# EAGLE schematic Interface v1_6 (EAGLE 7.7.0), part 1 of 2

## Sheet 1 of 14: Connectors
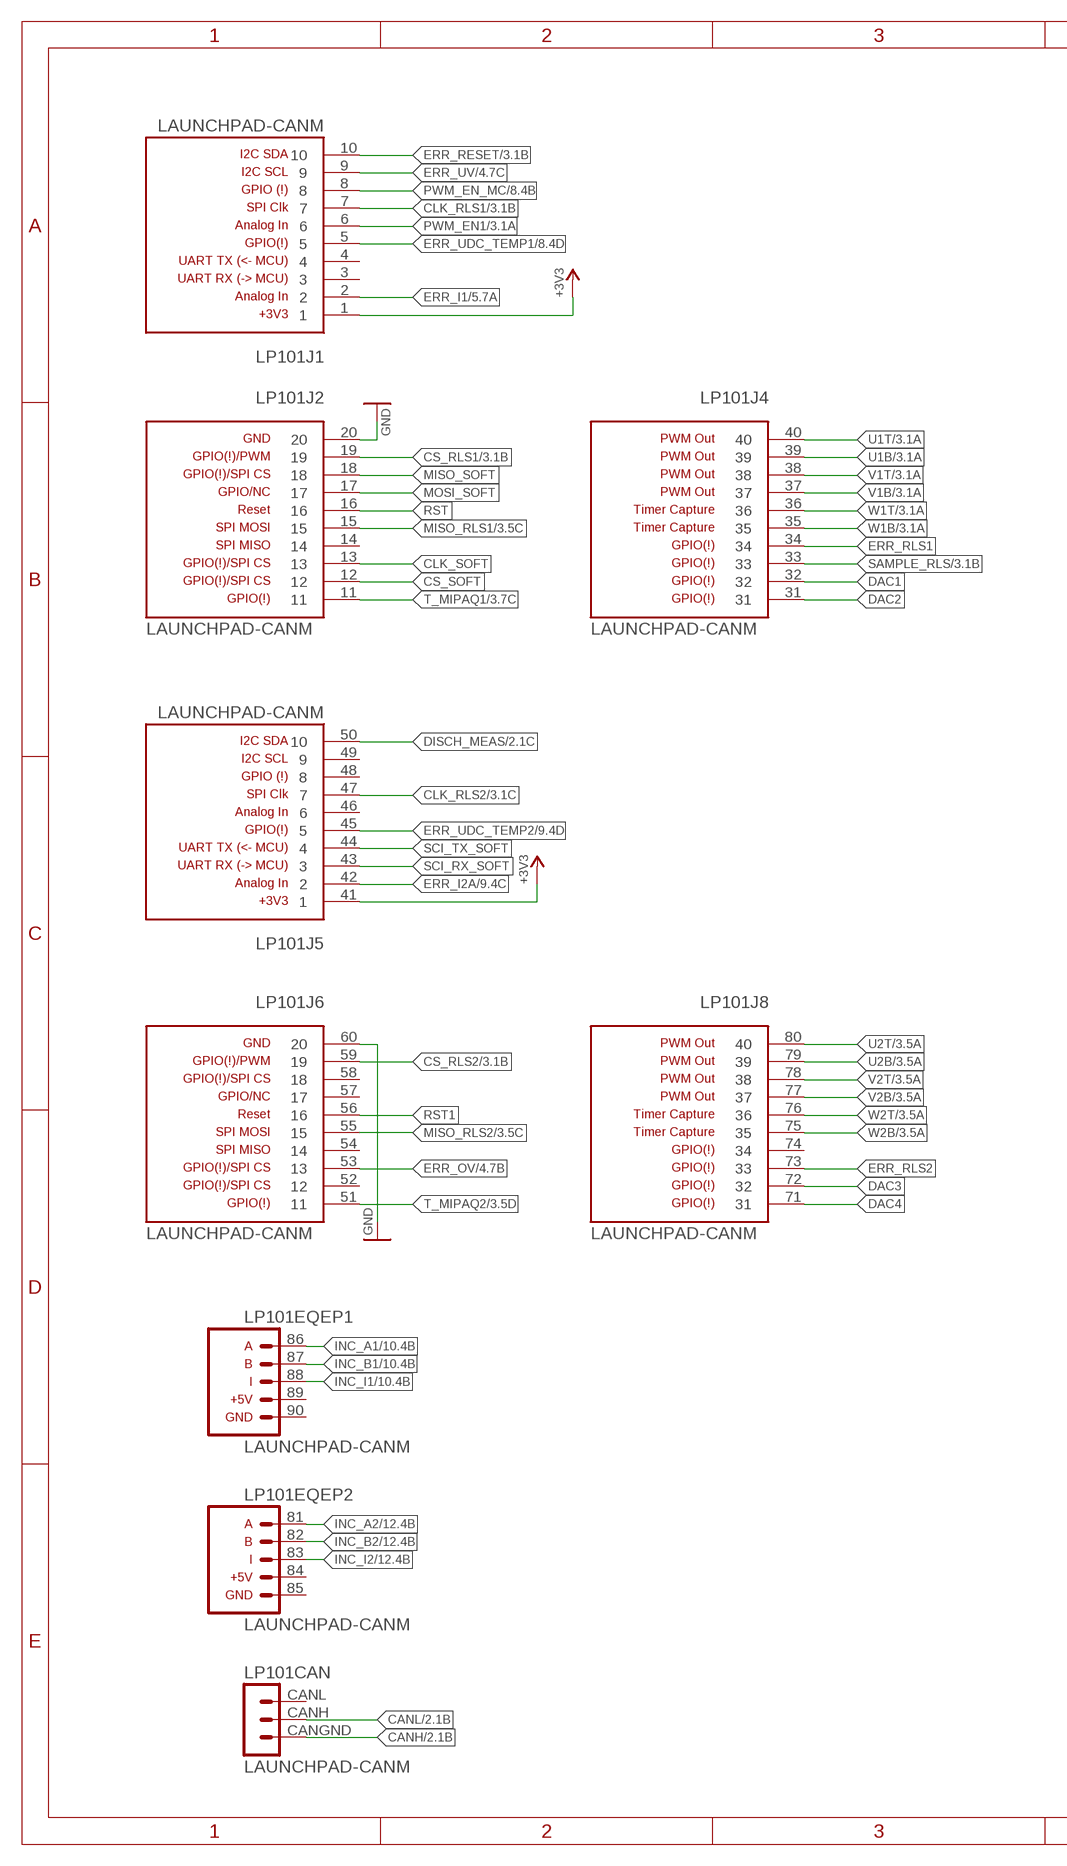
[diagram p0: schematic, sheet 1, part 1 of 2]
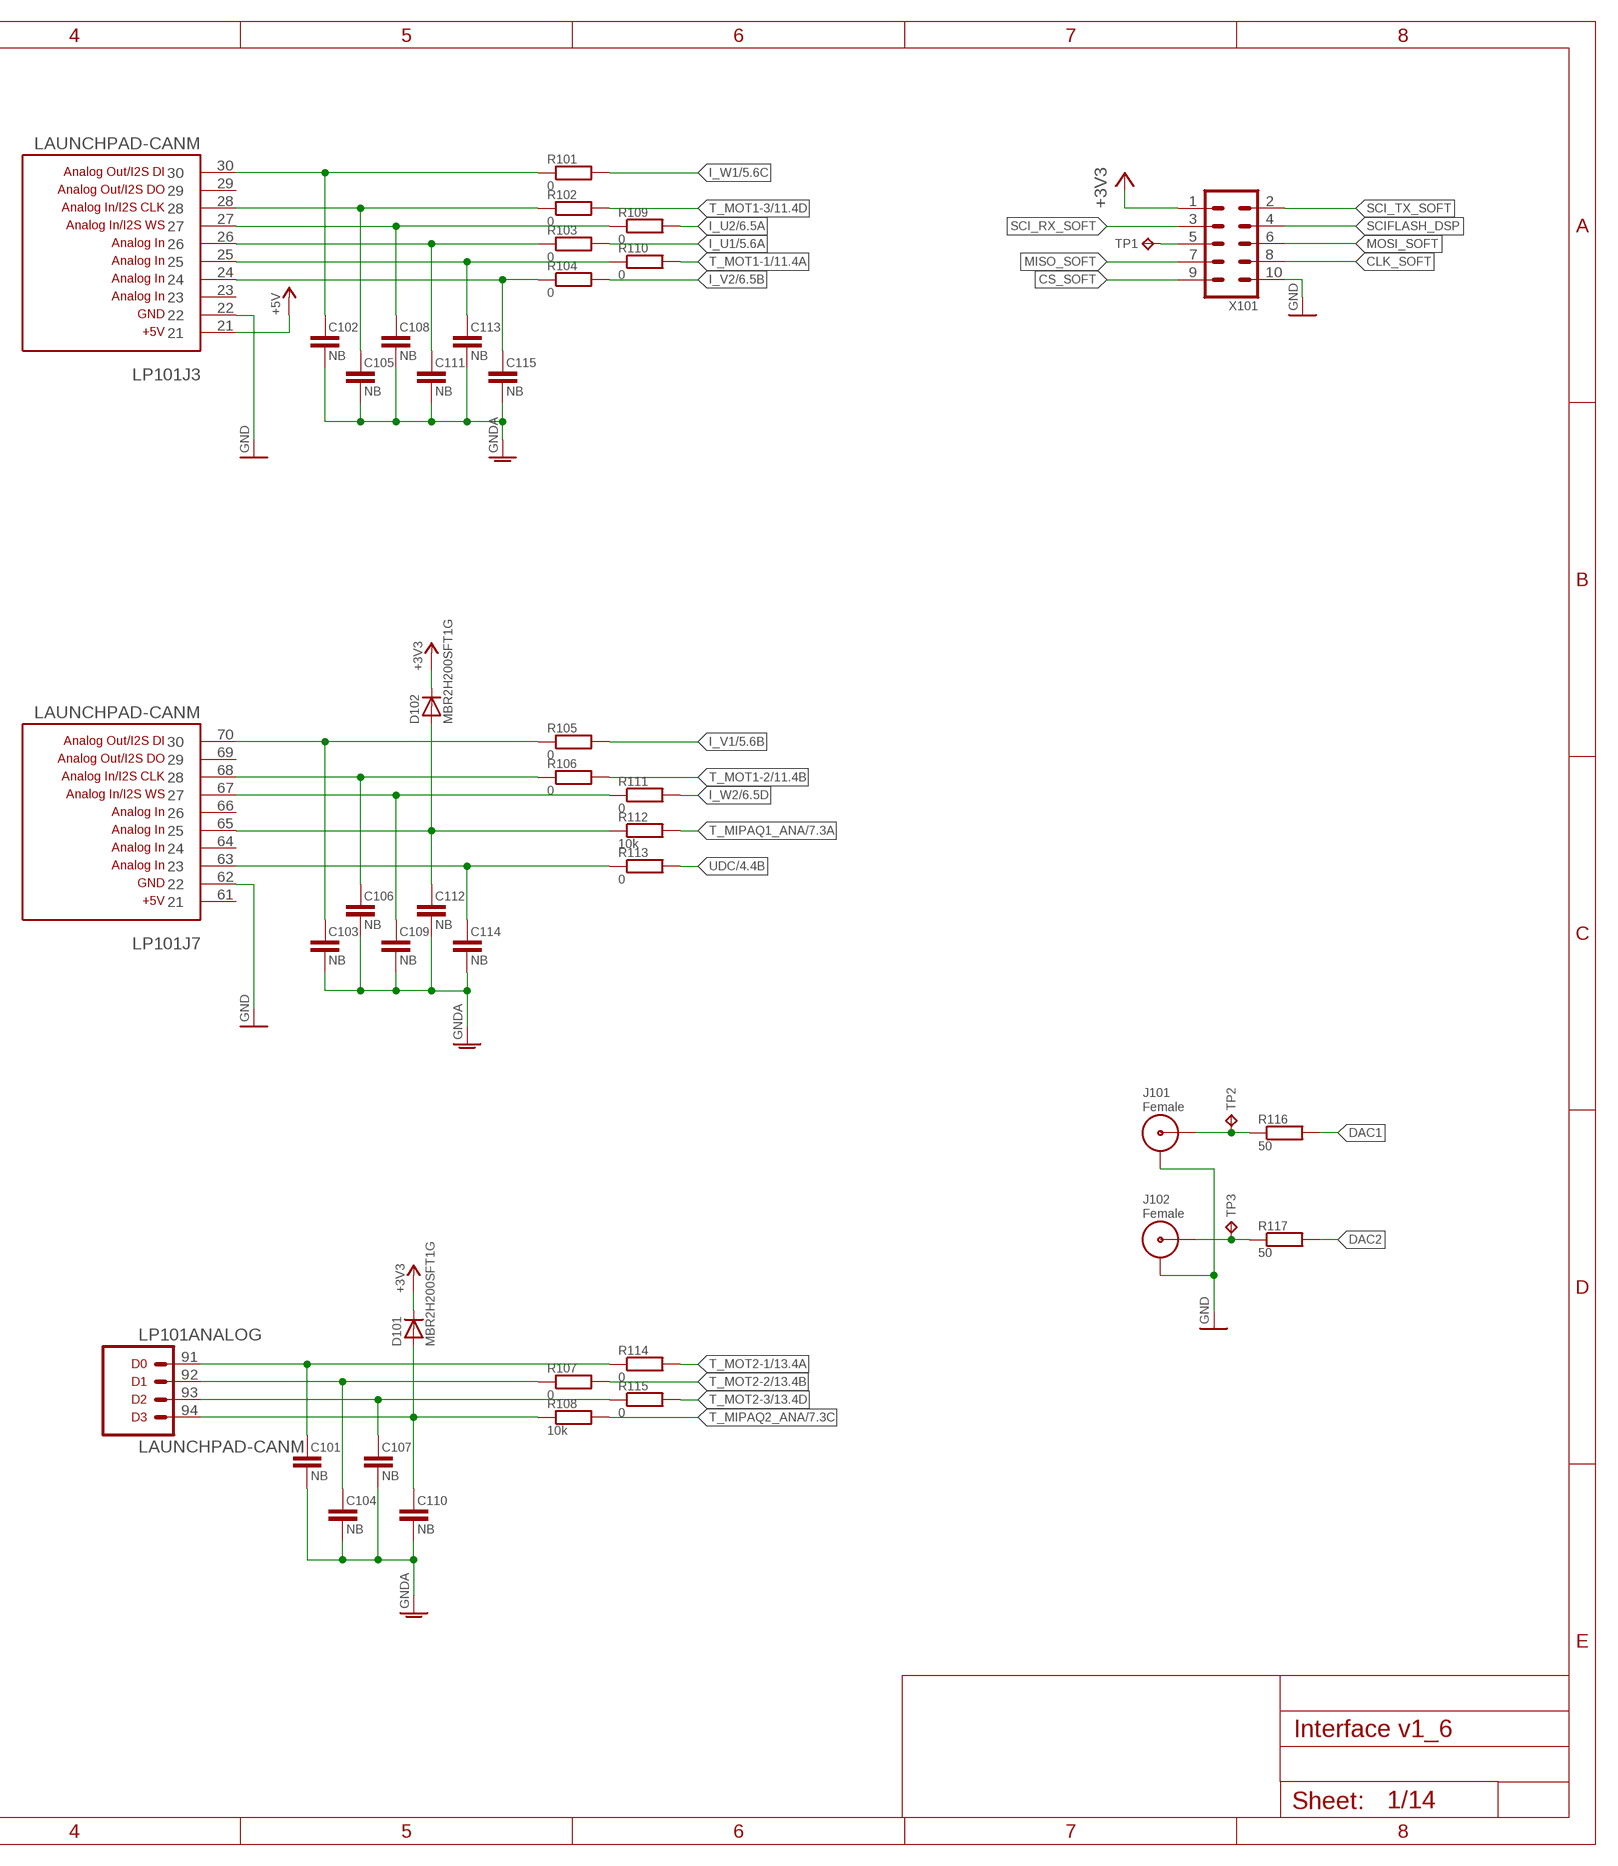
[diagram p1: schematic, sheet 1, part 2 of 2]

### Parts
C101  NB  C-0805"  [C-0805"]
C102  NB  C-0805"  [C-0805"]
C103  NB  C-0805"  [C-0805"]
C104  NB  C-0805"  [C-0805"]
C105  NB  C-0805"  [C-0805"]
C106  NB  C-0805"  [C-0805"]
C107  NB  C-0805"  [C-0805"]
C108  NB  C-0805"  [C-0805"]
C109  NB  C-0805"  [C-0805"]
C110  NB  C-0805"  [C-0805"]
C111  NB  C-0805"  [C-0805"]
C112  NB  C-0805"  [C-0805"]
C113  NB  C-0805"  [C-0805"]
C114  NB  C-0805"  [C-0805"]
C115  NB  C-0805"  [C-0805"]
D101  MBR2H200SFT1G  DIODE-0805"  [D-0805"]
D102  MBR2H200SFT1G  DIODE-0805"  [D-0805"]
J101  Female  SMAKL  [SMA_KLEIN]
J102  Female  SMAKL  [SMA_KLEIN]
LP101  LAUNCHPAD-CANM  [LAUNCHPAD_M]
R101  0  R-0805"  [R-0805"]
R102  0  R-0805"  [R-0805"]
R103  0  R-0805"  [R-0805"]
R104  0  R-0805"  [R-0805"]
R105  0  R-0805"  [R-0805"]
R106  0  R-0805"  [R-0805"]
R107  0  R-0805"  [R-0805"]
R108  10k  R-0805"  [R-0805"]
R109  0  R-0805"  [R-0805"]
R110  0  R-0805"  [R-0805"]
R111  0  R-0805"  [R-0805"]
R112  10k  R-0805"  [R-0805"]
R113  0  R-0805"  [R-0805"]
R114  0  R-0805"  [R-0805"]
R115  0  R-0805"  [R-0805"]
R116  50  R-0805"  [R-0805"]
R117  50  R-0805"  [R-0805"]
TP1  TP-TH-08  [TP-08]
TP2  TP-TH-12  [TP-12]
TP3  TP-TH-12  [TP-12]
X101  Softauge  C10-2-ML-2  [ML-2~10]

### Nets
+3V3 [VDD]: D101.C D102.C LP101.1 LP101.41 X101.1 ; also sheet 2,3,4,5,6,7,8,9,11,13
+5V [VDD]: LP101.21 ; also sheet 2,3,4,5,6,7,10,12,13
ADCIN15: C114.1 LP101.63 R113.1
ADCINA0: C102.1 LP101.30 R101.1
ADCINA1: C103.1 LP101.70 R105.1
ADCINA3: C111.1 LP101.26 R103.1
ADCINB2: C105.1 LP101.28 R102.1
ADCINB3: C113.1 LP101.25 R110.1
ADCINB4: C106.1 LP101.68 R106.1
ADCINB5: C112.1 D102.A LP101.65 R112.1
ADCINC2: C108.1 LP101.27 R109.1
ADCINC3: C115.1 LP101.24 R104.1
ADCIND0: C101.1 LP101.91(ANALOG:D0) R114.1
ADCIND1: C104.1 LP101.92(ANALOG:D1) R107.1
ADCIND2: C107.1 LP101.93(ANALOG:D2) R115.1
ADCIND3: C110.1 D101.A LP101.94(ANALOG:D3) R108.1
CANH: LP101.CANGND ; also sheet 2
CANL: LP101.CANH ; also sheet 2
CLK_RLS1: LP101.7 ; also sheet 3
CLK_RLS2: LP101.47 ; also sheet 3
CLK_SOFT: LP101.13 X101.8
CS_RLS1: LP101.19 ; also sheet 3
CS_RLS2: LP101.59 ; also sheet 3
CS_SOFT: LP101.12 X101.9
DAC1: LP101.32 R116.2
DAC2: LP101.31 R117.2
DAC3: LP101.72
DAC4: LP101.71
DISCH_MEAS: LP101.50 ; also sheet 2
ERR_I1: LP101.2 ; also sheet 5,8
ERR_I2A: LP101.42 ; also sheet 9
ERR_OV: LP101.53 ; also sheet 4,8,9
ERR_RESET: LP101.10 ; also sheet 3,4,5,6,7,11,13
ERR_RLS1: LP101.34
ERR_RLS2: LP101.73
ERR_UDC_TEMP1: LP101.5 ; also sheet 8
ERR_UDC_TEMP2: LP101.45 ; also sheet 9
ERR_UV: LP101.9 ; also sheet 4,8,9
GND: J101.1(GND) J101.3(GND) J101.4(GND) J101.5(GND) J102.1(GND) J102.3(GND) J102.4(GND) J102.5(GND) LP101.20 LP101.22 LP101.60 LP101.62 X101.10 ; also sheet 2,3,4,5,6,7,8,9,10,11,12,13,14
GNDA: C101.2 C102.2 C103.2 C104.2 C105.2 C106.2 C107.2 C108.2 C109.2 C110.2 C111.2 C112.2 C113.2 C114.2 C115.2 ; also sheet 2,4,5,6
I_U1: R103.2 ; also sheet 5
I_U2: R109.2 ; also sheet 6
I_V1: R105.2 ; also sheet 5
I_V2: R104.2 ; also sheet 6
I_W1: R101.2 ; also sheet 5
I_W2: R111.2 ; also sheet 6
INC_A1: LP101.86 ; also sheet 10
INC_A2: LP101.81 ; also sheet 12
INC_B1: LP101.87 ; also sheet 10
INC_B2: LP101.82 ; also sheet 12
INC_I1: LP101.88 ; also sheet 10
INC_I2: LP101.83 ; also sheet 12
MISO_RLS1: LP101.15 ; also sheet 3
MISO_RLS2: LP101.55 ; also sheet 3
MISO_SOFT: LP101.18 X101.7
MOSI_SOFT: LP101.17 X101.6
N$5: C109.1 LP101.67 R111.1
N$19: TP1.TP X101.5
N$64: J102.SIG R117.1 TP3.TP
N$86: J101.SIG R116.1 TP2.TP
PWM_EN1: LP101.6 ; also sheet 3,8
PWM_EN_MC: LP101.8 ; also sheet 8,9
RST: LP101.16
RST1: LP101.56
SAMPLE_RLS: LP101.33 ; also sheet 3
SCI_RX_SOFT: LP101.43 X101.3
SCI_TX_SOFT: LP101.44 X101.2
SCIFLASH_DSP: X101.4
T_MIPAQ1: LP101.11 ; also sheet 3
T_MIPAQ1_ANA: R112.2 ; also sheet 7
T_MIPAQ2: LP101.51 ; also sheet 3
T_MIPAQ2_ANA: R108.2 ; also sheet 7
T_MOT1-1: R110.2 ; also sheet 11
T_MOT1-2: R106.2 ; also sheet 11
T_MOT1-3: R102.2 ; also sheet 11
T_MOT2-1: R114.2 ; also sheet 13
T_MOT2-2: R107.2 ; also sheet 13
T_MOT2-3: R115.2 ; also sheet 13
U1B: LP101.39 ; also sheet 3
U1T: LP101.40 ; also sheet 3
U2B: LP101.79 ; also sheet 3
U2T: LP101.80 ; also sheet 3
UDC: R113.2 ; also sheet 4
V1B: LP101.37 ; also sheet 3
V1T: LP101.38 ; also sheet 3
V2B: LP101.77 ; also sheet 3
V2T: LP101.78 ; also sheet 3
W1B: LP101.35 ; also sheet 3
W1T: LP101.36 ; also sheet 3
W2B: LP101.75 ; also sheet 3
W2T: LP101.76 ; also sheet 3
Unconnected: LP101.3 LP101.4 LP101.14 LP101.23 LP101.29 LP101.46 LP101.48 LP101.49 LP101.52 LP101.54 LP101.57 LP101.58 LP101.61 LP101.64 LP101.66 LP101.69 LP101.74 LP101.84 LP101.85 LP101.89 LP101.90 LP101.CANL

## Sheet 2 of 14: PS
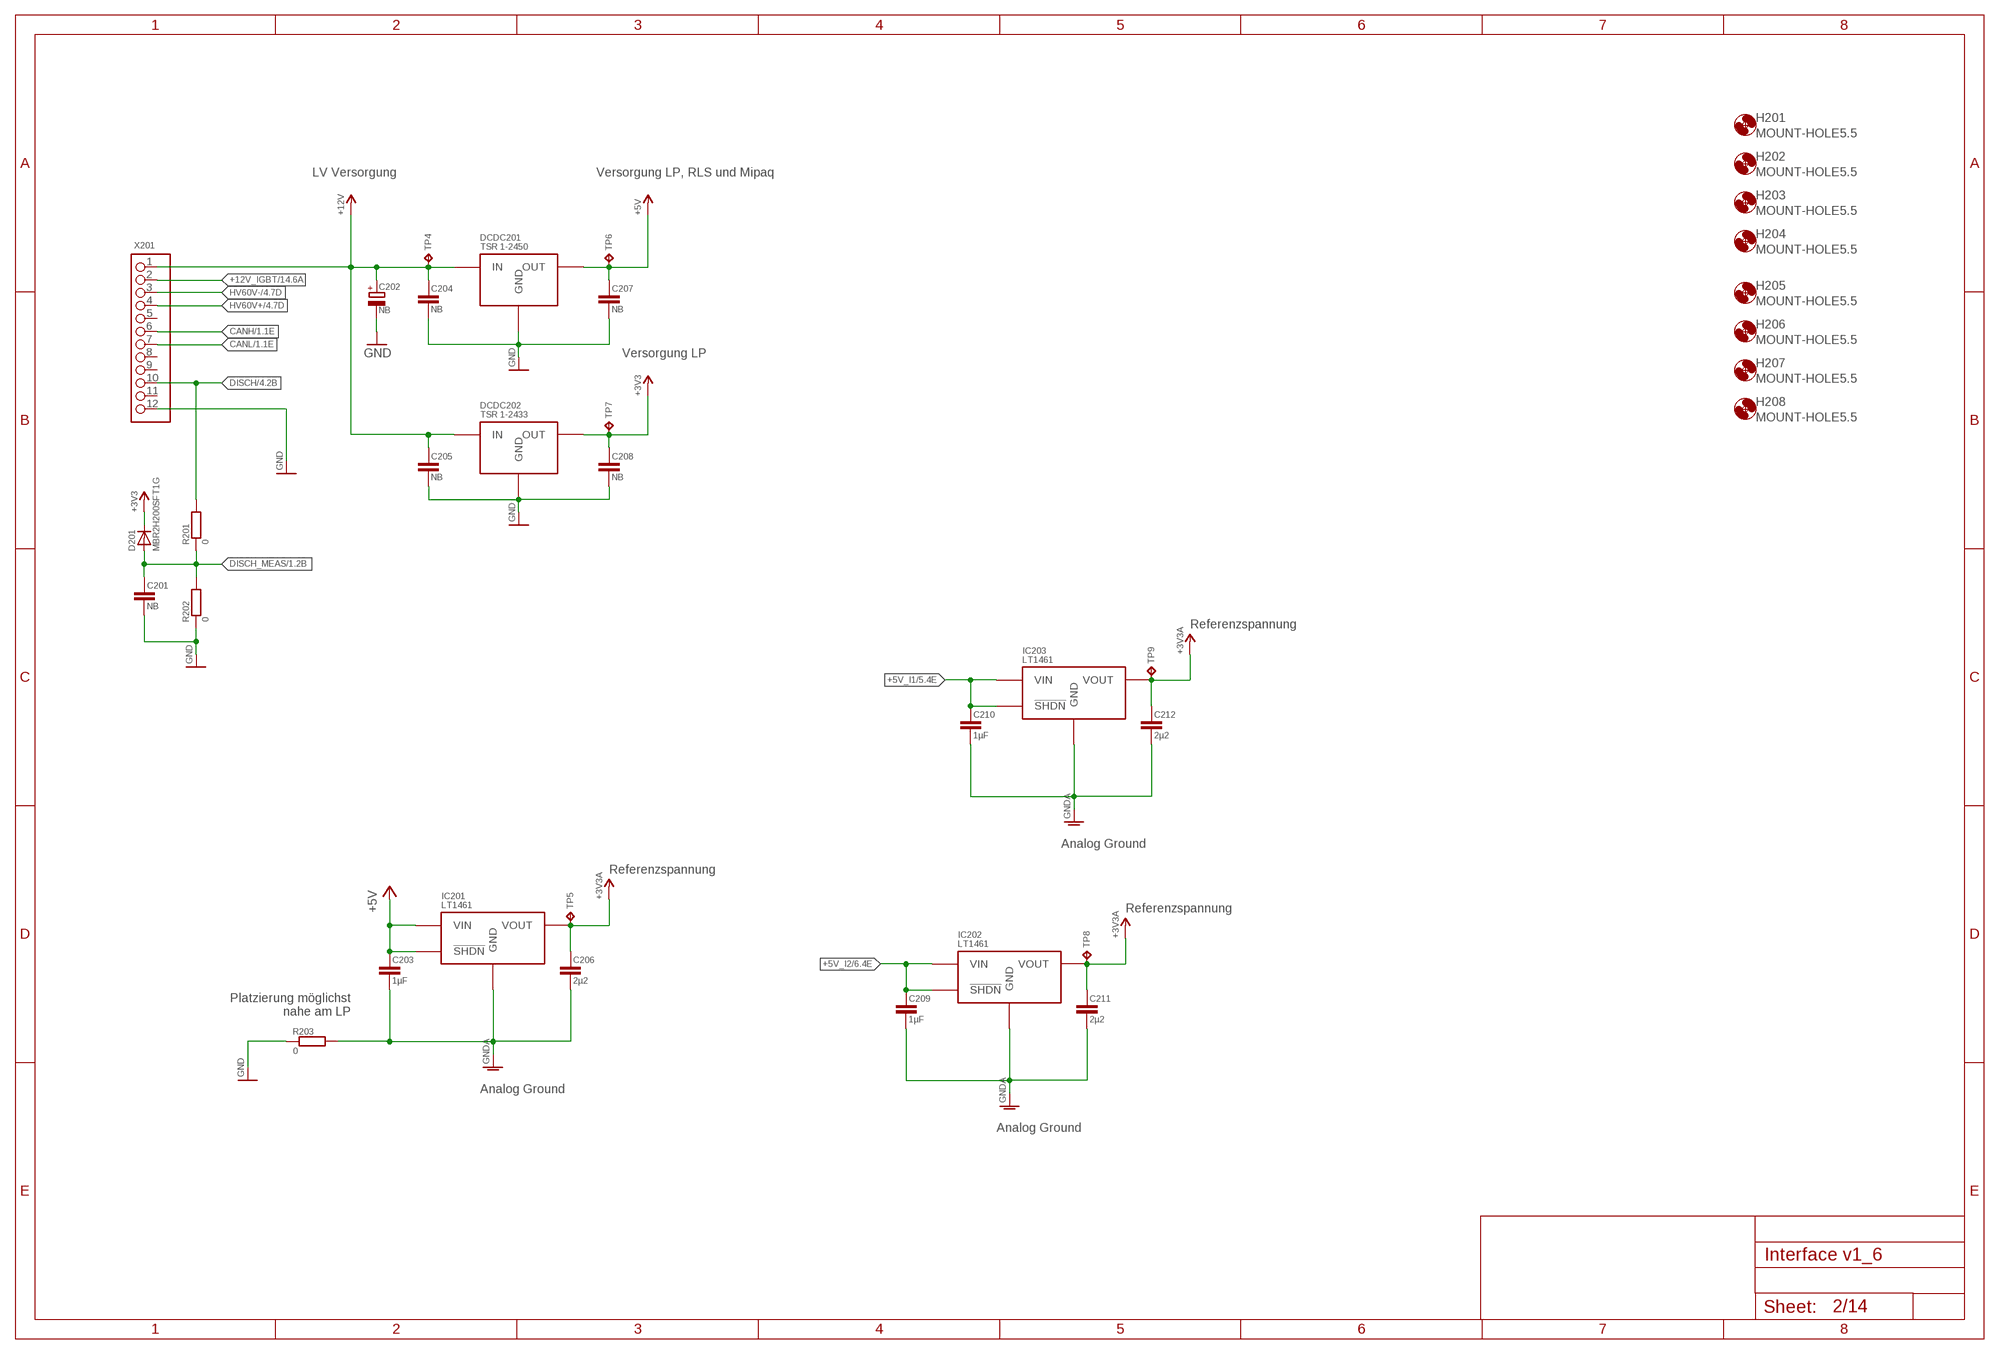
[diagram p2: schematic, sheet 2]

### Parts
C201  NB  C-0805"  [C-0805"]
C202  NB  C-POL-1210"  [CP-1210"]
C203  1µF  C-0805"  [C-0805"]
C204  NB  C-0805"  [C-0805"]
C205  NB  C-0805"  [C-0805"]
C206  2µ2  C-0805"  [C-0805"]
C207  NB  C-0805"  [C-0805"]
C208  NB  C-0805"  [C-0805"]
C209  1µF  C-0805"  [C-0805"]
C210  1µF  C-0805"  [C-0805"]
C211  2µ2  C-0805"  [C-0805"]
C212  2µ2  C-0805"  [C-0805"]
D201  MBR2H200SFT1G  DIODE-0805"  [D-0805"]
DCDC201  TSR 1-2450  TRS1  [TSR-1]
DCDC202  TSR 1-2433  TRS1  [TSR-1]
H201  MOUNT-HOLE5.5  [5,5]
H202  MOUNT-HOLE5.5  [5,5]
H203  MOUNT-HOLE5.5  [5,5]
H204  MOUNT-HOLE5.5  [5,5]
H205  MOUNT-HOLE5.5  [5,5]
H206  MOUNT-HOLE5.5  [5,5]
H207  MOUNT-HOLE5.5  [5,5]
H208  MOUNT-HOLE5.5  [5,5]
IC201  LT1461  [SO8]
IC202  LT1461  [SO8]
IC203  LT1461  [SO8]
R201  0  R-0805"  [R-0805"]
R202  0  R-0805"  [R-0805"]
R203  0  R-0805"  [R-0805"]
TP4  TP-TH-12  [TP-12]
TP5  TP-TH-12  [TP-12]
TP6  TP-TH-12  [TP-12]
TP7  TP-TH-12  [TP-12]
TP8  TP-TH-12  [TP-12]
TP9  TP-TH-12  [TP-12]
X201  MINIBRIDGE12-GERADE  [MINIBRIDGE12-GERADE]

### Nets
+3V3 [VDD]: C208.1 D201.C DCDC202.3(OUT) TP7.TP ; also sheet 1,3,4,5,6,7,8,9,11,13
+3V3A [VDD]: C206.1 IC201.6(VOUT) TP5.TP ; also sheet 4
+3V3A_I1 [VDD]: C212.1 IC203.6(VOUT) TP9.TP ; supply symbol labelled +3V3A ; also sheet 5
+3V3A_I2 [VDD]: C211.1 IC202.6(VOUT) TP8.TP ; supply symbol labelled +3V3A ; also sheet 6
+5V [VDD]: C203.1 C207.1 DCDC201.3(OUT) IC201.2(VIN) IC201.3(!SHDN) TP6.TP ; also sheet 1,3,4,5,6,7,10,12,13
+5V_I1 [VDD]: C210.1 IC203.2(VIN) IC203.3(!SHDN) ; also sheet 5
+5V_I2 [VDD]: C209.1 IC202.2(VIN) IC202.3(!SHDN) ; also sheet 6
+12V [VDD]: C202.+ C204.1 C205.1 DCDC201.1(IN) DCDC202.1(IN) TP4.TP X201.1 ; also sheet 4,10,12
+12V_IGBT [VDD]: X201.2 ; also sheet 14
CANH: X201.6 ; also sheet 1
CANL: X201.7 ; also sheet 1
DISCH: R201.2 X201.10 ; also sheet 4
DISCH_MEAS: C201.1 D201.A R201.1 R202.2 ; also sheet 1
GND: C201.2 C202.- C204.2 C205.2 C207.2 C208.2 DCDC201.2(GND) DCDC202.2(GND) R202.1 R203.1 X201.12 ; also sheet 1,3,4,5,6,7,8,9,10,11,12,13,14
GNDA: C203.2 C206.2 C209.2 C210.2 C211.2 C212.2 IC201.4(GND) IC202.4(GND) IC203.4(GND) R203.2 ; also sheet 1,4,5,6
HV60V+: X201.4 ; also sheet 4
HV60V-: X201.3 ; also sheet 4
Unconnected: X201.5 X201.8 X201.9 X201.11

### Notes on the sheet
- LV Versorgung | Versorgung LP, RLS und Mipaq
- Versorgung LP
- Referenzspannung
- Analog Ground
- Referenzspannung
- Referenzspannung
- Platzierung möglichst
  nahe am LP
- Analog Ground
- Analog Ground

## Sheet 3 of 14: Level Shift Motor
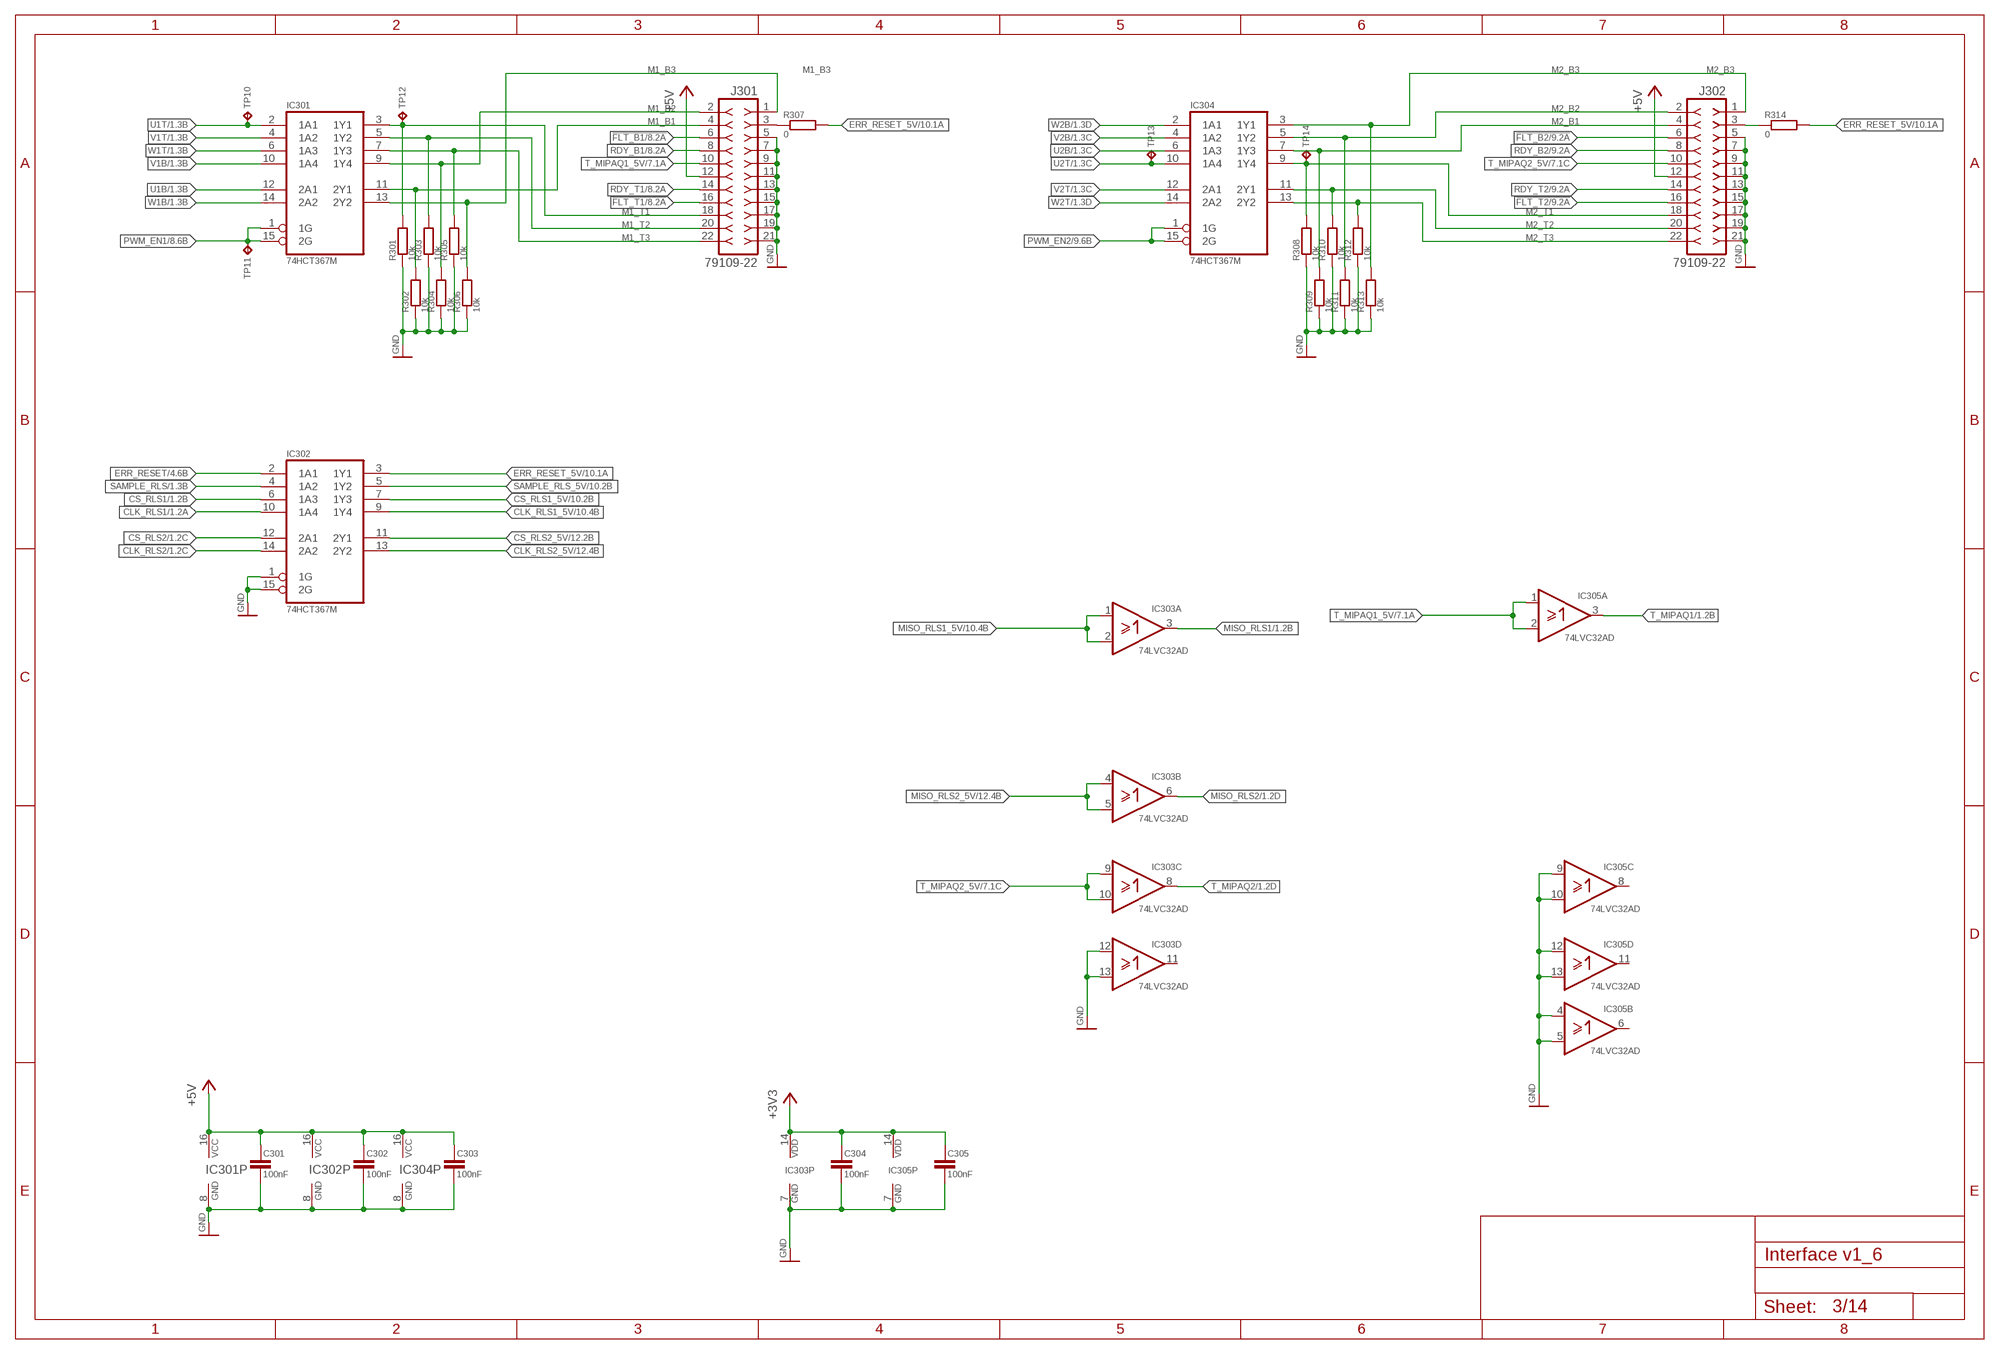
[diagram p3: schematic, sheet 3]

### Parts
C301  100nF  C-0805"  [C-0805"]
C302  100nF  C-0805"  [C-0805"]
C303  100nF  C-0805"  [C-0805"]
C304  100nF  C-0805"  [C-0805"]
C305  100nF  C-0805"  [C-0805"]
IC301  74HCT367M  74367D  [SOIC16]
IC302  74HCT367M  74367D  [SOIC16]
IC303  74LVC32AD  [SOIC14]
IC304  74HCT367M  74367D  [SOIC16]
IC305  74LVC32AD  [SOIC14]
J301  79109-22  [79109-22]
J302  79109-22  [79109-22]
R301  10k  R-0805"  [R-0805"]
R302  10k  R-0805"  [R-0805"]
R303  10k  R-0805"  [R-0805"]
R304  10k  R-0805"  [R-0805"]
R305  10k  R-0805"  [R-0805"]
R306  10k  R-0805"  [R-0805"]
R307  0  R-0805"  [R-0805"]
R308  10k  R-0805"  [R-0805"]
R309  10k  R-0805"  [R-0805"]
R310  10k  R-0805"  [R-0805"]
R311  10k  R-0805"  [R-0805"]
R312  10k  R-0805"  [R-0805"]
R313  10k  R-0805"  [R-0805"]
R314  0  R-0805"  [R-0805"]
TP10  TP-TH-08  [TP-08]
TP11  TP-TH-08  [TP-08]
TP12  TP-TH-08  [TP-08]
TP13  TP-TH-08  [TP-08]
TP14  TP-TH-08  [TP-08]

### Nets
!FLT_B1: J301.6 ; also sheet 8
!FLT_B2: J302.6 ; also sheet 9
!FLT_T1: J301.16 ; also sheet 8
!FLT_T2: J302.16 ; also sheet 9
+3V3 [VDD]: C304.1 C305.1 IC303.14(P:VDD) IC305.14(P:VDD) ; also sheet 1,2,4,5,6,7,8,9,11,13
+5V [VDD]: C301.1 C302.1 C303.1 IC301.16(VCC) IC302.16(VCC) IC304.16(VCC) J301.12 J302.12 ; also sheet 1,2,4,5,6,7,10,12,13
CLK_RLS1: IC302.10(1A4) ; also sheet 1
CLK_RLS1_5V: IC302.9(1Y4) ; also sheet 10
CLK_RLS2: IC302.14(2A2) ; also sheet 1
CLK_RLS2_5V: IC302.13(2Y2) ; also sheet 12
CS_RLS1: IC302.6(1A3) ; also sheet 1
CS_RLS1_5V: IC302.7(1Y3) ; also sheet 10
CS_RLS2: IC302.12(2A1) ; also sheet 1
CS_RLS2_5V: IC302.11(2Y1) ; also sheet 12
ERR_RESET: IC302.2(1A1) ; also sheet 1,4,5,6,7,11,13
ERR_RESET_5V: IC302.3(1Y1) R307.2 R314.2 ; also sheet 10,12
GND: C301.2 C302.2 C303.2 C304.2 C305.2 IC301.8(GND) IC302.1(1G) IC302.8(GND) IC302.15(2G) IC303.7(P:GND) IC303.12(D:A) IC303.13(D:B) IC304.8(GND) IC305.4(B:A) IC305.5(B:B) IC305.7(P:GND) IC305.9(C:A) IC305.10(C:B) IC305.12(D:A) IC305.13(D:B) J301.5 J301.7 J301.9 J301.11 J301.13 J301.15 J301.17 J301.19 J301.21 J302.5 J302.7 J302.9 J302.11 J302.13 J302.15 J302.17 J302.19 J302.21 R301.1 R302.1 R303.1 R304.1 R305.1 R306.1 R308.1 R309.1 R310.1 R311.1 R312.1 R313.1 ; also sheet 1,2,4,5,6,7,8,9,10,11,12,13,14
M1_B1: IC301.11(2Y1) J301.4 R302.2
M1_B2: IC301.9(1Y4) J301.2 R304.2
M1_B3: IC301.13(2Y2) J301.1 R306.2
M1_T1: IC301.3(1Y1) J301.18 R301.2 TP12.TP
M1_T2: IC301.5(1Y2) J301.20 R303.2
M1_T3: IC301.7(1Y3) J301.22 R305.2
M2_B1: IC304.7(1Y3) J302.4 R309.2
M2_B2: IC304.5(1Y2) J302.2 R311.2
M2_B3: IC304.3(1Y1) J302.1 R313.2
M2_T1: IC304.9(1Y4) J302.18 R308.2 TP14.TP
M2_T2: IC304.11(2Y1) J302.20 R310.2
M2_T3: IC304.13(2Y2) J302.22 R312.2
MISO_RLS1: IC303.3(A:Y) ; also sheet 1
MISO_RLS1_5V: IC303.1(A:A) IC303.2(A:B) ; also sheet 10
MISO_RLS2: IC303.6(B:Y) ; also sheet 1
MISO_RLS2_5V: IC303.4(B:A) IC303.5(B:B) ; also sheet 12
N$25: J301.3 R307.1
N$184: J302.3 R314.1
PWM_EN1: IC301.1(1G) IC301.15(2G) TP11.TP ; also sheet 1,8
PWM_EN2: IC304.1(1G) IC304.15(2G) ; also sheet 9
RDY_B1: J301.8 ; also sheet 8
RDY_B2: J302.8 ; also sheet 9
RDY_T1: J301.14 ; also sheet 8
RDY_T2: J302.14 ; also sheet 9
SAMPLE_RLS: IC302.4(1A2) ; also sheet 1
SAMPLE_RLS_5V: IC302.5(1Y2) ; also sheet 10,12
T_MIPAQ1: IC305.3(A:Y) ; also sheet 1
T_MIPAQ1_5V: IC305.1(A:A) IC305.2(A:B) J301.10 ; also sheet 7
T_MIPAQ2: IC303.8(C:Y) ; also sheet 1
T_MIPAQ2_5V: IC303.9(C:A) IC303.10(C:B) J302.10 ; also sheet 7
U1B: IC301.12(2A1) ; also sheet 1
U1T: IC301.2(1A1) TP10.TP ; also sheet 1
U2B: IC304.6(1A3) ; also sheet 1
U2T: IC304.10(1A4) TP13.TP ; also sheet 1
V1B: IC301.10(1A4) ; also sheet 1
V1T: IC301.4(1A2) ; also sheet 1
V2B: IC304.4(1A2) ; also sheet 1
V2T: IC304.12(2A1) ; also sheet 1
W1B: IC301.14(2A2) ; also sheet 1
W1T: IC301.6(1A3) ; also sheet 1
W2B: IC304.2(1A1) ; also sheet 1
W2T: IC304.14(2A2) ; also sheet 1
Unconnected: IC303.11(D:Y) IC305.6(B:Y) IC305.8(C:Y) IC305.11(D:Y)

## Sheet 4 of 14: UDC
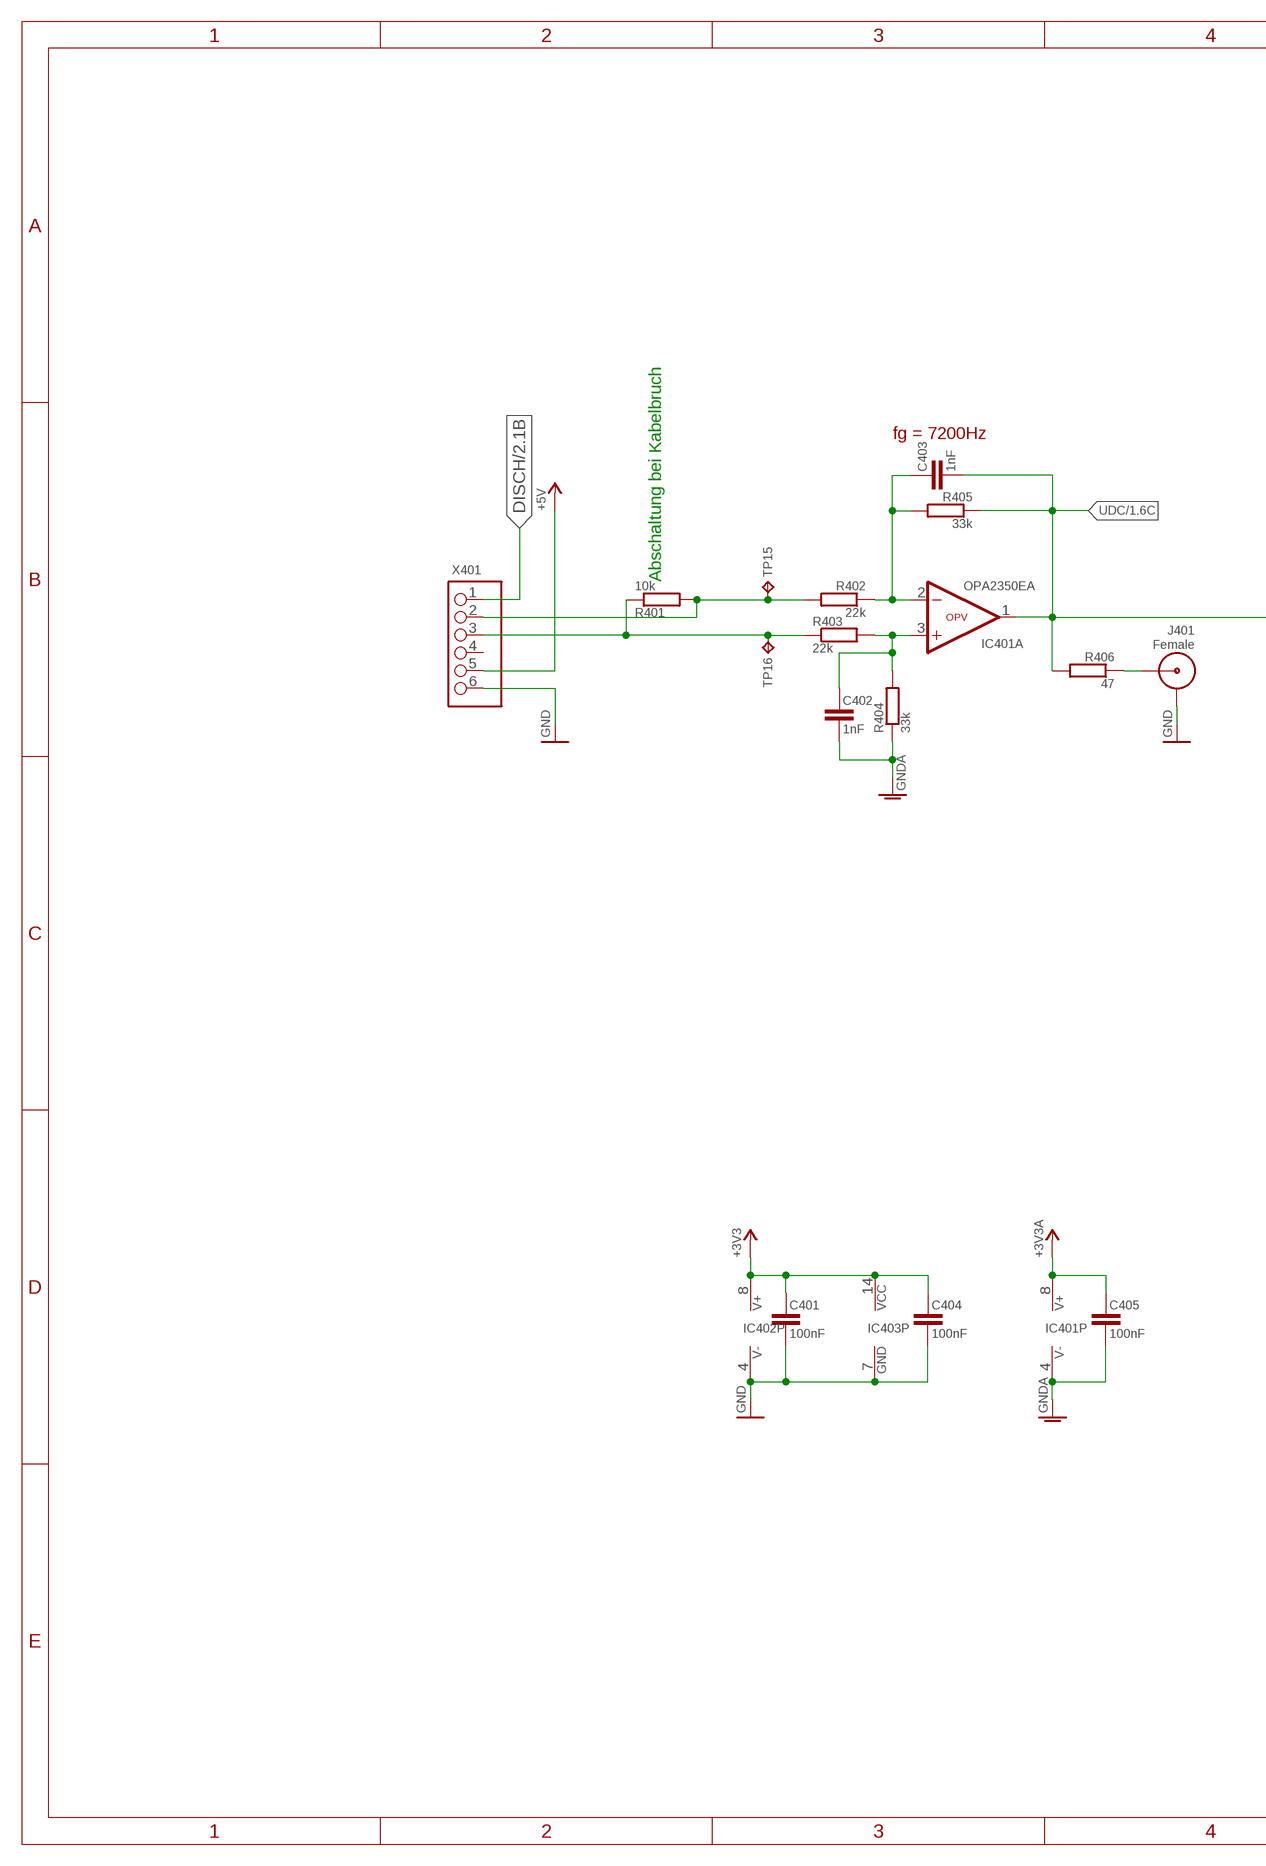
[diagram p4: schematic, sheet 4, part 1 of 2]
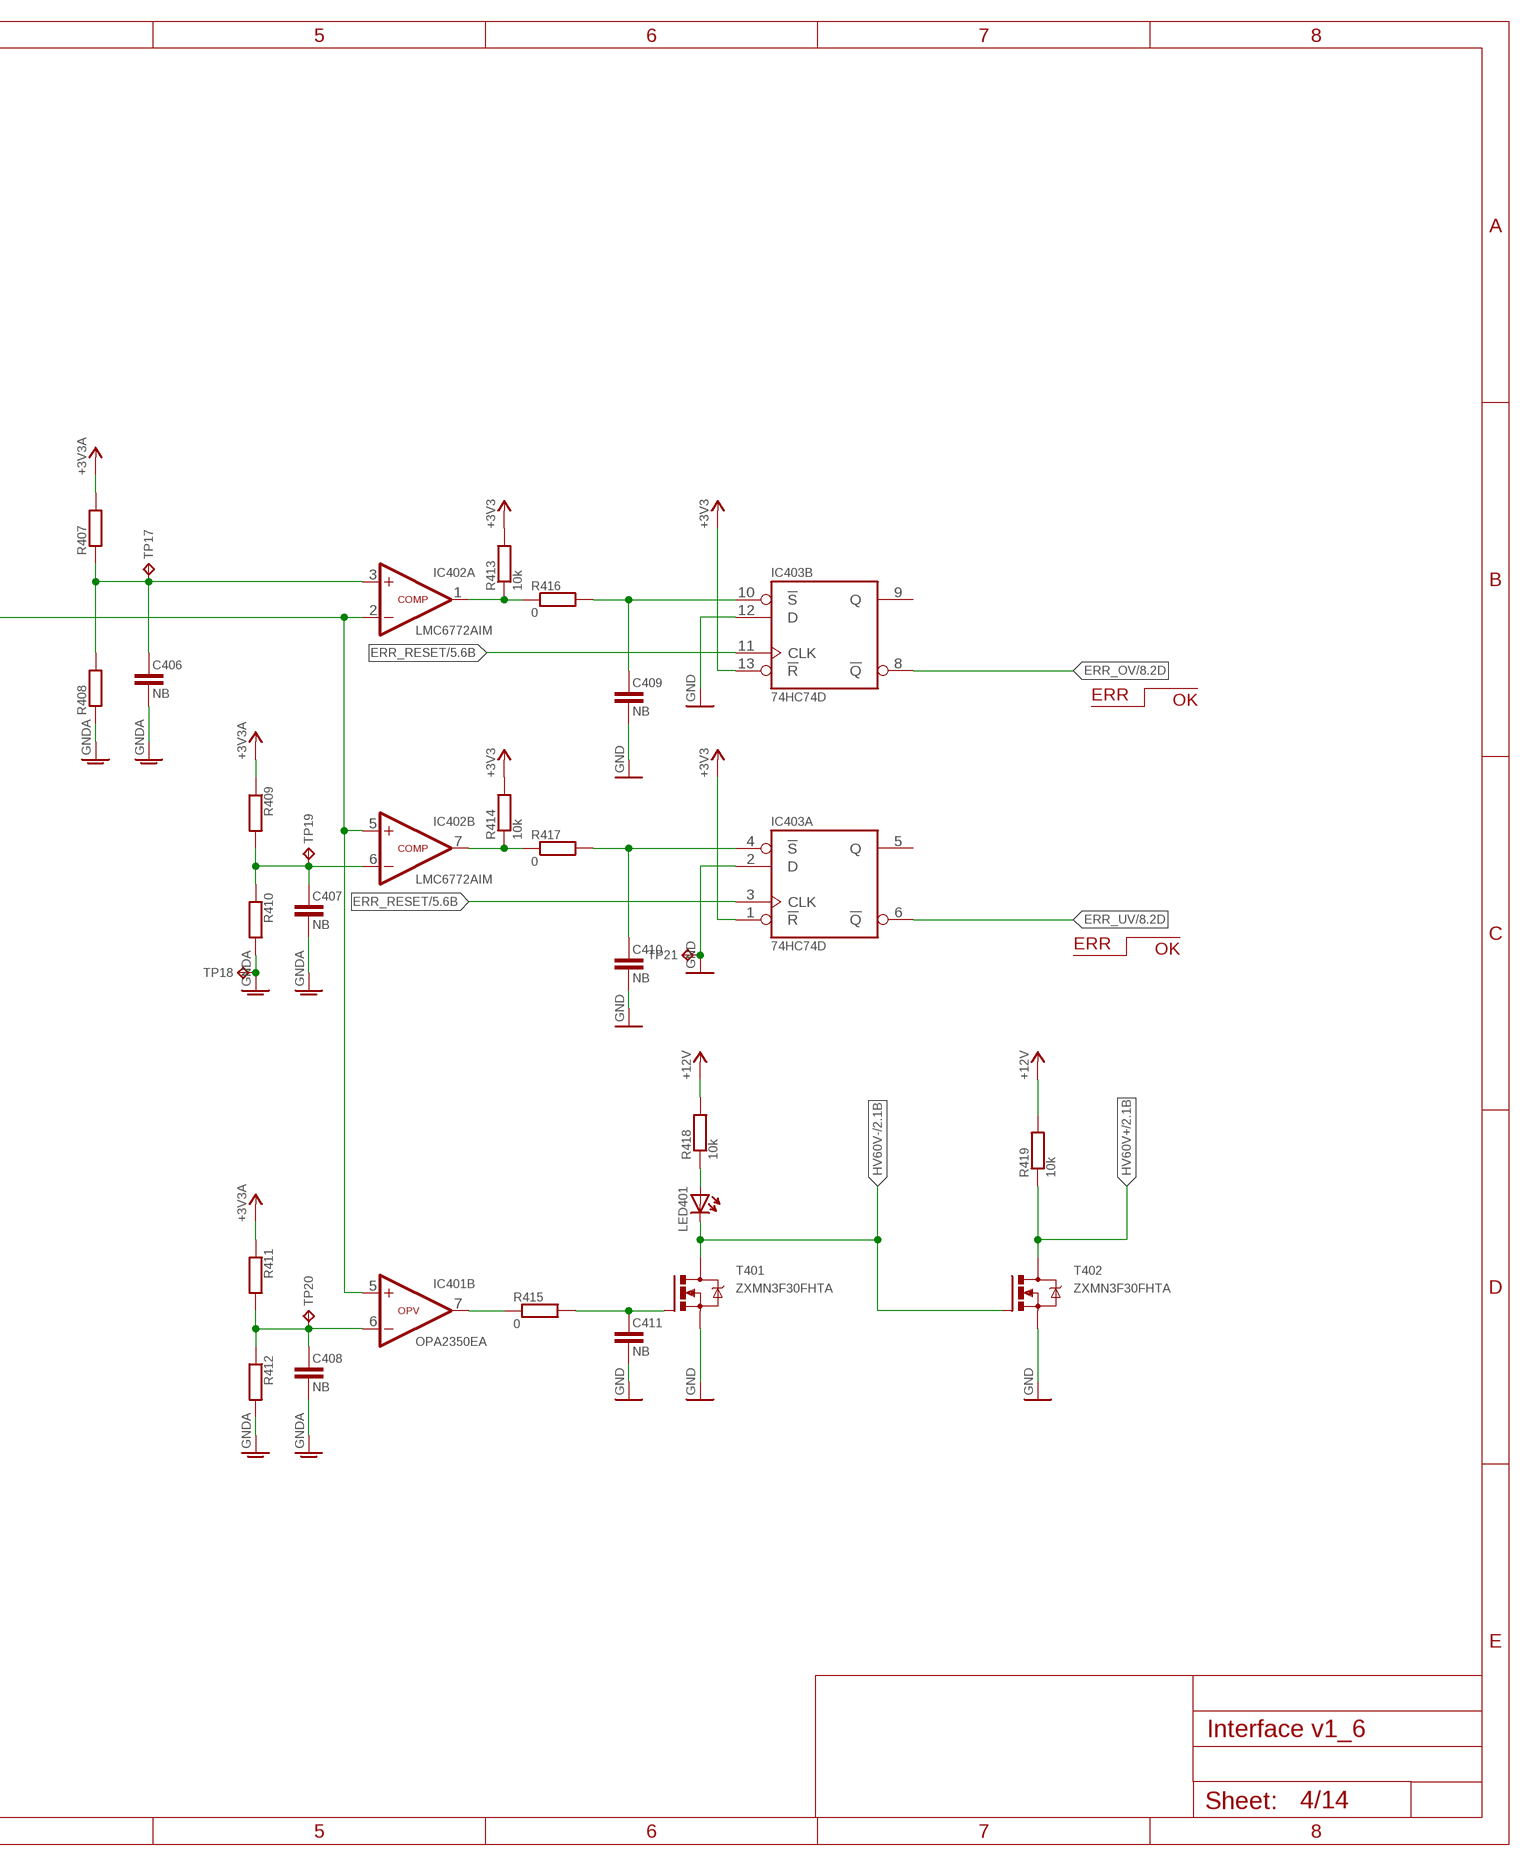
[diagram p5: schematic, sheet 4, part 2 of 2]

### Parts
C401  100nF  C-0805"  [C-0805"]
C402  1nF  C-0805"  [C-0805"]
C403  1nF  C-0805"  [C-0805"]
C404  100nF  C-0805"  [C-0805"]
C405  100nF  C-0805"  [C-0805"]
C406  NB  C-0805"  [C-0805"]
C407  NB  C-0805"  [C-0805"]
C408  NB  C-0805"  [C-0805"]
C409  NB  C-0805"  [C-0805"]
C410  NB  C-0805"  [C-0805"]
C411  NB  C-0805"  [C-0805"]
IC401  OPA2350EA  OPV-2-SOIC  [SOIC8]
IC402  LMC6772AIM  COMP-OC-2-SOIC  [SOIC8]
IC403  74HC74D  [SOIC14]
J401  Female  SMAKL  [SMA_KLEIN]
LED401  LED-0805"  [LED-0805"]
R401  10k  R-0805"  [R-0805"]
R402  22k  R-0805"  [R-0805"]
R403  22k  R-0805"  [R-0805"]
R404  33k  R-0805"  [R-0805"]
R405  33k  R-0805"  [R-0805"]
R406  47  R-0805"  [R-0805"]
R407  R-0805"  [R-0805"]
R408  R-0805"  [R-0805"]
R409  R-0805"  [R-0805"]
R410  R-0805"  [R-0805"]
R411  R-0805"  [R-0805"]
R412  R-0805"  [R-0805"]
R413  10k  R-0805"  [R-0805"]
R414  10k  R-0805"  [R-0805"]
R415  0  R-0805"  [R-0805"]
R416  0  R-0805"  [R-0805"]
R417  0  R-0805"  [R-0805"]
R418  10k  R-0805"  [R-0805"]
R419  10k  R-0805"  [R-0805"]
T401  ZXMN3F30FHTA  MMBF170LT1  [SOT23]
T402  ZXMN3F30FHTA  MMBF170LT1  [SOT23]
TP15  TP-TH-08  [TP-08]
TP16  TP-TH-08  [TP-08]
TP17  TP-TH-08  [TP-08]
TP18  TP-TH-12  [TP-12]
TP19  TP-TH-08  [TP-08]
TP20  TP-TH-08  [TP-08]
TP21  TP-TH-08  [TP-08]
X401  UDC_Messung  MINIBRIDGE6-ABGEWINKELT  [MINIBRIDGE6-ABGEWINKELT]

### Nets
+3V3 [VDD]: C401.1 C404.1 IC402.8(P:V+) IC403.1(A:!R) IC403.13(B:!R) IC403.14(P:VCC) R413.2 R414.2 ; also sheet 1,2,3,5,6,7,8,9,11,13
+3V3A [VDD]: C405.1 IC401.8(P:V+) R407.2 R409.1 R411.1 ; also sheet 2
+5V [VDD]: X401.5 ; also sheet 1,2,3,5,6,7,10,12,13
+12V [VDD]: R418.2 R419.2 ; also sheet 2,10,12
DISCH: X401.1 ; also sheet 2
ERR_OV: IC403.8(B:!Q) ; also sheet 1,8,9
ERR_RESET: IC403.3(A:CLK) IC403.11(B:CLK) ; also sheet 1,3,5,6,7,11,13
ERR_UV: IC403.6(A:!Q) ; also sheet 1,8,9
GND: C401.2 C404.2 C409.2 C410.2 C411.2 IC402.4(P:V-) IC403.2(A:D) IC403.7(P:GND) IC403.12(B:D) J401.1(GND) J401.3(GND) J401.4(GND) J401.5(GND) T401.2(S) T402.2(S) TP21.TP X401.6 ; also sheet 1,2,3,5,6,7,8,9,10,11,12,13,14
GNDA: C402.2 C405.2 C406.2 C407.2 C408.2 IC401.4(P:V-) R404.1 R408.1 R410.2 R412.2 TP18.TP ; also sheet 1,2,5,6
HV60V+: R419.1 T402.3(D) ; also sheet 2
HV60V-: LED401.C T401.3(D) T402.1(G) ; also sheet 2
N$2: LED401.A R418.1
N$15: J401.SIG R406.1
N$53: C403.1 IC401.2(A:-IN) R402.1 R405.2
N$54: C402.1 IC401.3(A:+IN) R403.2 R404.2
N$90: IC402.7(B:OUT) R414.1 R417.1
N$92: IC402.1(A:OUT) R413.1 R416.1
N$133: C410.1 IC403.4(A:!S) R417.2
N$134: C409.1 IC403.10(B:!S) R416.2
N$136: C406.1 IC402.3(A:+IN) R407.1 R408.2 TP17.TP
N$138: C407.1 IC402.6(B:-IN) R409.2 R410.1 TP19.TP
N$201: C408.1 IC401.6(B:-IN) R411.2 R412.1 TP20.TP
N$202: IC401.7(B:OUT) R415.1
N$203: C411.1 R415.2 T401.1(G)
UDC: C403.2 IC401.1(A:OUT) IC401.5(B:+IN) IC402.2(A:-IN) IC402.5(B:+IN) R405.1 R406.2 ; also sheet 1
VDC+: R401.1 R403.1 TP16.TP X401.3
VDC-: R401.2 R402.2 TP15.TP X401.2
Unconnected: IC403.5(A:Q) IC403.9(B:Q) X401.4

### Notes on the sheet
- fg = 7200Hz
- Abschaltung bei Kabelbruch
- ERR
- OK
- ERR
- OK

## Sheet 5 of 14: I M1
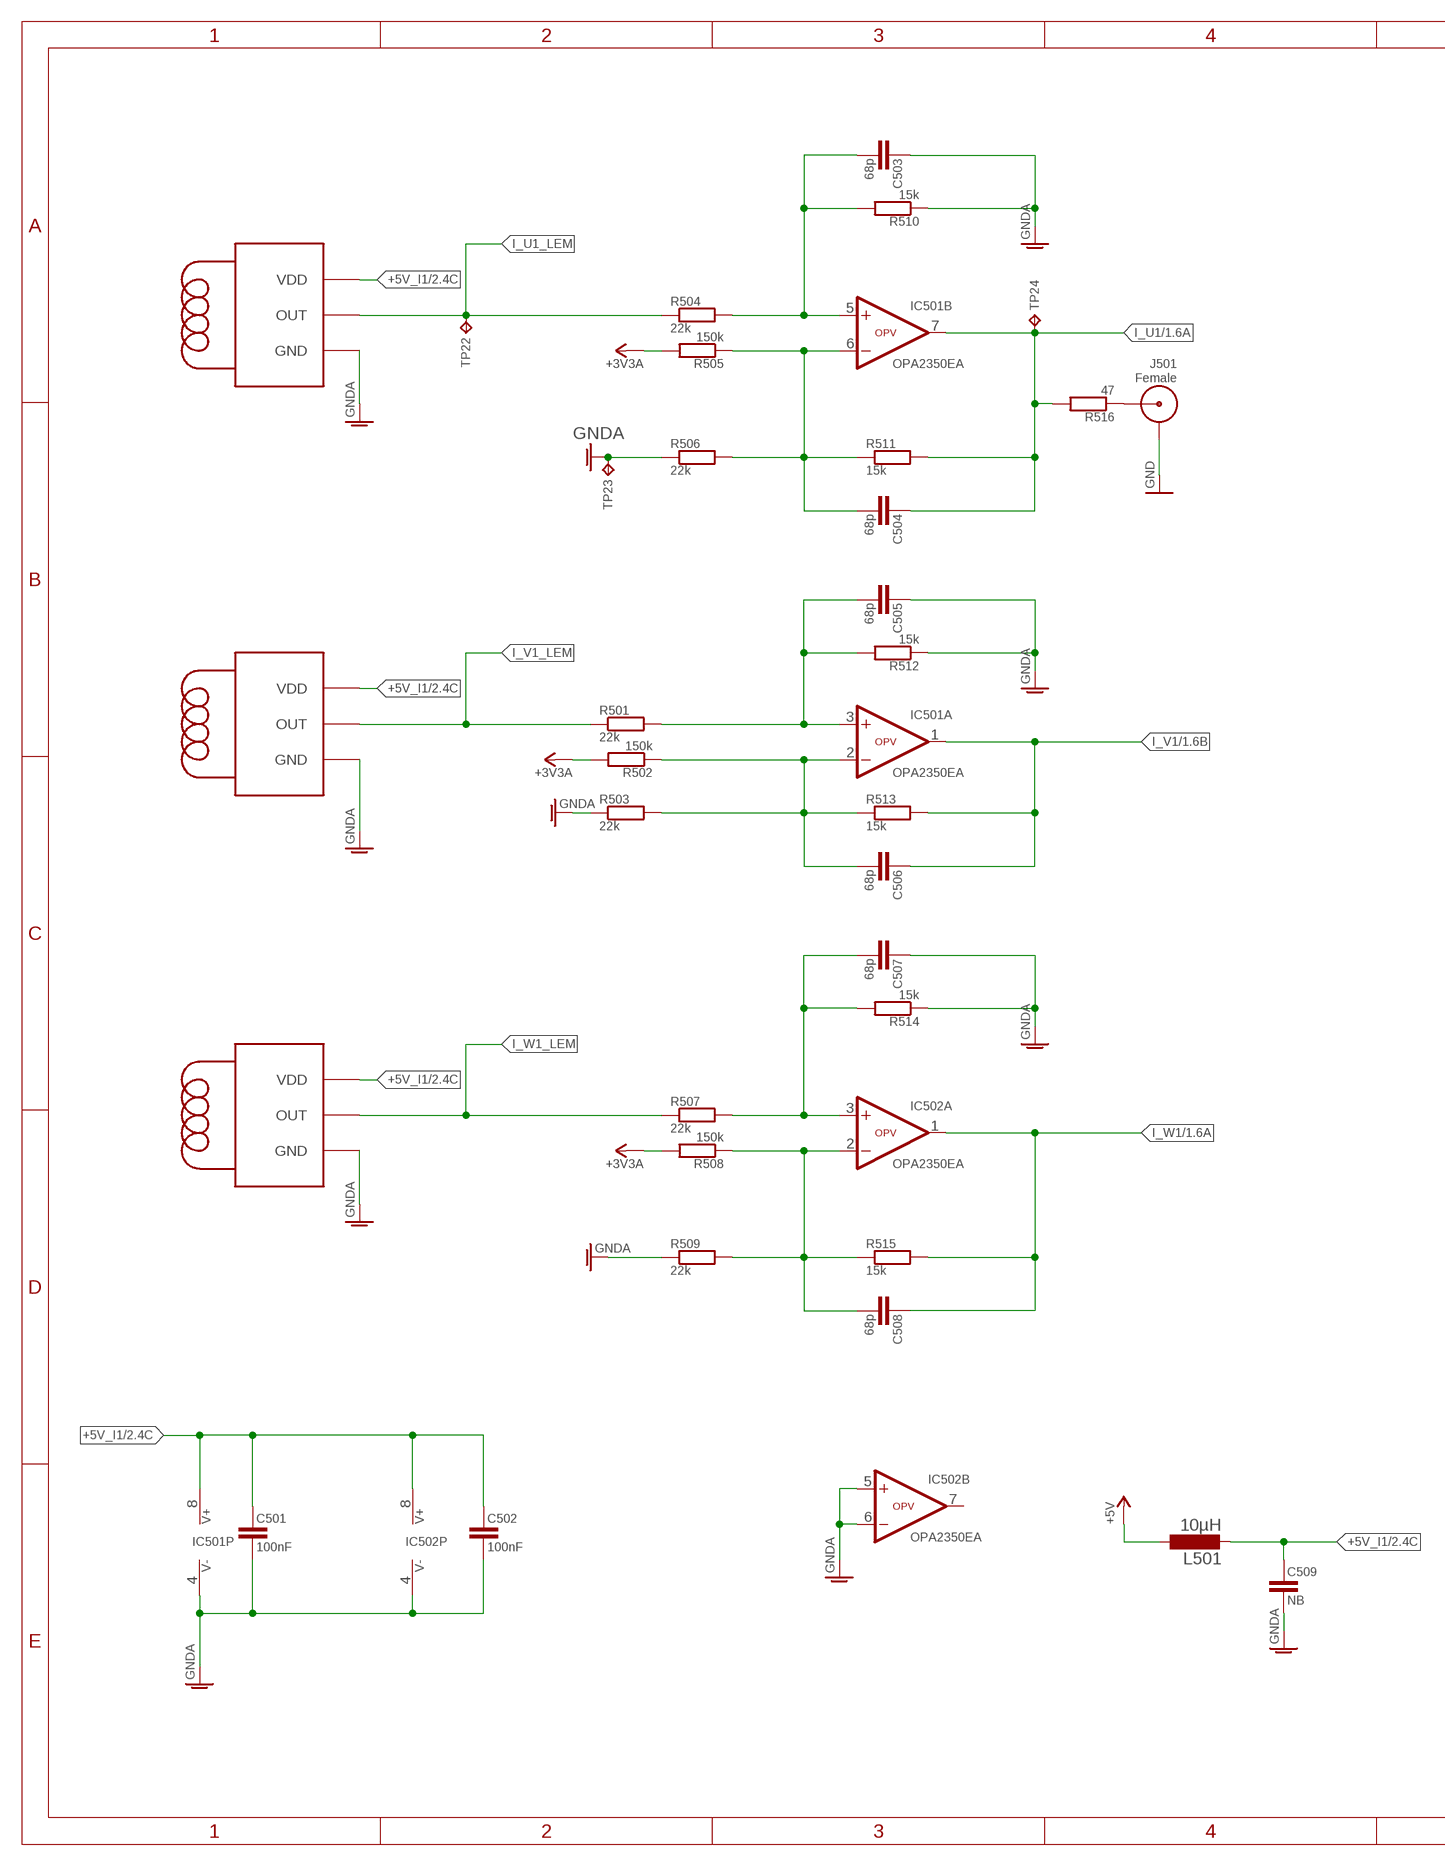
[diagram p6: schematic, sheet 5, part 1 of 2]
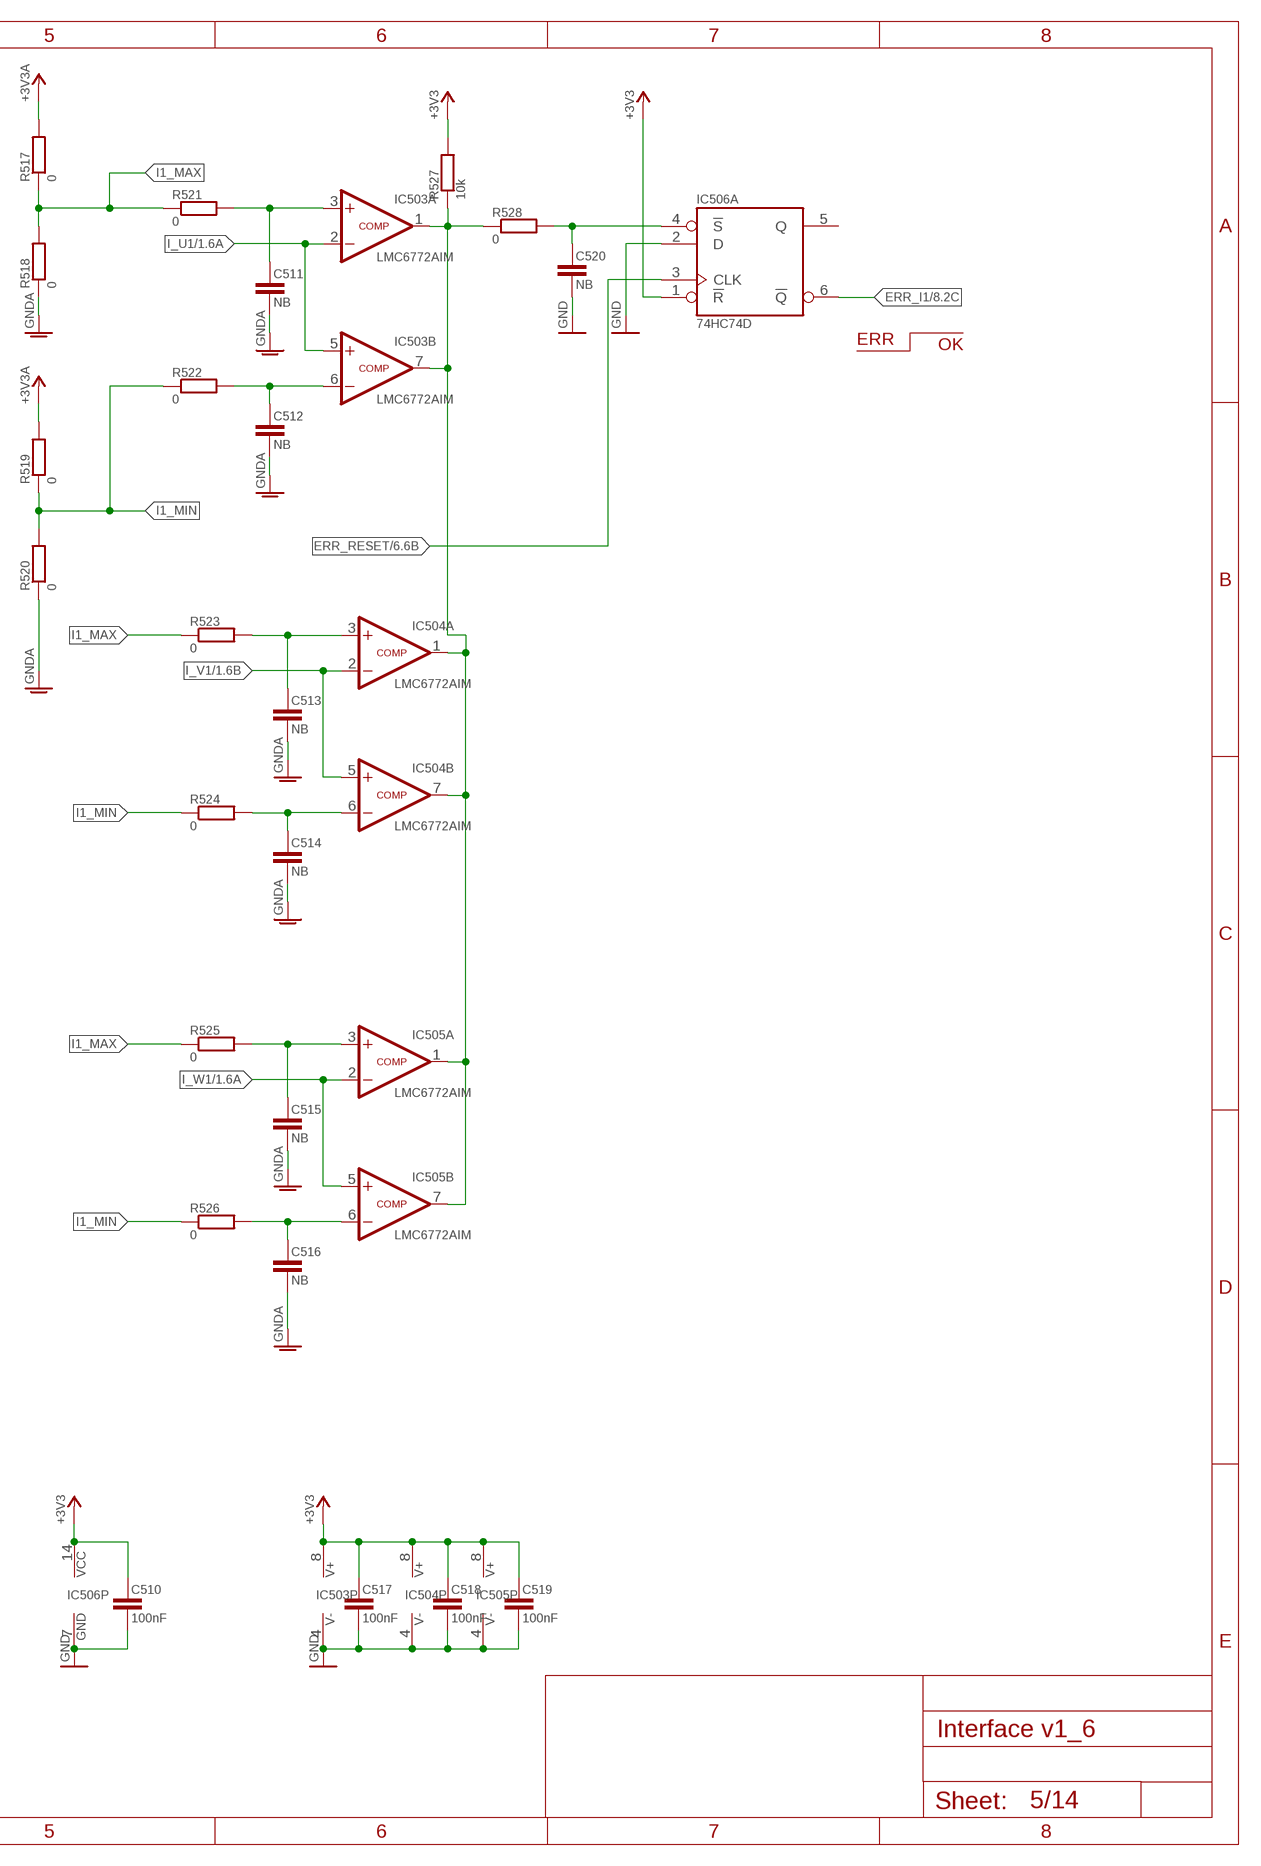
[diagram p7: schematic, sheet 5, part 2 of 2]

### Parts
C501  100nF  C-0805"  [C-0805"]
C502  100nF  C-0805"  [C-0805"]
C503  68p  C-0805"  [C-0805"]
C504  68p  C-0805"  [C-0805"]
C505  68p  C-0805"  [C-0805"]
C506  68p  C-0805"  [C-0805"]
C507  68p  C-0805"  [C-0805"]
C508  68p  C-0805"  [C-0805"]
C509  NB  C-0805"  [C-0805"]
C510  100nF  C-0805"  [C-0805"]
C511  NB  C-0805"  [C-0805"]
C512  NB  C-0805"  [C-0805"]
C513  NB  C-0805"  [C-0805"]
C514  NB  C-0805"  [C-0805"]
C515  NB  C-0805"  [C-0805"]
C516  NB  C-0805"  [C-0805"]
C517  100nF  C-0805"  [C-0805"]
C518  100nF  C-0805"  [C-0805"]
C519  100nF  C-0805"  [C-0805"]
C520  NB  C-0805"  [C-0805"]
I501  HC2F  [HC2F]
I502  HC2F  [HC2F]
I503  HC2F  [HC2F]
IC501  OPA2350EA  OPV-2-SOIC  [SOIC8]
IC502  OPA2350EA  OPV-2-SOIC  [SOIC8]
IC503  LMC6772AIM  COMP-OC-2-SOIC  [SOIC8]
IC504  LMC6772AIM  COMP-OC-2-SOIC  [SOIC8]
IC505  LMC6772AIM  COMP-OC-2-SOIC  [SOIC8]
IC506  74HC74D  [SOIC14]
J501  Female  SMAKL  [SMA_KLEIN]
L501  10µH  L-EUL3230M  [L3230M]
R501  22k  R-0805"  [R-0805"]
R502  150k  R-0805"  [R-0805"]
R503  22k  R-0805"  [R-0805"]
R504  22k  R-0805"  [R-0805"]
R505  150k  R-0805"  [R-0805"]
R506  22k  R-0805"  [R-0805"]
R507  22k  R-0805"  [R-0805"]
R508  150k  R-0805"  [R-0805"]
R509  22k  R-0805"  [R-0805"]
R510  15k  R-0805"  [R-0805"]
R511  15k  R-0805"  [R-0805"]
R512  15k  R-0805"  [R-0805"]
R513  15k  R-0805"  [R-0805"]
R514  15k  R-0805"  [R-0805"]
R515  15k  R-0805"  [R-0805"]
R516  47  R-0805"  [R-0805"]
R517  0  R-0805"  [R-0805"]
R518  0  R-0805"  [R-0805"]
R519  0  R-0805"  [R-0805"]
R520  0  R-0805"  [R-0805"]
R521  0  R-0805"  [R-0805"]
R522  0  R-0805"  [R-0805"]
R523  0  R-0805"  [R-0805"]
R524  0  R-0805"  [R-0805"]
R525  0  R-0805"  [R-0805"]
R526  0  R-0805"  [R-0805"]
R527  10k  R-0805"  [R-0805"]
R528  0  R-0805"  [R-0805"]
TP22  TP-TH-08  [TP-08]
TP23  TP-TH-12  [TP-12]
TP24  TP-TH-08  [TP-08]

### Nets
+3V3 [VDD]: C510.1 C517.1 C518.1 C519.1 IC503.8(P:V+) IC504.8(P:V+) IC505.8(P:V+) IC506.1(A:!R) IC506.14(P:VCC) R527.2 ; also sheet 1,2,3,4,6,7,8,9,11,13
+3V3A_I1 [VDD]: R502.2 R505.2 R508.2 R517.2 R519.2 ; supply symbol labelled +3V3A ; also sheet 2
+5V [VDD]: L501.1 ; also sheet 1,2,3,4,6,7,10,12,13
+5V_I1 [VDD]: C501.1 C502.1 C509.1 I501.3(VDD) I502.3(VDD) I503.3(VDD) IC501.8(P:V+) IC502.8(P:V+) L501.2 ; also sheet 2
ERR_I1: IC506.6(A:!Q) ; also sheet 1,8
ERR_RESET: IC506.3(A:CLK) ; also sheet 1,3,4,6,7,11,13
GND: C510.2 C517.2 C518.2 C519.2 C520.2 IC503.4(P:V-) IC504.4(P:V-) IC505.4(P:V-) IC506.2(A:D) IC506.7(P:GND) J501.1(GND) J501.3(GND) J501.4(GND) J501.5(GND) ; also sheet 1,2,3,4,6,7,8,9,10,11,12,13,14
GNDA: C501.2 C502.2 C503.1 C505.1 C507.1 C509.2 C511.2 C512.2 C513.2 C514.2 C515.2 C516.2 I501.2(GND) I501.E1(GND) I501.E2(GND) I501.E3(GND) I501.E4(GND) I502.2(GND) I502.E1(GND) I502.E2(GND) I502.E3(GND) I502.E4(GND) I503.2(GND) I503.E1(GND) I503.E2(GND) I503.E3(GND) I503.E4(GND) IC501.4(P:V-) IC502.4(P:V-) IC502.5(B:+IN) IC502.6(B:-IN) R503.1 R506.1 R509.1 R510.1 R512.1 R514.1 R518.1 R520.1 TP23.TP ; also sheet 1,2,4,6
I1_MAX: R517.1 R518.2 R521.1 R523.1 R525.1
I1_MIN: R519.1 R520.2 R522.1 R524.1 R526.1
I_U1: C504.1 IC501.7(B:OUT) IC503.2(A:-IN) IC503.5(B:+IN) R511.2 R516.2 TP24.TP ; also sheet 1
I_U1_LEM: I501.1(OUT) R504.1 TP22.TP
I_V1: C506.1 IC501.1(A:OUT) IC504.2(A:-IN) IC504.5(B:+IN) R513.2 ; also sheet 1
I_V1_LEM: I502.1(OUT) R501.1
I_W1: C508.1 IC502.1(A:OUT) IC505.2(A:-IN) IC505.5(B:+IN) R515.2 ; also sheet 1
I_W1_LEM: I503.1(OUT) R507.1
MINUS: C508.2 IC502.2(A:-IN) R508.1 R509.2 R515.1
N$4: C503.2 IC501.5(B:+IN) R504.2 R510.2
N$7: C504.2 IC501.6(B:-IN) R505.1 R506.2 R511.1
N$8: C506.2 IC501.2(A:-IN) R502.1 R503.2 R513.1
N$9: J501.SIG R516.1
N$10: C505.2 IC501.3(A:+IN) R501.2 R512.2
N$43: C512.1 IC503.6(B:-IN) R522.2
N$55: C511.1 IC503.3(A:+IN) R521.2
N$62: C520.1 IC506.4(A:!S) R528.2
N$63: C514.1 IC504.6(B:-IN) R524.2
N$87: C513.1 IC504.3(A:+IN) R523.2
N$242: C515.1 IC505.3(A:+IN) R525.2
N$243: C516.1 IC505.6(B:-IN) R526.2
OC_M1: IC503.1(A:OUT) IC503.7(B:OUT) IC504.1(A:OUT) IC504.7(B:OUT) IC505.1(A:OUT) IC505.7(B:OUT) R527.1 R528.1
PLUS: C507.2 IC502.3(A:+IN) R507.2 R514.2
Unconnected: IC502.7(B:OUT) IC506.5(A:Q)

### Notes on the sheet
- ERR
- OK

## Sheet 6 of 14: I M2
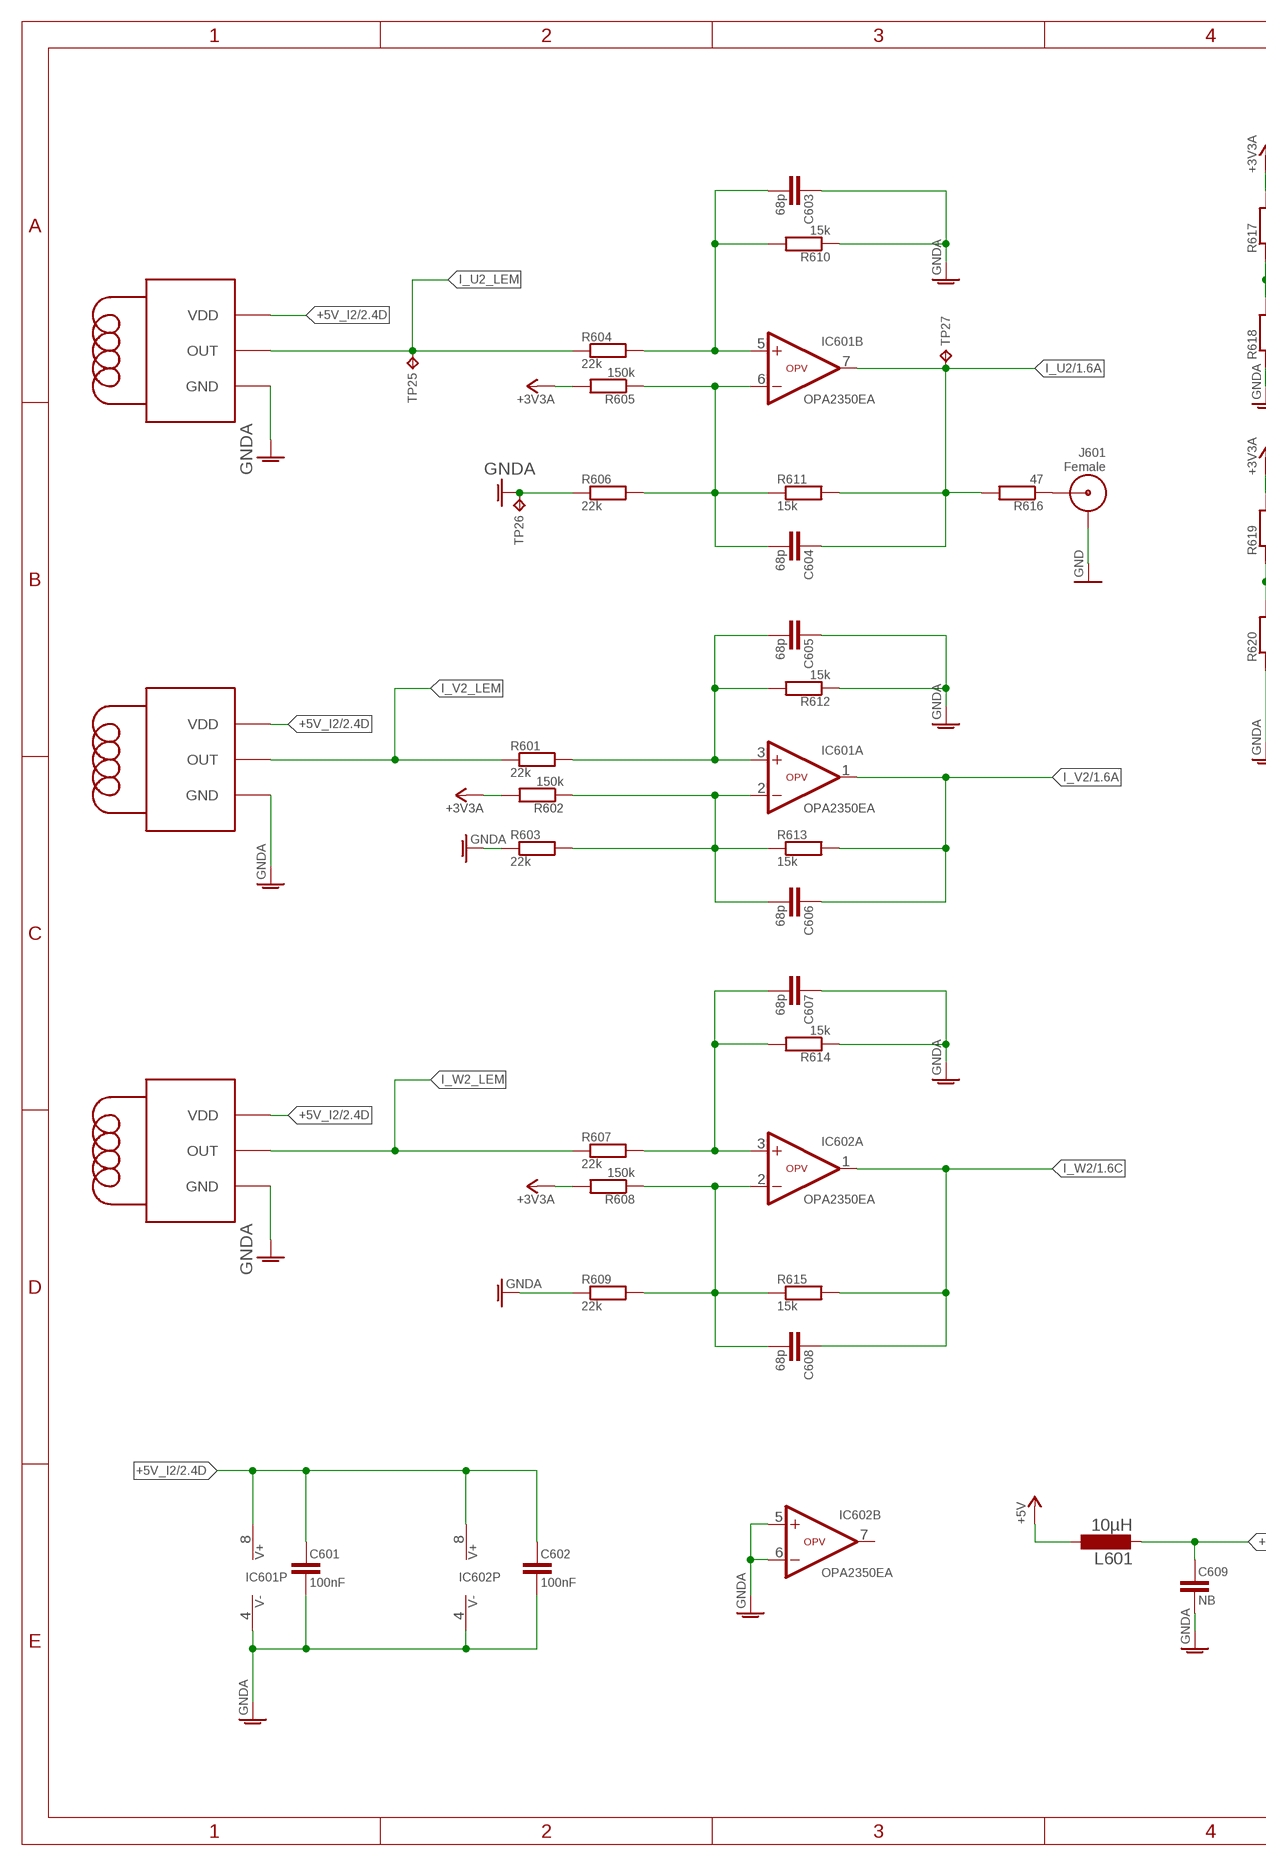
[diagram p8: schematic, sheet 6, part 1 of 2]
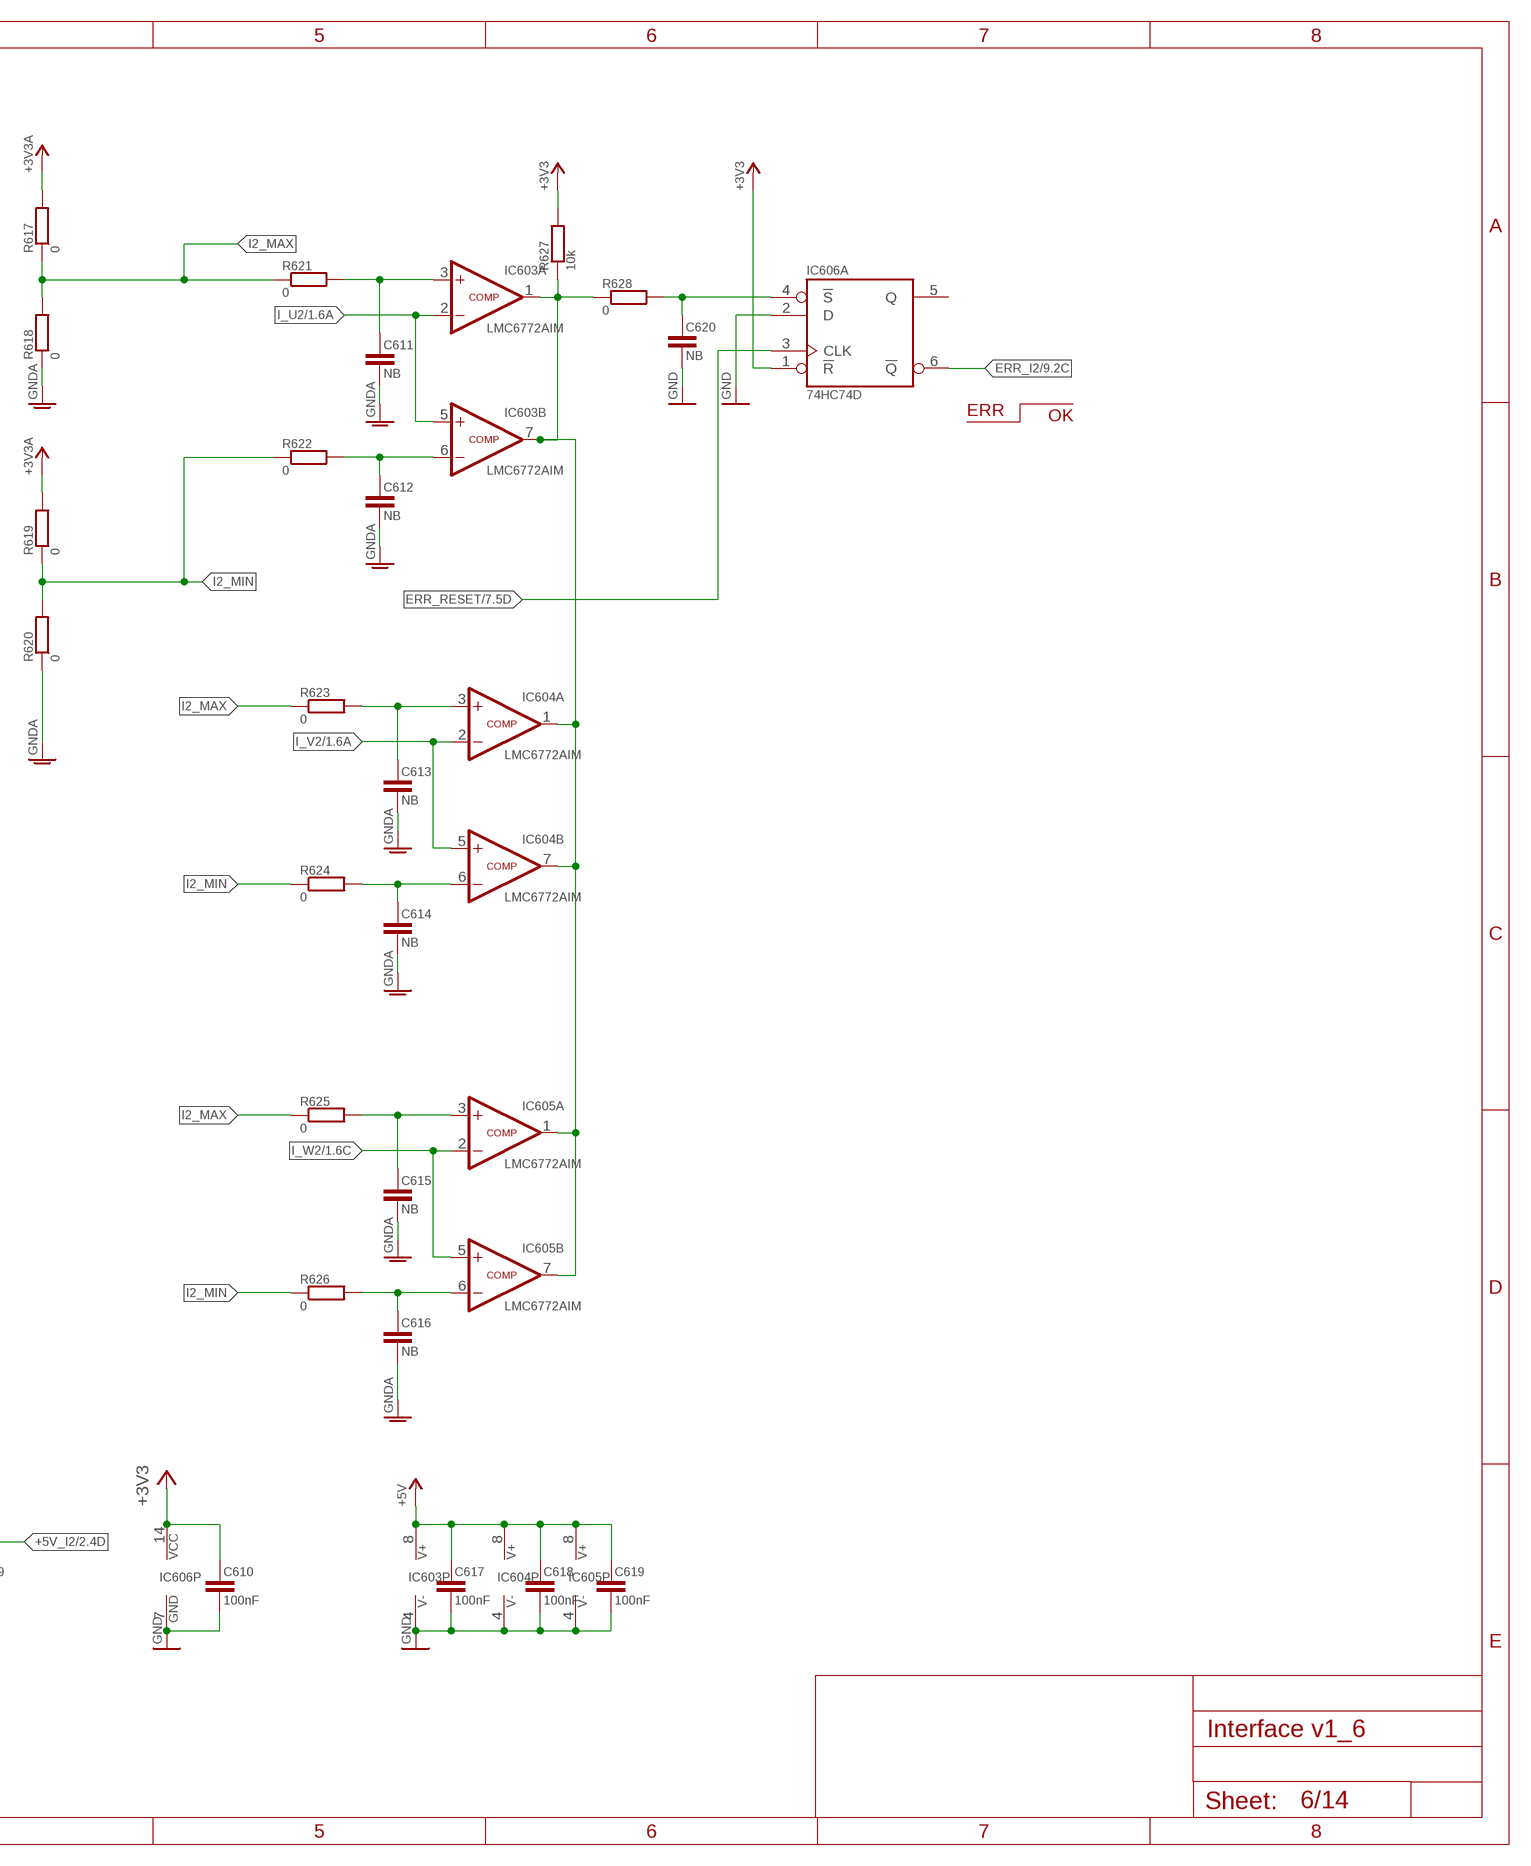
[diagram p9: schematic, sheet 6, part 2 of 2]

### Parts
C601  100nF  C-0805"  [C-0805"]
C602  100nF  C-0805"  [C-0805"]
C603  68p  C-0805"  [C-0805"]
C604  68p  C-0805"  [C-0805"]
C605  68p  C-0805"  [C-0805"]
C606  68p  C-0805"  [C-0805"]
C607  68p  C-0805"  [C-0805"]
C608  68p  C-0805"  [C-0805"]
C609  NB  C-0805"  [C-0805"]
C610  100nF  C-0805"  [C-0805"]
C611  NB  C-0805"  [C-0805"]
C612  NB  C-0805"  [C-0805"]
C613  NB  C-0805"  [C-0805"]
C614  NB  C-0805"  [C-0805"]
C615  NB  C-0805"  [C-0805"]
C616  NB  C-0805"  [C-0805"]
C617  100nF  C-0805"  [C-0805"]
C618  100nF  C-0805"  [C-0805"]
C619  100nF  C-0805"  [C-0805"]
C620  NB  C-0805"  [C-0805"]
I601  HC2F  [HC2F]
I602  HC2F  [HC2F]
I603  HC2F  [HC2F]
IC601  OPA2350EA  OPV-2-SOIC  [SOIC8]
IC602  OPA2350EA  OPV-2-SOIC  [SOIC8]
IC603  LMC6772AIM  COMP-OC-2-SOIC  [SOIC8]
IC604  LMC6772AIM  COMP-OC-2-SOIC  [SOIC8]
IC605  LMC6772AIM  COMP-OC-2-SOIC  [SOIC8]
IC606  74HC74D  [SOIC14]
J601  Female  SMAKL  [SMA_KLEIN]
L601  10µH  L-EUL3230M  [L3230M]
R601  22k  R-0805"  [R-0805"]
R602  150k  R-0805"  [R-0805"]
R603  22k  R-0805"  [R-0805"]
R604  22k  R-0805"  [R-0805"]
R605  150k  R-0805"  [R-0805"]
R606  22k  R-0805"  [R-0805"]
R607  22k  R-0805"  [R-0805"]
R608  150k  R-0805"  [R-0805"]
R609  22k  R-0805"  [R-0805"]
R610  15k  R-0805"  [R-0805"]
R611  15k  R-0805"  [R-0805"]
R612  15k  R-0805"  [R-0805"]
R613  15k  R-0805"  [R-0805"]
R614  15k  R-0805"  [R-0805"]
R615  15k  R-0805"  [R-0805"]
R616  47  R-0805"  [R-0805"]
R617  0  R-0805"  [R-0805"]
R618  0  R-0805"  [R-0805"]
R619  0  R-0805"  [R-0805"]
R620  0  R-0805"  [R-0805"]
R621  0  R-0805"  [R-0805"]
R622  0  R-0805"  [R-0805"]
R623  0  R-0805"  [R-0805"]
R624  0  R-0805"  [R-0805"]
R625  0  R-0805"  [R-0805"]
R626  0  R-0805"  [R-0805"]
R627  10k  R-0805"  [R-0805"]
R628  0  R-0805"  [R-0805"]
TP25  TP-TH-08  [TP-08]
TP26  TP-TH-12  [TP-12]
TP27  TP-TH-08  [TP-08]

### Nets
+3V3 [VDD]: C610.1 IC606.1(A:!R) IC606.14(P:VCC) R627.2 ; also sheet 1,2,3,4,5,7,8,9,11,13
+3V3A_I2 [VDD]: R602.2 R605.2 R608.2 R617.2 R619.2 ; supply symbol labelled +3V3A ; also sheet 2
+5V [VDD]: C617.1 C618.1 C619.1 IC603.8(P:V+) IC604.8(P:V+) IC605.8(P:V+) L601.1 ; also sheet 1,2,3,4,5,7,10,12,13
+5V_I2 [VDD]: C601.1 C602.1 C609.1 I601.3(VDD) I602.3(VDD) I603.3(VDD) IC601.8(P:V+) IC602.8(P:V+) L601.2 ; also sheet 2
ERR_I2: IC606.6(A:!Q) ; also sheet 9
ERR_RESET: IC606.3(A:CLK) ; also sheet 1,3,4,5,7,11,13
GND: C610.2 C617.2 C618.2 C619.2 C620.2 IC603.4(P:V-) IC604.4(P:V-) IC605.4(P:V-) IC606.2(A:D) IC606.7(P:GND) J601.1(GND) J601.3(GND) J601.4(GND) J601.5(GND) ; also sheet 1,2,3,4,5,7,8,9,10,11,12,13,14
GNDA: C601.2 C602.2 C603.1 C605.1 C607.1 C609.2 C611.2 C612.2 C613.2 C614.2 C615.2 C616.2 I601.2(GND) I601.E1(GND) I601.E2(GND) I601.E3(GND) I601.E4(GND) I602.2(GND) I602.E1(GND) I602.E2(GND) I602.E3(GND) I602.E4(GND) I603.2(GND) I603.E1(GND) I603.E2(GND) I603.E3(GND) I603.E4(GND) IC601.4(P:V-) IC602.4(P:V-) IC602.5(B:+IN) IC602.6(B:-IN) R603.1 R606.1 R609.1 R610.1 R612.1 R614.1 R618.1 R620.1 TP26.TP ; also sheet 1,2,4,5
I2_MAX: R617.1 R618.2 R621.1 R623.1 R625.1
I2_MIN: R619.1 R620.2 R622.1 R624.1 R626.1
I_U2: C604.1 IC601.7(B:OUT) IC603.2(A:-IN) IC603.5(B:+IN) R611.2 R616.2 TP27.TP ; also sheet 1
I_U2_LEM: I601.1(OUT) R604.1 TP25.TP
I_V2: C606.1 IC601.1(A:OUT) IC604.2(A:-IN) IC604.5(B:+IN) R613.2 ; also sheet 1
I_V2_LEM: I602.1(OUT) R601.1
I_W2: C608.1 IC602.1(A:OUT) IC605.2(A:-IN) IC605.5(B:+IN) R615.2 ; also sheet 1
I_W2_LEM: I603.1(OUT) R607.1
MINUS2: C608.2 IC602.2(A:-IN) R608.1 R609.2 R615.1
N$17: C612.1 IC603.6(B:-IN) R622.2
N$18: C611.1 IC603.3(A:+IN) R621.2
N$47: C620.1 IC606.4(A:!S) R628.2
N$65: C614.1 IC604.6(B:-IN) R624.2
N$71: C613.1 IC604.3(A:+IN) R623.2
N$230: C615.1 IC605.3(A:+IN) R625.2
N$233: C616.1 IC605.6(B:-IN) R626.2
N$236: C604.2 IC601.6(B:-IN) R605.1 R606.2 R611.1
N$237: C603.2 IC601.5(B:+IN) R604.2 R610.2
N$238: C606.2 IC601.2(A:-IN) R602.1 R603.2 R613.1
N$239: C605.2 IC601.3(A:+IN) R601.2 R612.2
N$240: J601.SIG R616.1
OC_M2: IC603.1(A:OUT) IC603.7(B:OUT) IC604.1(A:OUT) IC604.7(B:OUT) IC605.1(A:OUT) IC605.7(B:OUT) R627.1 R628.1
PLUS2: C607.2 IC602.3(A:+IN) R607.2 R614.2
Unconnected: IC602.7(B:OUT) IC606.5(A:Q)

### Notes on the sheet
- ERR
- OK

## Sheet 7 of 14: TempMIPAQ
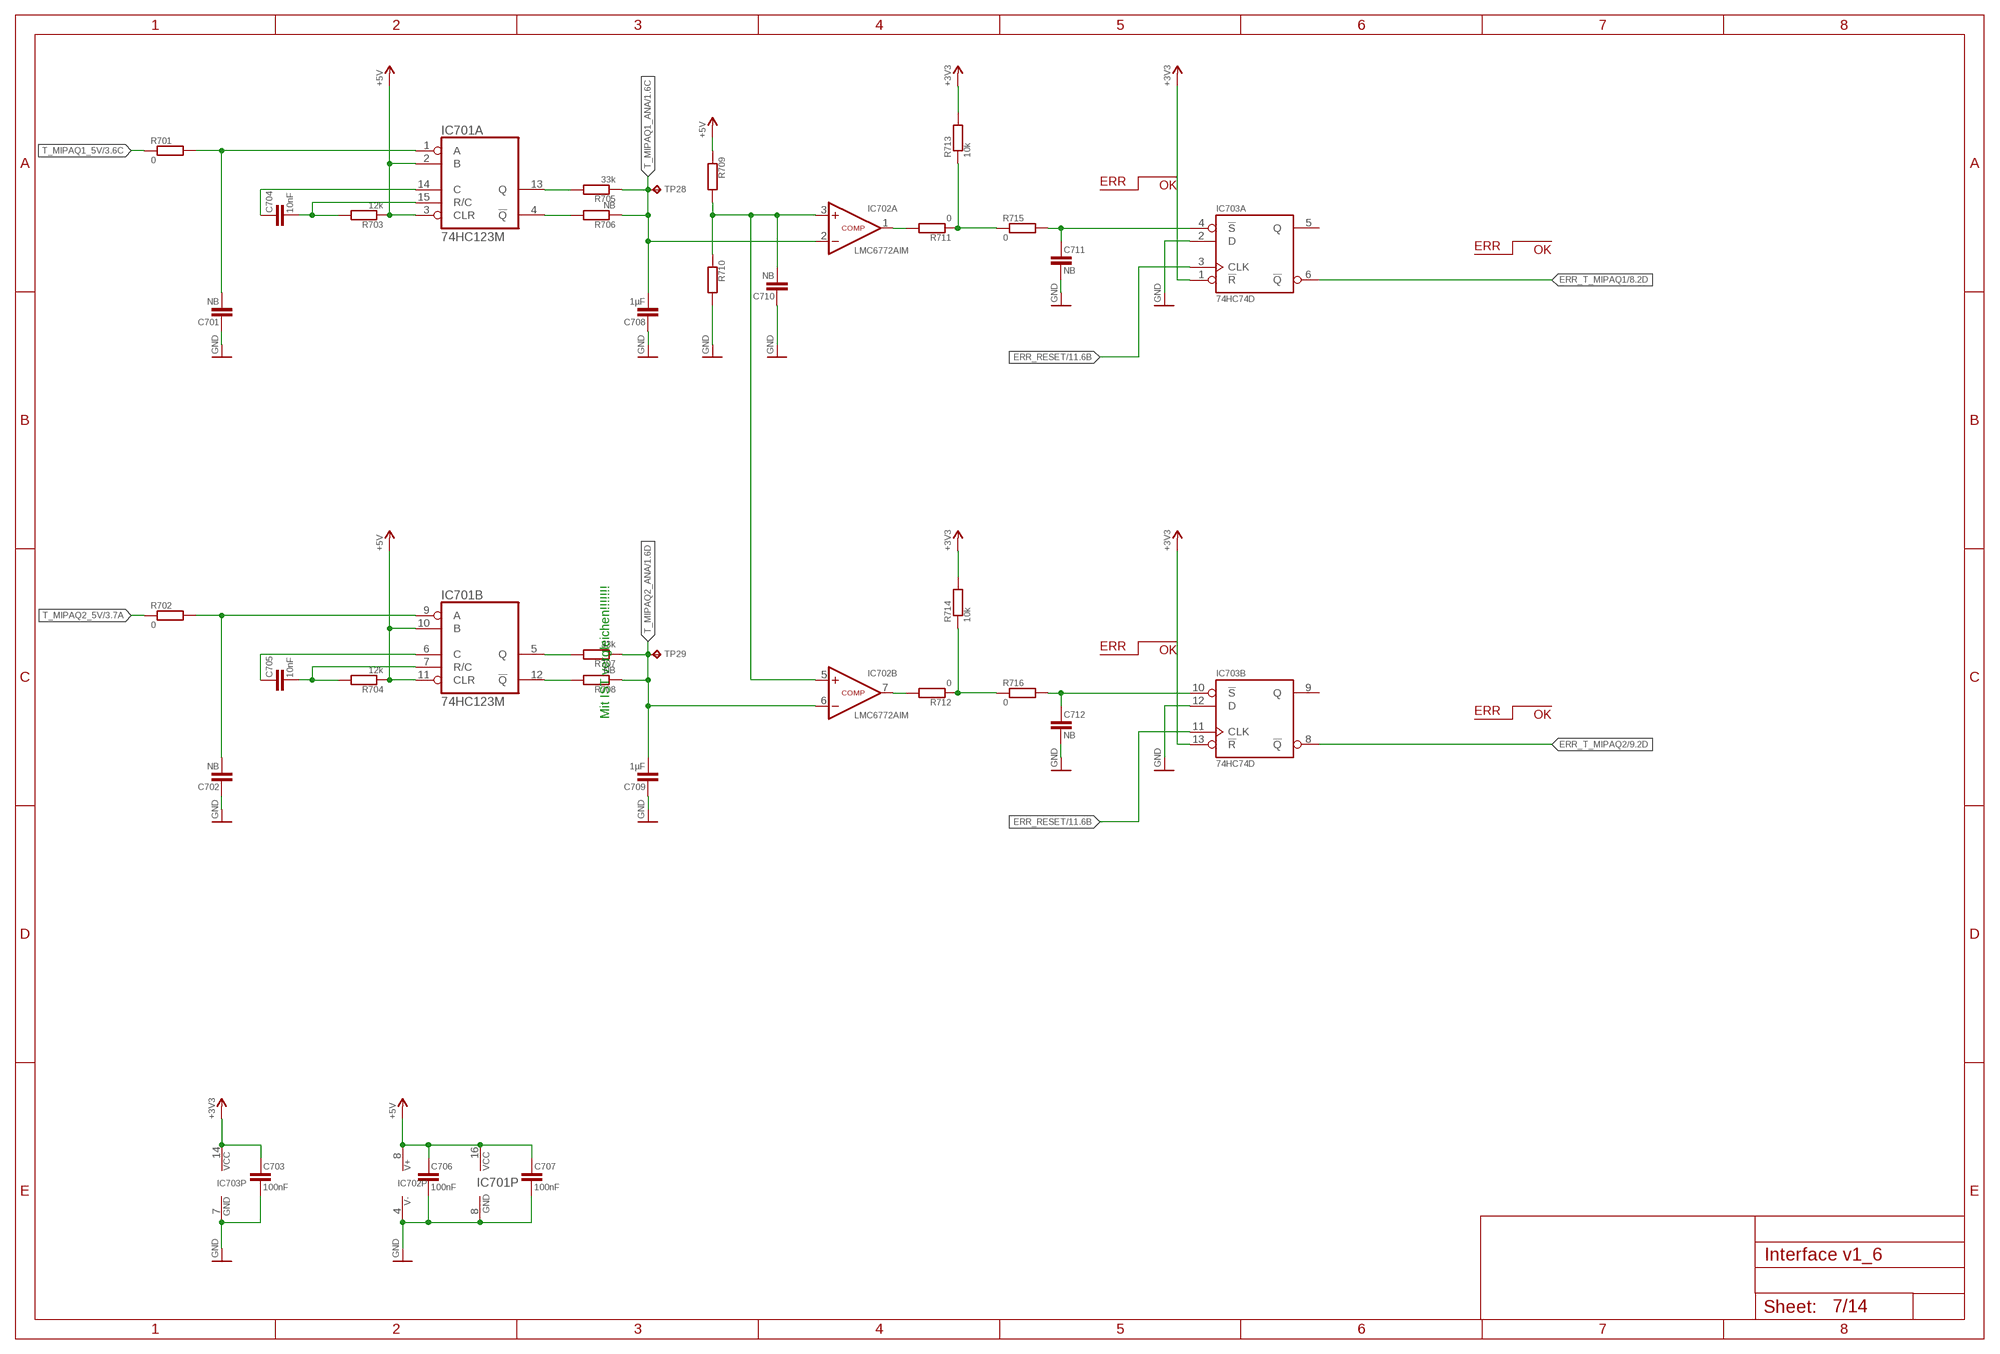
[diagram p10: schematic, sheet 7]

### Parts
C701  NB  C-0805"  [C-0805"]
C702  NB  C-0805"  [C-0805"]
C703  100nF  C-0805"  [C-0805"]
C704  10nF  C-0805"  [C-0805"]
C705  10nF  C-0805"  [C-0805"]
C706  100nF  C-0805"  [C-0805"]
C707  100nF  C-0805"  [C-0805"]
C708  1µF  C-0805"  [C-0805"]
C709  1µF  C-0805"  [C-0805"]
C710  NB  C-0805"  [C-0805"]
C711  NB  C-0805"  [C-0805"]
C712  NB  C-0805"  [C-0805"]
IC701  74HC123M  74LS123D  [SO16]
IC702  LMC6772AIM  COMP-OC-2-SOIC  [SOIC8]
IC703  74HC74D  [SOIC14]
R701  0  R-0805"  [R-0805"]
R702  0  R-0805"  [R-0805"]
R703  12k  R-0805"  [R-0805"]
R704  12k  R-0805"  [R-0805"]
R705  33k  R-0805"  [R-0805"]
R706  NB  R-0805"  [R-0805"]
R707  33k  R-0805"  [R-0805"]
R708  NB  R-0805"  [R-0805"]
R709  R-0805"  [R-0805"]
R710  R-0805"  [R-0805"]
R711  0  R-0805"  [R-0805"]
R712  0  R-0805"  [R-0805"]
R713  10k  R-0805"  [R-0805"]
R714  10k  R-0805"  [R-0805"]
R715  0  R-0805"  [R-0805"]
R716  0  R-0805"  [R-0805"]
TP28  TP-TH-08  [TP-08]
TP29  TP-TH-08  [TP-08]

### Nets
+3V3 [VDD]: C703.1 IC703.1(A:!R) IC703.13(B:!R) IC703.14(P:VCC) R713.2 R714.2 ; also sheet 1,2,3,4,5,6,8,9,11,13
+5V [VDD]: C706.1 C707.1 IC701.2(A:B) IC701.3(A:CLR) IC701.10(B:B) IC701.11(B:CLR) IC701.16(P:VCC) IC702.8(P:V+) R703.1 R704.1 R709.1 ; also sheet 1,2,3,4,5,6,10,12,13
ERR_RESET: IC703.3(A:CLK) IC703.11(B:CLK) ; also sheet 1,3,4,5,6,11,13
ERR_T_MIPAQ1: IC703.6(A:!Q) ; also sheet 8
ERR_T_MIPAQ2: IC703.8(B:!Q) ; also sheet 9
GND: C701.1 C702.1 C703.2 C706.2 C707.2 C708.1 C709.1 C710.1 C711.2 C712.2 IC701.8(P:GND) IC702.4(P:V-) IC703.2(A:D) IC703.7(P:GND) IC703.12(B:D) R710.2 ; also sheet 1,2,3,4,5,6,8,9,10,11,12,13,14
N$3: IC702.7(B:OUT) R712.2
N$6: IC702.1(A:OUT) R711.2
N$20: C702.2 IC701.9(B:A) R702.2
N$22: IC701.13(A:Q) R705.2
N$23: C701.2 IC701.1(A:A) R701.2
N$24: C704.2 IC701.15(A:R/C) R703.2
N$26: IC701.4(A:!Q) R706.2
N$28: C710.2 IC702.3(A:+IN) IC702.5(B:+IN) R709.2 R710.1
N$89: R711.1 R713.1 R715.1
N$101: C704.1 IC701.14(A:C)
N$104: C705.2 IC701.7(B:R/C) R704.2
N$105: IC701.5(B:Q) R707.2
N$106: IC701.12(B:!Q) R708.2
N$116: C712.1 IC703.10(B:!S) R716.2
N$117: C705.1 IC701.6(B:C)
N$118: R712.1 R714.1 R716.1
N$198: C711.1 IC703.4(A:!S) R715.2
T_MIPAQ1_5V: R701.1 ; also sheet 3
T_MIPAQ1_ANA: C708.2 IC702.2(A:-IN) R705.1 R706.1 TP28.TP ; also sheet 1
T_MIPAQ2_5V: R702.1 ; also sheet 3
T_MIPAQ2_ANA: C709.2 IC702.6(B:-IN) R707.1 R708.1 TP29.TP ; also sheet 1
Unconnected: IC703.5(A:Q) IC703.9(B:Q)

### Notes on the sheet
- ERR
- OK
- ERR
- OK
- ERR
- OK
- ERR
- Mit IST vergleichen!!!!!!! | OK

## Sheet 8 of 14: Notabschaltung Motor 1
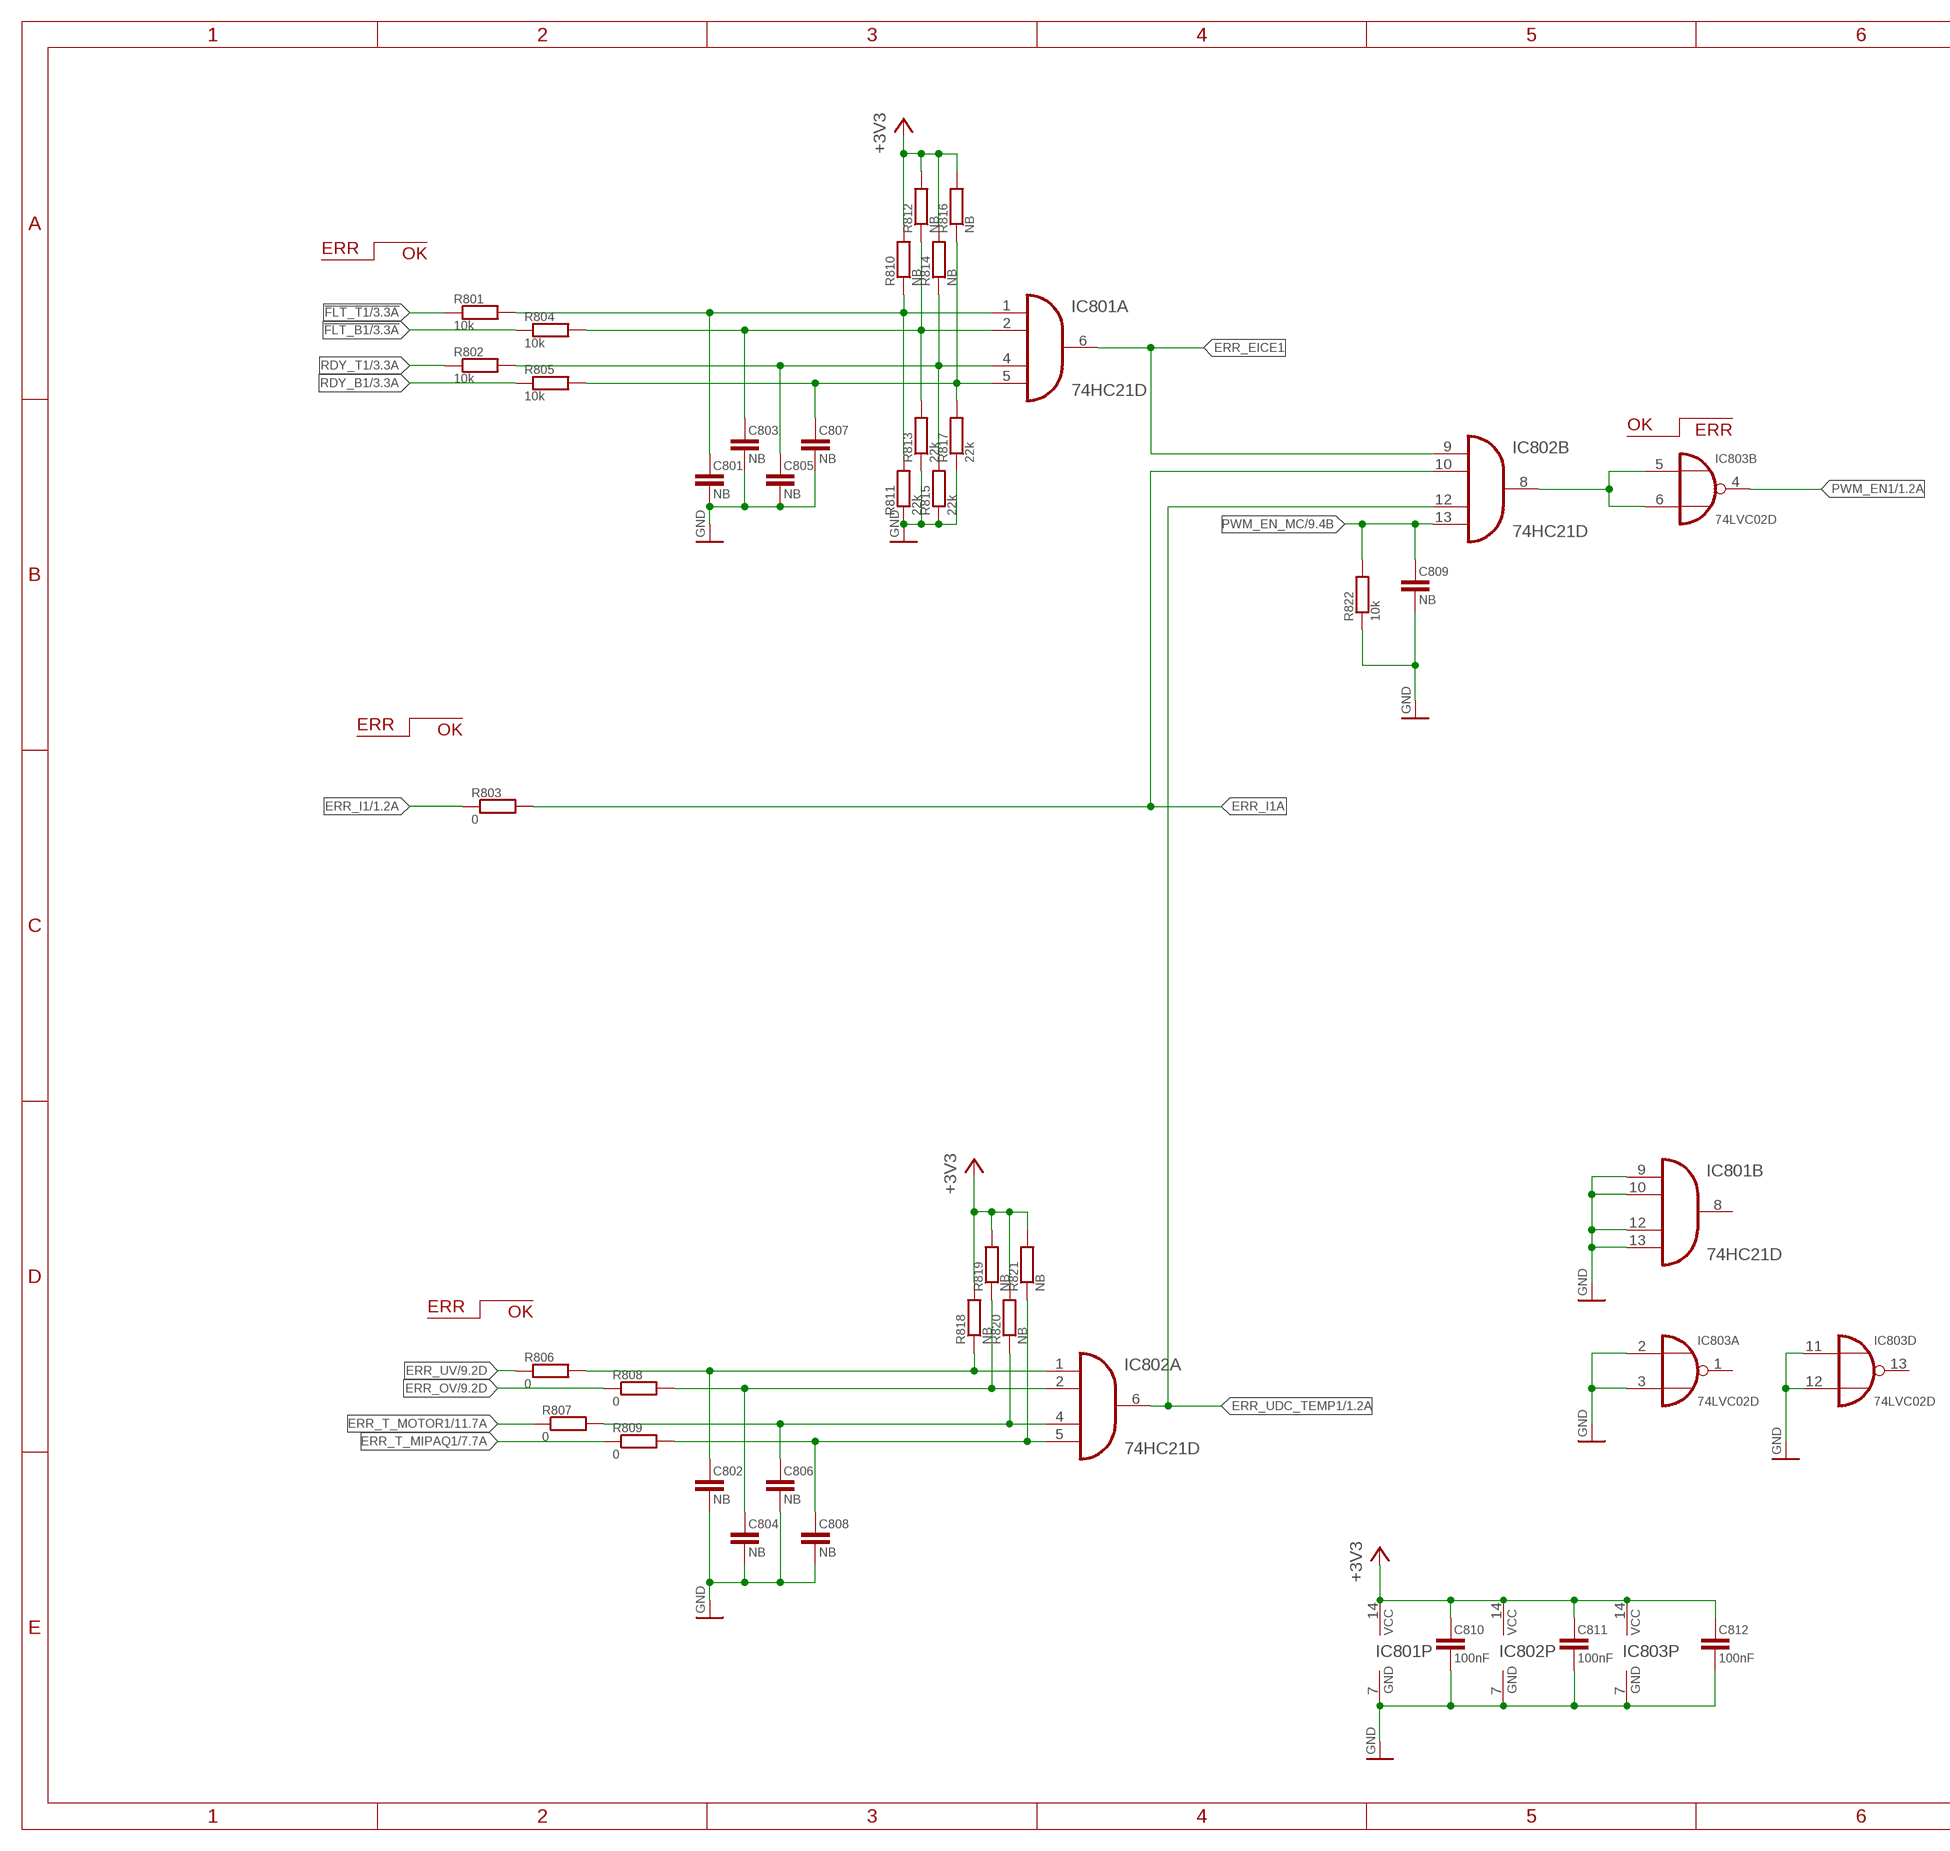
[diagram p11: schematic, sheet 8, part 1 of 2]
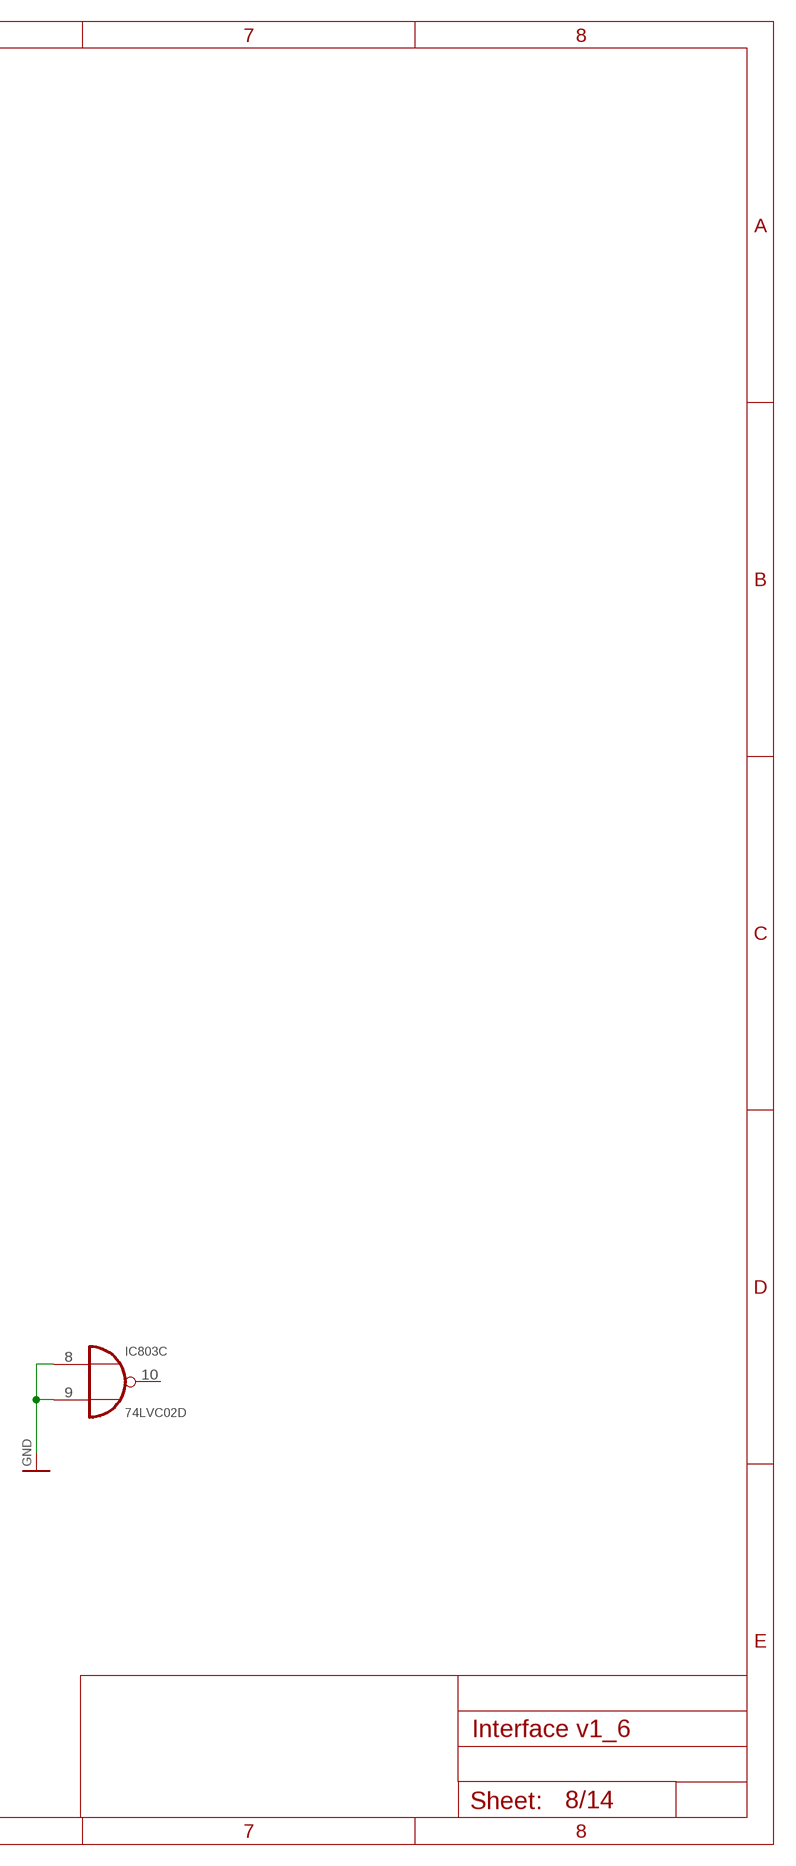
[diagram p12: schematic, sheet 8, part 2 of 2]

### Parts
C801  NB  C-0805"  [C-0805"]
C802  NB  C-0805"  [C-0805"]
C803  NB  C-0805"  [C-0805"]
C804  NB  C-0805"  [C-0805"]
C805  NB  C-0805"  [C-0805"]
C806  NB  C-0805"  [C-0805"]
C807  NB  C-0805"  [C-0805"]
C808  NB  C-0805"  [C-0805"]
C809  NB  C-0805"  [C-0805"]
C810  100nF  C-0805"  [C-0805"]
C811  100nF  C-0805"  [C-0805"]
C812  100nF  C-0805"  [C-0805"]
IC801  74HC21D  7421D  [SOIC14]
IC802  74HC21D  7421D  [SOIC14]
IC803  74LVC02D  7402D  [SOIC14]
R801  10k  R-0805"  [R-0805"]
R802  10k  R-0805"  [R-0805"]
R803  0  R-0805"  [R-0805"]
R804  10k  R-0805"  [R-0805"]
R805  10k  R-0805"  [R-0805"]
R806  0  R-0805"  [R-0805"]
R807  0  R-0805"  [R-0805"]
R808  0  R-0805"  [R-0805"]
R809  0  R-0805"  [R-0805"]
R810  NB  R-0805"  [R-0805"]
R811  22k  R-0805"  [R-0805"]
R812  NB  R-0805"  [R-0805"]
R813  22k  R-0805"  [R-0805"]
R814  NB  R-0805"  [R-0805"]
R815  22k  R-0805"  [R-0805"]
R816  NB  R-0805"  [R-0805"]
R817  22k  R-0805"  [R-0805"]
R818  NB  R-0805"  [R-0805"]
R819  NB  R-0805"  [R-0805"]
R820  NB  R-0805"  [R-0805"]
R821  NB  R-0805"  [R-0805"]
R822  10k  R-0805"  [R-0805"]

### Nets
!FLT_B1: R804.1 ; also sheet 3
!FLT_T1: R801.1 ; also sheet 3
+3V3 [VDD]: C810.1 C811.1 C812.1 IC801.14(P:VCC) IC802.14(P:VCC) IC803.14(P:VCC) R810.2 R812.2 R814.2 R816.2 R818.2 R819.2 R820.2 R821.2 ; also sheet 1,2,3,4,5,6,7,9,11,13
ERR_EICE1: IC801.6(A:O) IC802.9(B:I0)
ERR_I1: R803.1 ; also sheet 1,5
ERR_I1A: IC802.10(B:I1) R803.2
ERR_OV: R808.1 ; also sheet 1,4,9
ERR_T_MIPAQ1: R809.1 ; also sheet 7
ERR_T_MOTOR1: R807.1 ; also sheet 11
ERR_UDC_TEMP1: IC802.6(A:O) IC802.12(B:I2) ; also sheet 1
ERR_UV: R806.1 ; also sheet 1,4,9
GND: C801.2 C802.2 C803.2 C804.2 C805.2 C806.2 C807.2 C808.2 C809.2 C810.2 C811.2 C812.2 IC801.7(P:GND) IC801.9(B:I0) IC801.10(B:I1) IC801.12(B:I2) IC801.13(B:I3) IC802.7(P:GND) IC803.2(A:I0) IC803.3(A:I1) IC803.7(P:GND) IC803.8(C:I0) IC803.9(C:I1) IC803.11(D:I0) IC803.12(D:I1) R811.1 R813.1 R815.1 R817.1 R822.1 ; also sheet 1,2,3,4,5,6,7,9,10,11,12,13,14
N$34: C801.1 IC801.1(A:I0) R801.2 R810.1 R811.2
N$37: C805.1 IC801.4(A:I2) R802.2 R814.1 R815.2
N$38: C807.1 IC801.5(A:I3) R805.2 R816.1 R817.2
N$91: C802.1 IC802.1(A:I0) R806.2 R818.1
N$95: C804.1 IC802.2(A:I1) R808.2 R819.1
N$96: C806.1 IC802.4(A:I2) R807.2 R820.1
N$97: C808.1 IC802.5(A:I3) R809.2 R821.1
N$100: IC802.8(B:O) IC803.5(B:I0) IC803.6(B:I1)
N$130: C803.1 IC801.2(A:I1) R804.2 R812.1 R813.2
PWM_EN1: IC803.4(B:O) ; also sheet 1,3
PWM_EN_MC: C809.1 IC802.13(B:I3) R822.2 ; also sheet 1,9
RDY_B1: R805.1 ; also sheet 3
RDY_T1: R802.1 ; also sheet 3
Unconnected: IC801.8(B:O) IC803.1(A:O) IC803.10(C:O) IC803.13(D:O)

### Notes on the sheet
- ERR
- OK
- OK
- ERR
- ERR
- OK
- ERR
- OK

## Sheet 9 of 14: Notabschaltung Motor 1
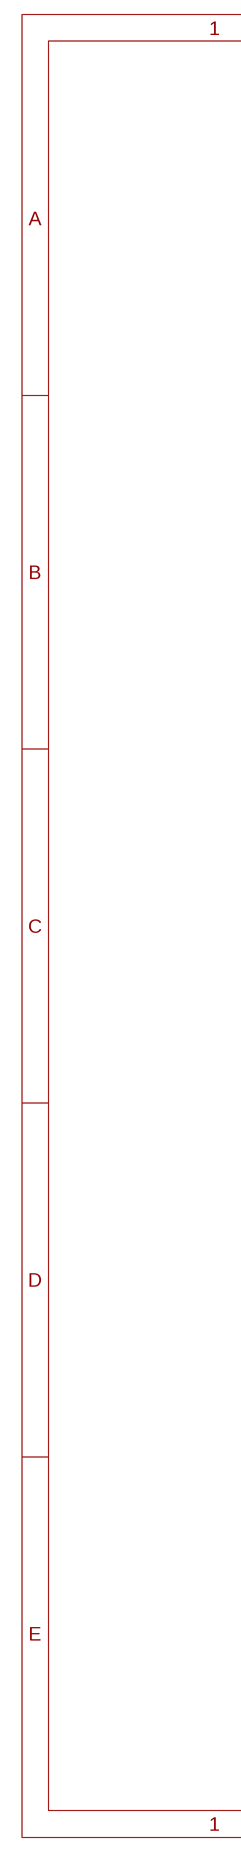
[diagram p13: schematic, sheet 9, part 1 of 2]
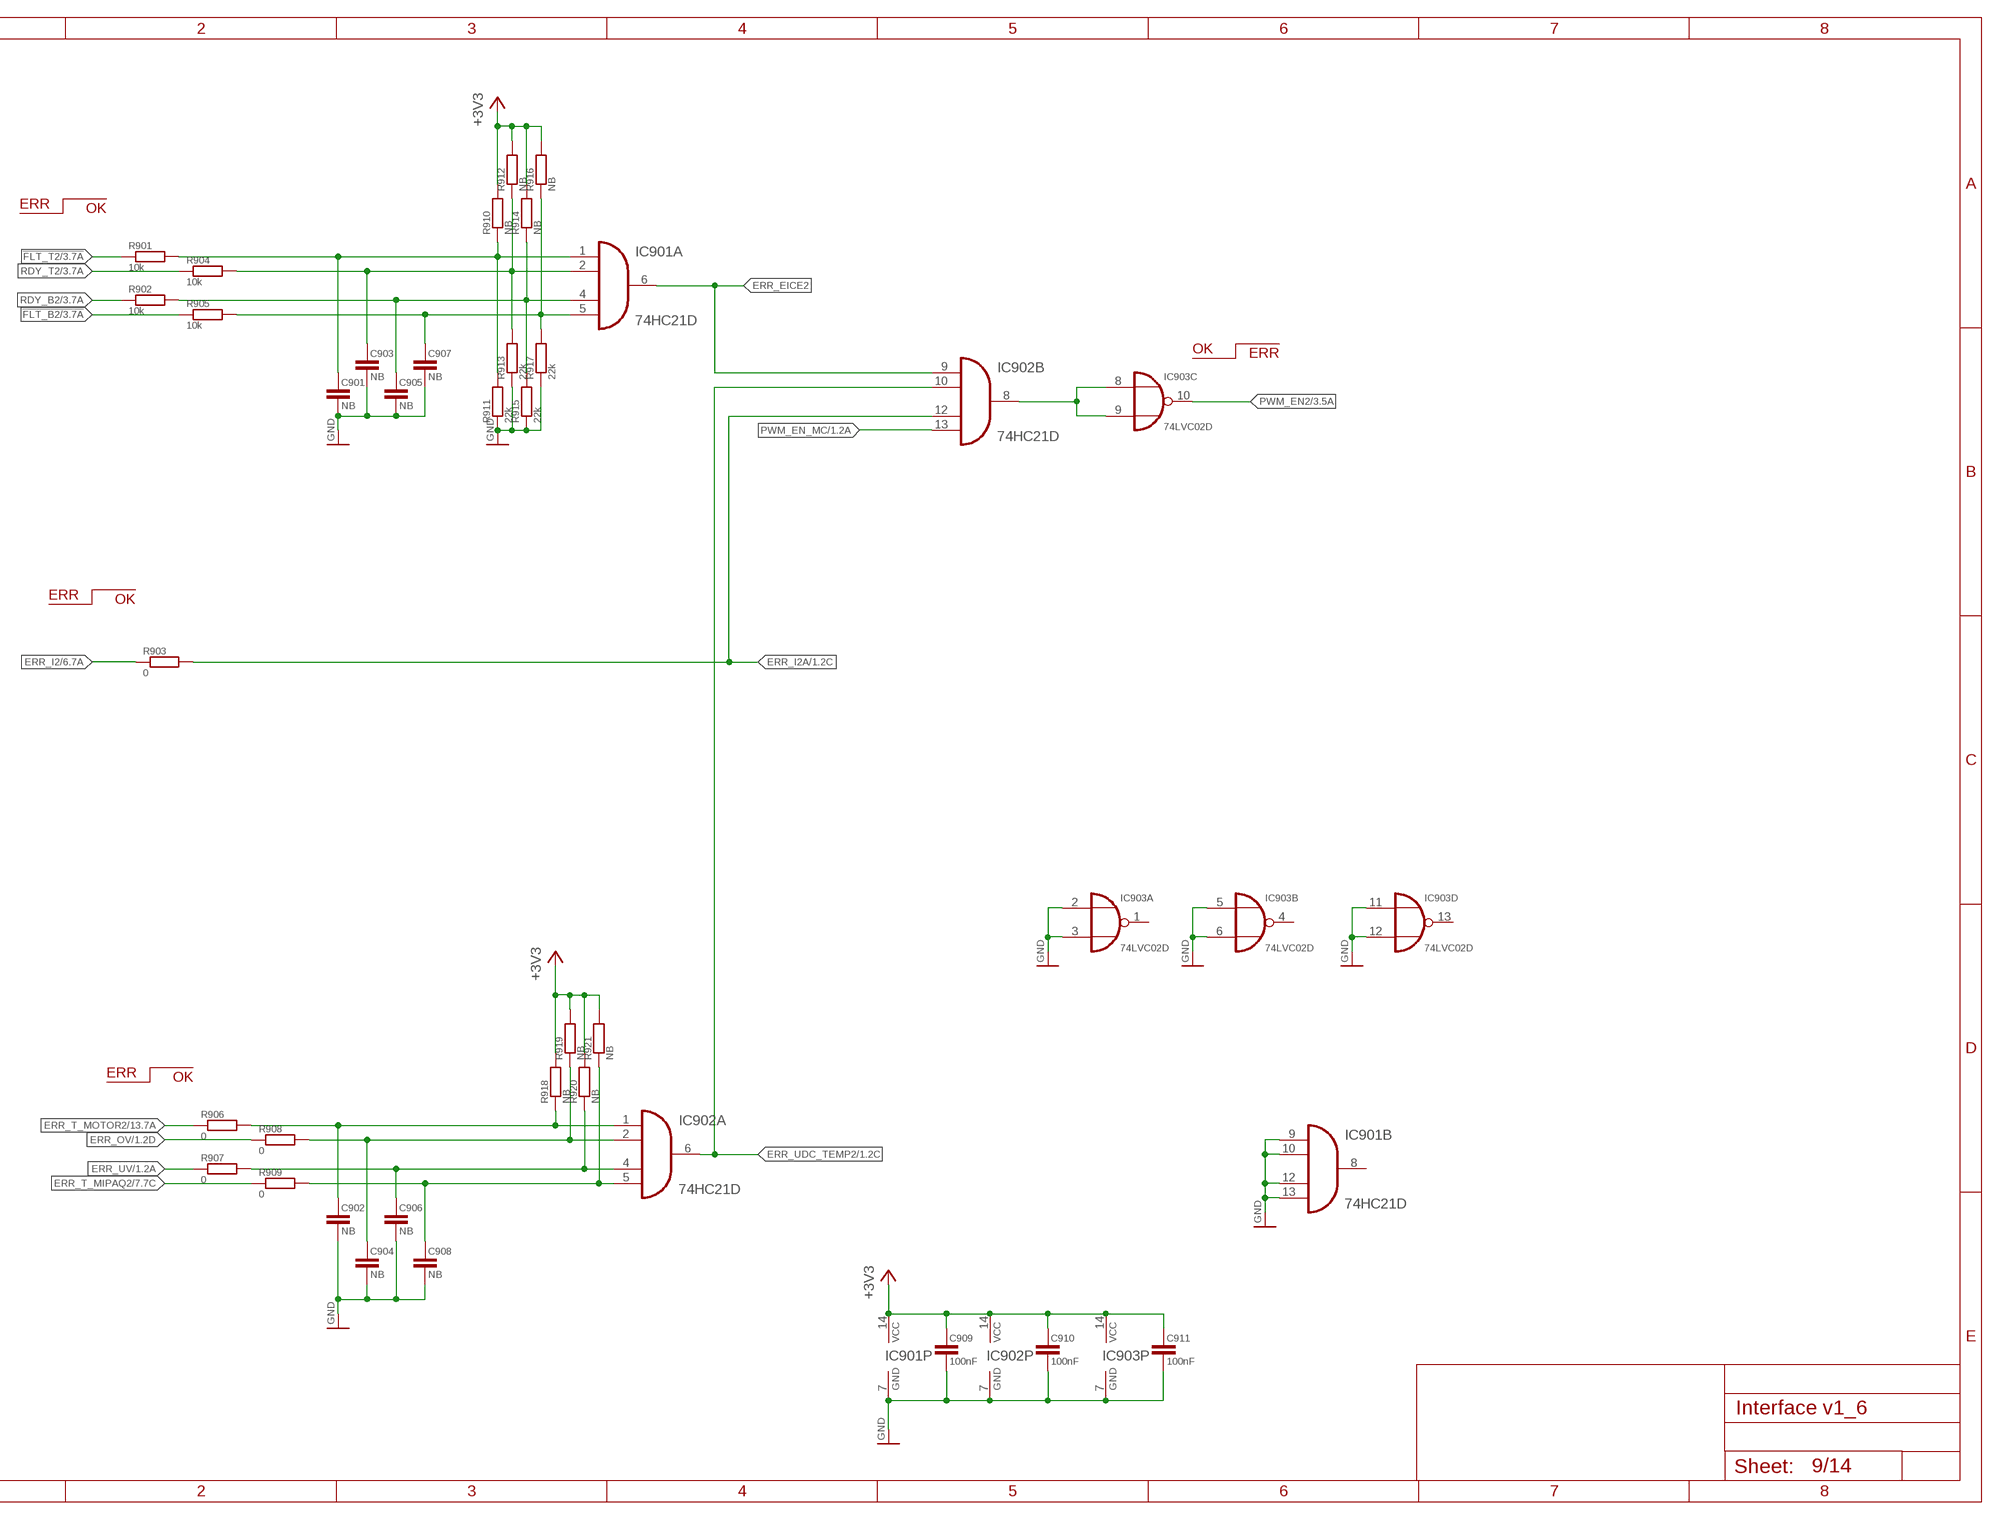
[diagram p14: schematic, sheet 9, part 2 of 2]

### Parts
C901  NB  C-0805"  [C-0805"]
C902  NB  C-0805"  [C-0805"]
C903  NB  C-0805"  [C-0805"]
C904  NB  C-0805"  [C-0805"]
C905  NB  C-0805"  [C-0805"]
C906  NB  C-0805"  [C-0805"]
C907  NB  C-0805"  [C-0805"]
C908  NB  C-0805"  [C-0805"]
C909  100nF  C-0805"  [C-0805"]
C910  100nF  C-0805"  [C-0805"]
C911  100nF  C-0805"  [C-0805"]
IC901  74HC21D  7421D  [SOIC14]
IC902  74HC21D  7421D  [SOIC14]
IC903  74LVC02D  7402D  [SOIC14]
R901  10k  R-0805"  [R-0805"]
R902  10k  R-0805"  [R-0805"]
R903  0  R-0805"  [R-0805"]
R904  10k  R-0805"  [R-0805"]
R905  10k  R-0805"  [R-0805"]
R906  0  R-0805"  [R-0805"]
R907  0  R-0805"  [R-0805"]
R908  0  R-0805"  [R-0805"]
R909  0  R-0805"  [R-0805"]
R910  NB  R-0805"  [R-0805"]
R911  22k  R-0805"  [R-0805"]
R912  NB  R-0805"  [R-0805"]
R913  22k  R-0805"  [R-0805"]
R914  NB  R-0805"  [R-0805"]
R915  22k  R-0805"  [R-0805"]
R916  NB  R-0805"  [R-0805"]
R917  22k  R-0805"  [R-0805"]
R918  NB  R-0805"  [R-0805"]
R919  NB  R-0805"  [R-0805"]
R920  NB  R-0805"  [R-0805"]
R921  NB  R-0805"  [R-0805"]

### Nets
!FLT_B2: R905.1 ; also sheet 3
!FLT_T2: R901.1 ; also sheet 3
+3V3 [VDD]: C909.1 C910.1 C911.1 IC901.14(P:VCC) IC902.14(P:VCC) IC903.14(P:VCC) R910.2 R912.2 R914.2 R916.2 R918.2 R919.2 R920.2 R921.2 ; also sheet 1,2,3,4,5,6,7,8,11,13
ERR_EICE2: IC901.6(A:O) IC902.9(B:I0)
ERR_I2: R903.1 ; also sheet 6
ERR_I2A: IC902.12(B:I2) R903.2 ; also sheet 1
ERR_OV: R908.1 ; also sheet 1,4,8
ERR_T_MIPAQ2: R909.1 ; also sheet 7
ERR_T_MOTOR2: R906.1 ; also sheet 13
ERR_UDC_TEMP2: IC902.6(A:O) IC902.10(B:I1) ; also sheet 1
ERR_UV: R907.1 ; also sheet 1,4,8
GND: C901.2 C902.2 C903.2 C904.2 C905.2 C906.2 C907.2 C908.2 C909.2 C910.2 C911.2 IC901.7(P:GND) IC901.9(B:I0) IC901.10(B:I1) IC901.12(B:I2) IC901.13(B:I3) IC902.7(P:GND) IC903.2(A:I0) IC903.3(A:I1) IC903.5(B:I0) IC903.6(B:I1) IC903.7(P:GND) IC903.11(D:I0) IC903.12(D:I1) R911.1 R913.1 R915.1 R917.1 ; also sheet 1,2,3,4,5,6,7,8,10,11,12,13,14
N$160: C901.1 IC901.1(A:I0) R901.2 R910.1 R911.2
N$161: C905.1 IC901.4(A:I2) R902.2 R914.1 R915.2
N$162: C907.1 IC901.5(A:I3) R905.2 R916.1 R917.2
N$167: C902.1 IC902.1(A:I0) R906.2 R918.1
N$168: C904.1 IC902.2(A:I1) R908.2 R919.1
N$169: C906.1 IC902.4(A:I2) R907.2 R920.1
N$170: C908.1 IC902.5(A:I3) R909.2 R921.1
N$174: C903.1 IC901.2(A:I1) R904.2 R912.1 R913.2
N$176: IC902.8(B:O) IC903.8(C:I0) IC903.9(C:I1)
PWM_EN2: IC903.10(C:O) ; also sheet 3
PWM_EN_MC: IC902.13(B:I3) ; also sheet 1,8
RDY_B2: R902.1 ; also sheet 3
RDY_T2: R904.1 ; also sheet 3
Unconnected: IC901.8(B:O) IC903.1(A:O) IC903.4(B:O) IC903.13(D:O)

### Notes on the sheet
- ERR
- OK
- OK
- ERR
- ERR
- OK
- ERR
- OK

## Sheet 10 of 14: Resolver M1
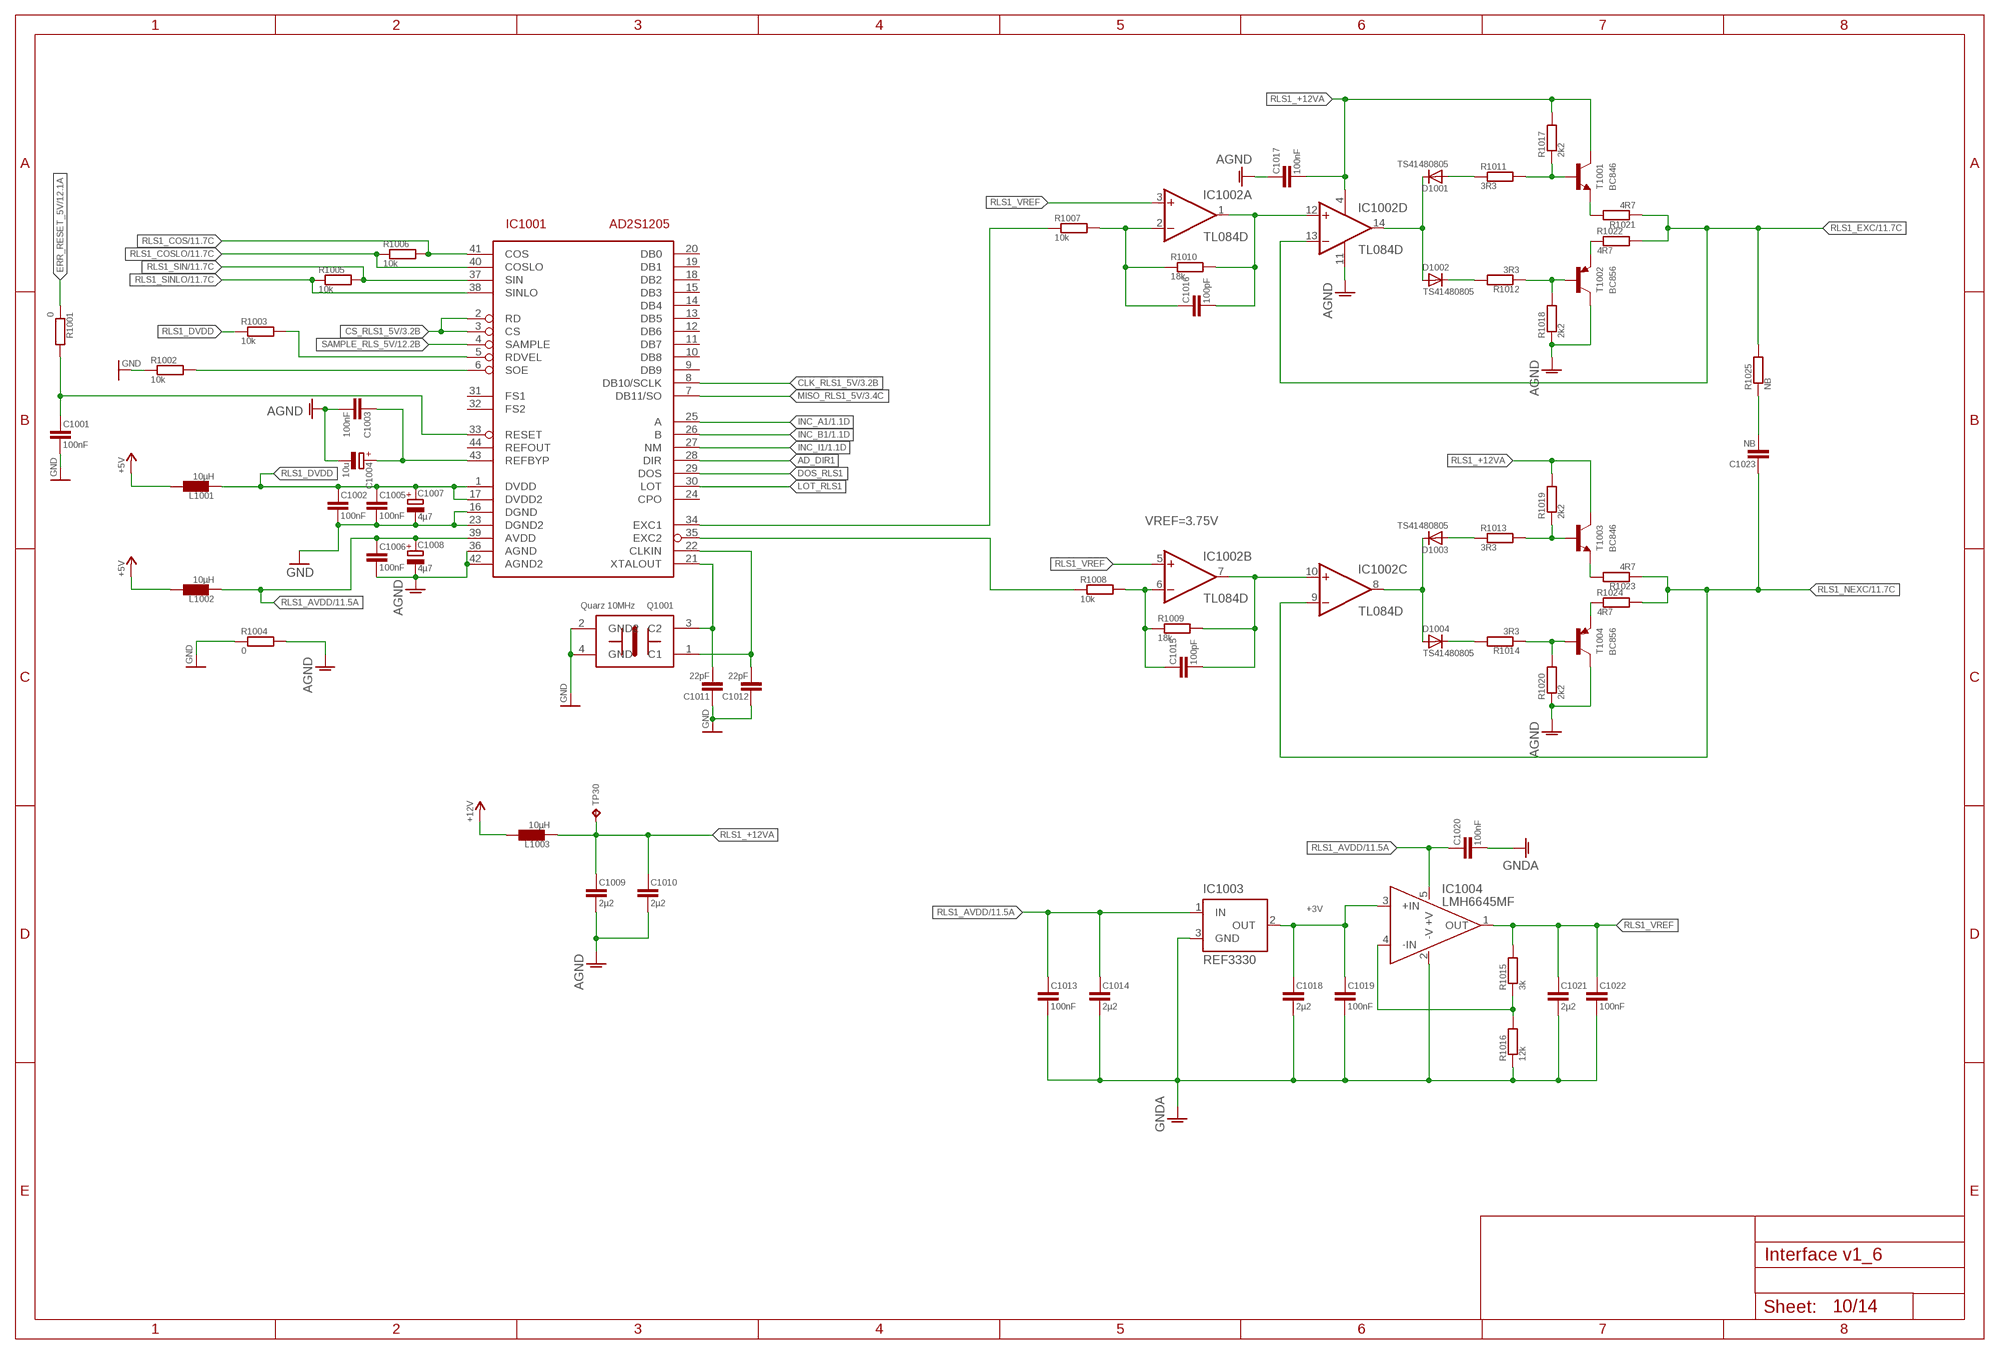
[diagram p15: schematic, sheet 10]

### Parts
C1001  100nF  C-0805"  [C-0805"]
C1002  100nF  C-0805"  [C-0805"]
C1003  100nF  C-0805"  [C-0805"]
C1004  10u  C-POL-1210"  [CP-1210"]
C1005  100nF  C-0805"  [C-0805"]
C1006  100nF  C-0805"  [C-0805"]
C1007  4µ7  C-POL-1206"  [CP-1206"]
C1008  4µ7  C-POL-1206"  [CP-1206"]
C1009  2µ2  C-0805"  [C-0805"]
C1010  2µ2  C-0805"  [C-0805"]
C1011  22pF  C-0805"  [C-0805"]
C1012  22pF  C-0805"  [C-0805"]
C1013  100nF  C-0805"  [C-0805"]
C1014  2µ2  C-0805"  [C-0805"]
C1015  100pF  C-0805"  [C-0805"]
C1016  100pF  C-0805"  [C-0805"]
C1017  100nF  C-0805"  [C-0805"]
C1018  2µ2  C-0805"  [C-0805"]
C1019  100nF  C-0805"  [C-0805"]
C1020  100nF  C-0805"  [C-0805"]
C1021  2µ2  C-0805"  [C-0805"]
C1022  100nF  C-0805"  [C-0805"]
C1023  NB  C-0805"  [C-0805"]
D1001  TS41480805  DIODE-0805"  [D-0805"]
D1002  TS41480805  DIODE-0805"  [D-0805"]
D1003  TS41480805  DIODE-0805"  [D-0805"]
D1004  TS41480805  DIODE-0805"  [D-0805"]
IC1001  AD2S1205  [TQFP44]
IC1002  TL084D  [SO14]
IC1003  REF3330  MAX6520  [SOT23]
IC1004  LMH6645MF  LMH6645  [SOT23-5]
L1001  10µH  L-1206  [L-1206]
L1002  10µH  L-1206  [L-1206]
L1003  10µH  L-1206  [L-1206]
Q1001  QUARZ10MHZ  [CRYSTAL3.2X5]
R1001  0  R-0805"  [R-0805"]
R1002  10k  R-0805"  [R-0805"]
R1003  10k  R-0805"  [R-0805"]
R1004  0  R-0805"  [R-0805"]
R1005  10k  R-0805"  [R-0805"]
R1006  10k  R-0805"  [R-0805"]
R1007  10k  R-0805"  [R-0805"]
R1008  10k  R-0805"  [R-0805"]
R1009  18k  R-0805"  [R-0805"]
R1010  18k  R-0805"  [R-0805"]
R1011  3R3  R-0805"  [R-0805"]
R1012  3R3  R-0805"  [R-0805"]
R1013  3R3  R-0805"  [R-0805"]
R1014  3R3  R-0805"  [R-0805"]
R1015  3k  R-0805"  [R-0805"]
R1016  12k  R-0805"  [R-0805"]
R1017  2k2  R-0805"  [R-0805"]
R1018  2k2  R-0805"  [R-0805"]
R1019  2k2  R-0805"  [R-0805"]
R1020  2k2  R-0805"  [R-0805"]
R1021  4R7  R-0805"  [R-0805"]
R1022  4R7  R-0805"  [R-0805"]
R1023  4R7  R-0805"  [R-0805"]
R1024  4R7  R-0805"  [R-0805"]
R1025  NB  R-0805"  [R-0805"]
T1001  BC846  [SOT23]
T1002  BC856  BC856BLT1-PNP-SOT23-BEC  [SOT23-BEC]
T1003  BC846  [SOT23]
T1004  BC856  BC856BLT1-PNP-SOT23-BEC  [SOT23-BEC]
TP30  TP-TH-08  [TP-08]

### Nets
+5V [VDD]: L1001.1 L1002.1 ; also sheet 1,2,3,4,5,6,7,12,13
+12V [VDD]: L1003.1 ; also sheet 2,4,12
AD_DIR1: IC1001.28(DIR)
CLK_RLS1_5V: IC1001.8(DB10/SCLK) ; also sheet 3
CS_RLS1_5V: IC1001.2(RD) IC1001.3(CS) ; also sheet 3
DOS_RLS1: IC1001.29(DOS)
ERR_RESET_5V: R1001.1 ; also sheet 3,12
ERR_RESET_RLS1: C1001.1 IC1001.33(RESET) R1001.2
GND: C1001.2 C1002.2 C1005.2 C1007.- C1011.1 C1012.1 IC1001.16(DGND) IC1001.23(DGND2) Q1001.2(GND2) Q1001.4(GND) R1002.1 R1004.1 ; also sheet 1,2,3,4,5,6,7,8,9,11,12,13,14
INC_A1: IC1001.25(A) ; also sheet 1
INC_B1: IC1001.26(B) ; also sheet 1
INC_I1: IC1001.27(NM) ; also sheet 1
LOT_RLS1: IC1001.30(LOT)
MISO_RLS1_5V: IC1001.7(DB11/SO) ; also sheet 3
N$35: C1016.1 IC1002.2(A:-IN) R1007.2 R1010.1
N$44: C1016.2 IC1002.1(A:OUT) IC1002.12(D:+IN) R1010.2
N$45: D1001.A R1011.1
N$48: D1001.C D1002.A IC1002.14(D:OUT)
N$49: D1002.C R1012.2
N$50: R1021.2 T1001.2(E)
N$51: R1022.1 T1002.E
N$131: C1015.1 IC1002.6(B:-IN) R1008.2 R1009.1
N$135: C1015.2 IC1002.7(B:OUT) IC1002.10(C:+IN) R1009.2
N$137: IC1001.34(EXC1) R1007.1
N$141: IC1001.35(EXC2) R1008.1
N$179: C1011.2 IC1001.21(XTALOUT) Q1001.3(C2)
N$180: C1012.2 IC1001.22(CLKIN) Q1001.1(C1)
N$181: R1012.1 R1018.2 T1002.B
N$182: R1011.2 R1017.1 T1001.1(B)
N$183: D1003.A R1013.1
N$185: D1003.C D1004.A IC1002.8(C:OUT)
N$186: D1004.C R1014.2
N$187: R1023.2 T1003.2(E)
N$188: R1024.1 T1004.E
N$189: R1014.1 R1020.2 T1004.B
N$190: R1013.2 R1019.1 T1003.1(B)
N$191: C1023.2 R1025.1
N$192: C1003.1 C1004.+ IC1001.43(REFBYP)
N$193: IC1001.6(SOE) R1002.2
N$194: IC1001.5(RDVEL) R1003.2
N$195: C1018.1 C1019.1 IC1003.2(OUT) IC1004.3(+IN)
N$196: IC1004.4(-IN) R1015.1 R1016.2
RLS1_+12VA: C1009.1 C1010.1 C1017.2 IC1002.4(P:V+) L1003.2 R1017.2 R1019.2 T1001.3(C) T1003.3(C) TP30.TP
RLS1_AGND_RES: C1003.2 C1004.- C1006.2 C1008.- C1009.2 C1010.2 C1013.2 C1014.2 C1017.1 C1018.2 C1019.2 C1020.2 C1021.2 C1022.2 IC1001.36(AGND) IC1001.42(AGND2) IC1002.11(P:V-) IC1003.3(GND) IC1004.2(-V) R1004.2 R1016.1 R1018.1 R1020.1 T1002.C T1004.C ; supply symbol labelled AGND, GNDA ; also sheet 11
RLS1_AVDD: C1006.1 C1008.+ C1013.1 C1014.1 C1020.1 IC1001.39(AVDD) IC1003.1(IN) IC1004.5(+V) L1002.2 ; also sheet 11
RLS1_COS: IC1001.41(COS) R1006.2 ; also sheet 11
RLS1_COSLO: IC1001.40(COSLO) R1006.1 ; also sheet 11
RLS1_DVDD: C1002.1 C1005.1 C1007.+ IC1001.1(DVDD) IC1001.17(DVDD2) L1001.2 R1003.1
RLS1_EXC: IC1002.13(D:-IN) R1021.1 R1022.2 R1025.2 ; also sheet 11
RLS1_NEXC: C1023.1 IC1002.9(C:-IN) R1023.1 R1024.2 ; also sheet 11
RLS1_SIN: IC1001.37(SIN) R1005.2 ; also sheet 11
RLS1_SINLO: IC1001.38(SINLO) R1005.1 ; also sheet 11
RLS1_VREF: C1021.1 C1022.1 IC1002.3(A:+IN) IC1002.5(B:+IN) IC1004.1(OUT) R1015.2
SAMPLE_RLS_5V: IC1001.4(SAMPLE) ; also sheet 3,12
Unconnected: IC1001.9(DB9) IC1001.10(DB8) IC1001.11(DB7) IC1001.12(DB6) IC1001.13(DB5) IC1001.14(DB4) IC1001.15(DB3) IC1001.18(DB2) IC1001.19(DB1) IC1001.20(DB0) IC1001.24(CPO) IC1001.31(FS1) IC1001.32(FS2) IC1001.44(REFOUT)

### Notes on the sheet
- VREF=3.75V
- +3V

## Sheet 11 of 14: TempMotor 1
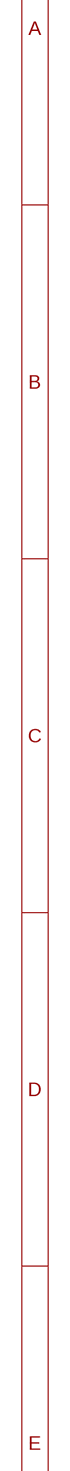
[diagram p16: schematic, sheet 11, part 1 of 2]
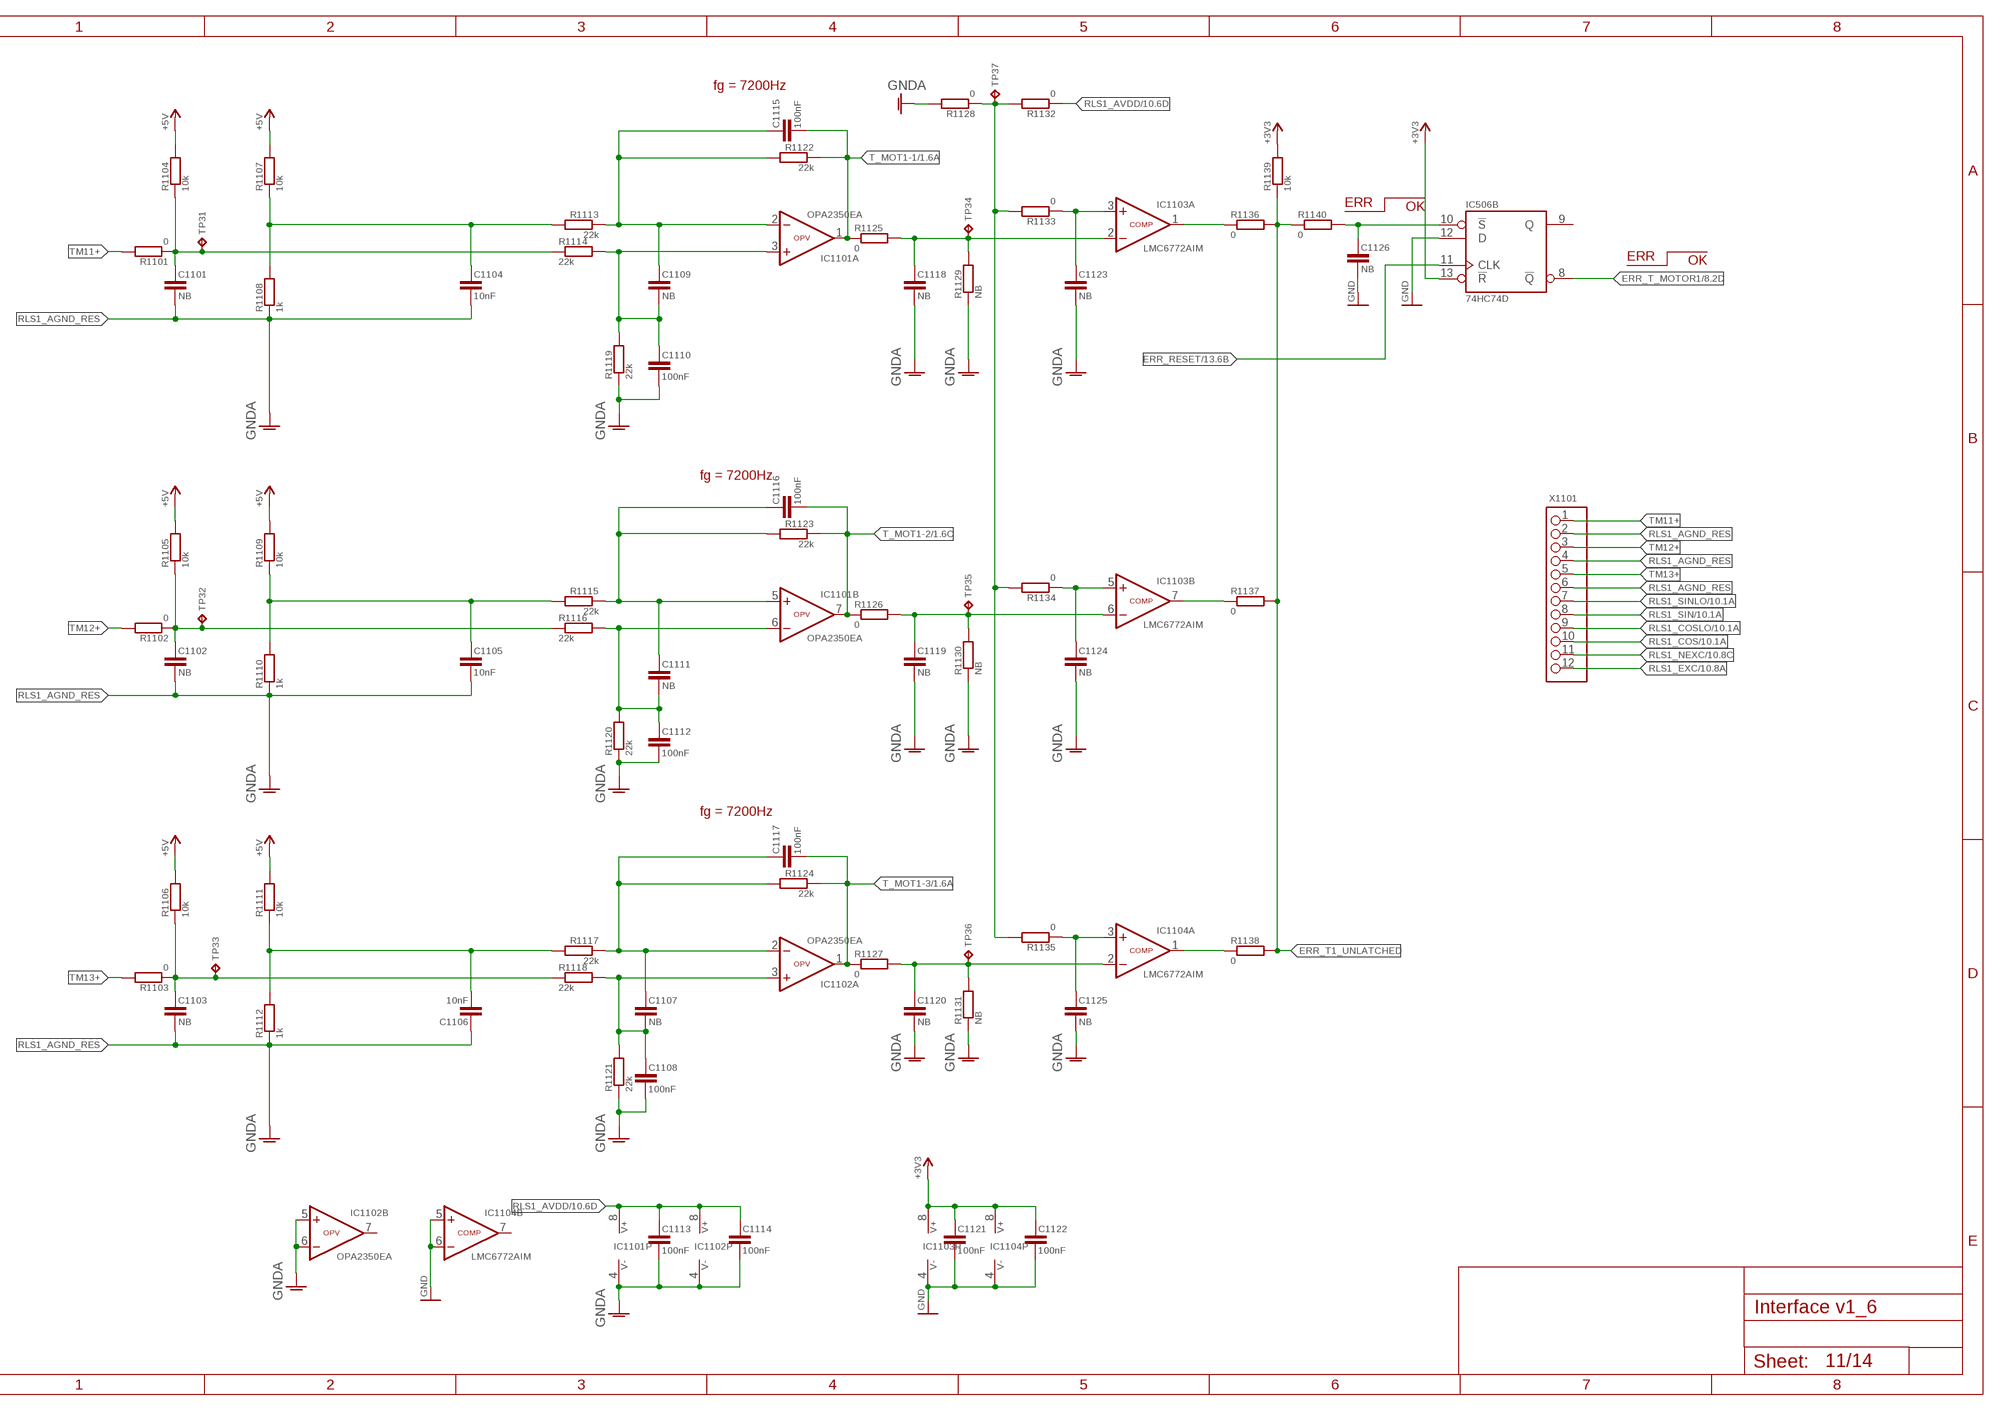
[diagram p17: schematic, sheet 11, part 2 of 2]

### Parts
C1101  NB  C-0805"  [C-0805"]
C1102  NB  C-0805"  [C-0805"]
C1103  NB  C-0805"  [C-0805"]
C1104  10nF  C-0805"  [C-0805"]
C1105  10nF  C-0805"  [C-0805"]
C1106  10nF  C-0805"  [C-0805"]
C1107  NB  C-0805"  [C-0805"]
C1108  100nF  C-0805"  [C-0805"]
C1109  NB  C-0805"  [C-0805"]
C1110  100nF  C-0805"  [C-0805"]
C1111  NB  C-0805"  [C-0805"]
C1112  100nF  C-0805"  [C-0805"]
C1113  100nF  C-0805"  [C-0805"]
C1114  100nF  C-0805"  [C-0805"]
C1115  100nF  C-0805"  [C-0805"]
C1116  100nF  C-0805"  [C-0805"]
C1117  100nF  C-0805"  [C-0805"]
C1118  NB  C-0805"  [C-0805"]
C1119  NB  C-0805"  [C-0805"]
C1120  NB  C-0805"  [C-0805"]
C1121  100nF  C-0805"  [C-0805"]
C1122  100nF  C-0805"  [C-0805"]
C1123  NB  C-0805"  [C-0805"]
C1124  NB  C-0805"  [C-0805"]
C1125  NB  C-0805"  [C-0805"]
C1126  NB  C-0805"  [C-0805"]
IC1101  OPA2350EA  OPV-2-SOIC  [SOIC8]
IC1102  OPA2350EA  OPV-2-SOIC  [SOIC8]
IC1103  LMC6772AIM  COMP-OC-2-SOIC  [SOIC8]
IC1104  LMC6772AIM  COMP-OC-2-SOIC  [SOIC8]
R1101  0  R-0805"  [R-0805"]
R1102  0  R-0805"  [R-0805"]
R1103  0  R-0805"  [R-0805"]
R1104  10k  R-0805"  [R-0805"]
R1105  10k  R-0805"  [R-0805"]
R1106  10k  R-0805"  [R-0805"]
R1107  10k  R-0805"  [R-0805"]
R1108  1k  R-0805"  [R-0805"]
R1109  10k  R-0805"  [R-0805"]
R1110  1k  R-0805"  [R-0805"]
R1111  10k  R-0805"  [R-0805"]
R1112  1k  R-0805"  [R-0805"]
R1113  22k  R-0805"  [R-0805"]
R1114  22k  R-0805"  [R-0805"]
R1115  22k  R-0805"  [R-0805"]
R1116  22k  R-0805"  [R-0805"]
R1117  22k  R-0805"  [R-0805"]
R1118  22k  R-0805"  [R-0805"]
R1119  22k  R-0805"  [R-0805"]
R1120  22k  R-0805"  [R-0805"]
R1121  22k  R-0805"  [R-0805"]
R1122  22k  R-0805"  [R-0805"]
R1123  22k  R-0805"  [R-0805"]
R1124  22k  R-0805"  [R-0805"]
R1125  0  R-0805"  [R-0805"]
R1126  0  R-0805"  [R-0805"]
R1127  0  R-0805"  [R-0805"]
R1128  0  R-0805"  [R-0805"]
R1129  NB  R-0805"  [R-0805"]
R1130  NB  R-0805"  [R-0805"]
R1131  NB  R-0805"  [R-0805"]
R1132  0  R-0805"  [R-0805"]
R1133  0  R-0805"  [R-0805"]
R1134  0  R-0805"  [R-0805"]
R1135  0  R-0805"  [R-0805"]
R1136  0  R-0805"  [R-0805"]
R1137  0  R-0805"  [R-0805"]
R1138  0  R-0805"  [R-0805"]
R1139  10k  R-0805"  [R-0805"]
R1140  0  R-0805"  [R-0805"]
TP31  TP-TH-08  [TP-08]
TP32  TP-TH-08  [TP-08]
TP33  TP-TH-08  [TP-08]
TP34  TP-TH-08  [TP-08]
TP35  TP-TH-08  [TP-08]
TP36  TP-TH-08  [TP-08]
TP37  TP-TH-08  [TP-08]
X1101  MINIBRIDGE12-GERADE  [MINIBRIDGE12-GERADE]

### Nets
+3V3 [VDD]: C1121.1 C1122.1 IC506.13(B:!R) IC1103.8(P:V+) IC1104.8(P:V+) R1139.2 ; also sheet 1,2,3,4,5,6,7,8,9,13
ERR_RESET: IC506.11(B:CLK) ; also sheet 1,3,4,5,6,7,13
ERR_T1_UNLATCHED: R1136.2 R1137.2 R1138.2 R1139.1 R1140.1
ERR_T_MOTOR1: IC506.8(B:!Q) ; also sheet 8
GND: C1121.2 C1122.2 C1126.2 IC506.12(B:D) IC1103.4(P:V-) IC1104.4(P:V-) IC1104.5(B:+IN) IC1104.6(B:-IN) ; also sheet 1,2,3,4,5,6,7,8,9,10,12,13,14
N$31: IC1103.1(A:OUT) R1136.1
N$33: C1104.1 R1107.1 R1108.2 R1113.2
N$39: C1105.1 R1109.1 R1110.2 R1115.2
N$46: C1106.2 R1111.1 R1112.2 R1117.2
N$52: IC1103.7(B:OUT) R1137.1
N$56: IC1104.1(A:OUT) R1138.1
N$57: C1102.1 R1102.1 R1105.1 R1116.1 TP32.TP
N$60: C1101.1 R1101.1 R1104.1 R1114.1 TP31.TP
N$69: C1109.1 C1115.1 IC1101.2(A:-IN) R1113.1 R1122.2
N$70: C1109.2 C1110.1 IC1101.3(A:+IN) R1114.2 R1119.2
N$75: C1111.2 C1112.1 IC1101.6(B:-IN) R1116.2 R1120.2
N$77: C1103.1 R1103.1 R1106.1 R1118.1 TP33.TP
N$81: C1107.1 C1117.1 IC1102.2(A:-IN) R1117.1 R1124.2
N$82: C1107.2 C1108.1 IC1102.3(A:+IN) R1118.2 R1121.2
N$84: C1111.1 C1116.1 IC1101.5(B:+IN) R1115.1 R1123.2
N$88: C1126.1 IC506.10(B:!S) R1140.2
N$171: C1123.1 IC1103.3(A:+IN) R1133.1
N$172: C1124.1 IC1103.5(B:+IN) R1134.1
N$173: C1125.1 IC1104.3(A:+IN) R1135.1
RLS1_AGND_RES: C1101.2 C1102.2 C1103.2 C1104.2 C1105.2 C1106.1 C1108.2 C1110.2 C1112.2 C1113.2 C1114.2 C1118.2 C1119.2 C1120.2 C1123.2 C1124.2 C1125.2 IC1101.4(P:V-) IC1102.4(P:V-) IC1102.5(B:+IN) IC1102.6(B:-IN) R1108.1 R1110.1 R1112.1 R1119.1 R1120.1 R1121.1 R1128.2 R1129.1 R1130.1 R1131.1 X1101.2 X1101.4 X1101.6 ; supply symbol labelled GNDA ; also sheet 10
RLS1_AVDD: C1113.1 C1114.1 IC1101.8(P:V+) IC1102.8(P:V+) R1104.2 R1105.2 R1106.2 R1107.2 R1109.2 R1111.2 R1132.1 ; supply symbol labelled +5V ; also sheet 10
RLS1_COS: X1101.10 ; also sheet 10
RLS1_COSLO: X1101.9 ; also sheet 10
RLS1_EXC: X1101.12 ; also sheet 10
RLS1_NEXC: X1101.11 ; also sheet 10
RLS1_SIN: X1101.8 ; also sheet 10
RLS1_SINLO: X1101.7 ; also sheet 10
T_M1-1_A: C1118.1 IC1103.2(A:-IN) R1125.2 R1129.2 TP34.TP
T_M1-2_A: C1119.1 IC1103.6(B:-IN) R1126.2 R1130.2 TP35.TP
T_M1-3_A: C1120.1 IC1104.2(A:-IN) R1127.2 R1131.2 TP36.TP
T_MOT1-1: C1115.2 IC1101.1(A:OUT) R1122.1 R1125.1 ; also sheet 1
T_MOT1-2: C1116.2 IC1101.7(B:OUT) R1123.1 R1126.1 ; also sheet 1
T_MOT1-3: C1117.2 IC1102.1(A:OUT) R1124.1 R1127.1 ; also sheet 1
TEMP_MAX: R1128.1 R1132.2 R1133.2 R1134.2 R1135.2 TP37.TP
TM11+: R1101.2 X1101.1
TM12+: R1102.2 X1101.3
TM13+: R1103.2 X1101.5
Unconnected: IC506.9(B:Q) IC1102.7(B:OUT) IC1104.7(B:OUT)

### Notes on the sheet
- fg = 7200Hz
- ERR
- OK
- ERR
- OK
- fg = 7200Hz
- fg = 7200Hz

## Sheet 12 of 14: Resolver M2
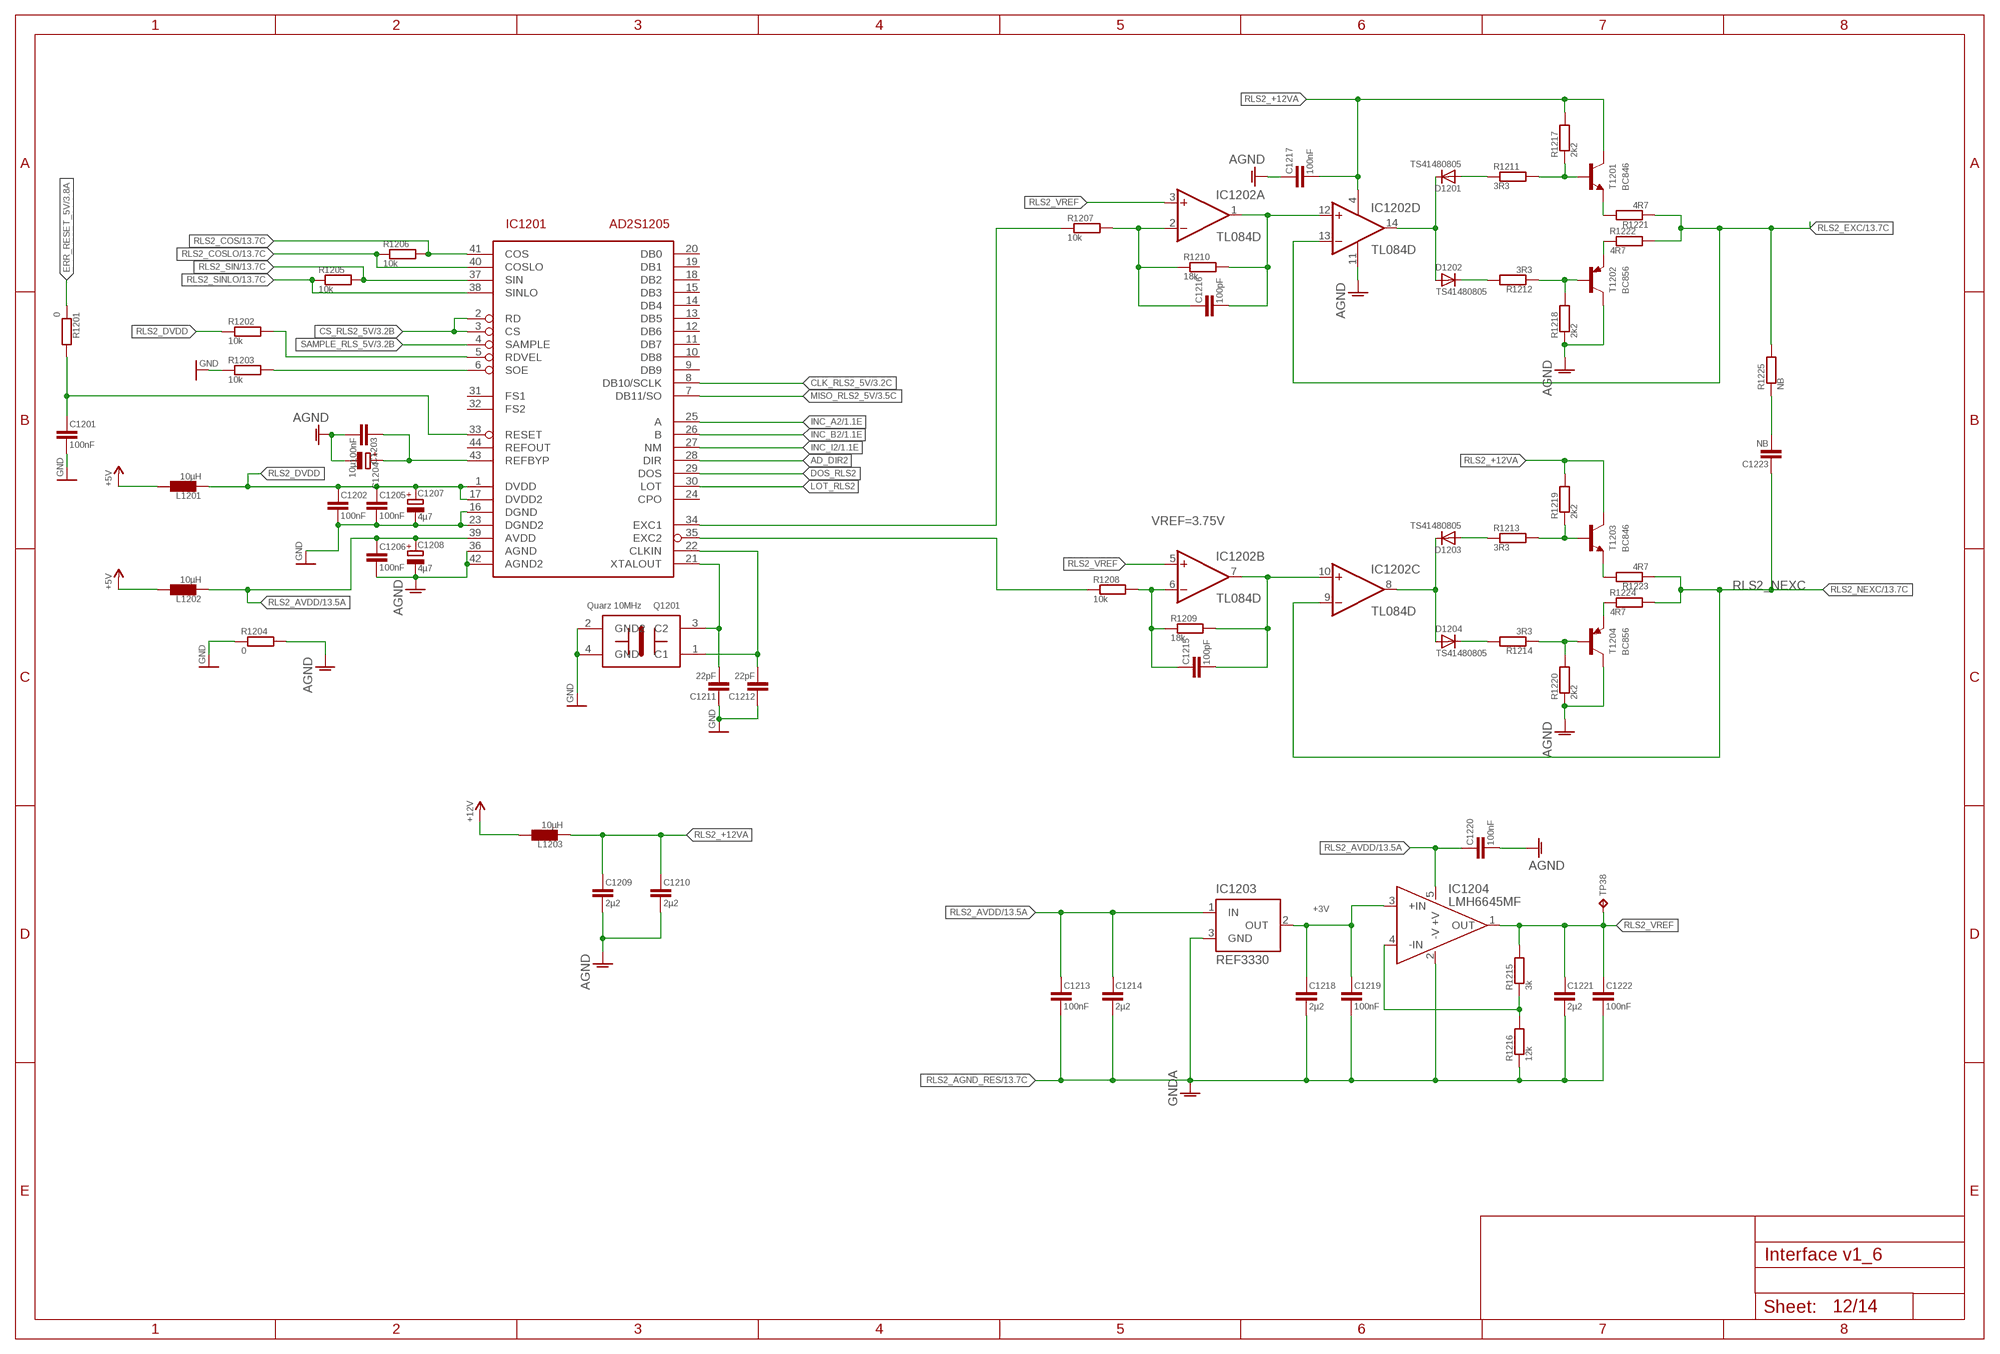
[diagram p18: schematic, sheet 12]

### Parts
C1201  100nF  C-0805"  [C-0805"]
C1202  100nF  C-0805"  [C-0805"]
C1203  100nF  C-0805"  [C-0805"]
C1204  10µ  C-POL-1210"  [CP-1210"]
C1205  100nF  C-0805"  [C-0805"]
C1206  100nF  C-0805"  [C-0805"]
C1207  4µ7  C-POL-1206"  [CP-1206"]
C1208  4µ7  C-POL-1206"  [CP-1206"]
C1209  2µ2  C-0805"  [C-0805"]
C1210  2µ2  C-0805"  [C-0805"]
C1211  22pF  C-0805"  [C-0805"]
C1212  22pF  C-0805"  [C-0805"]
C1213  100nF  C-0805"  [C-0805"]
C1214  2µ2  C-0805"  [C-0805"]
C1215  100pF  C-0805"  [C-0805"]
C1216  100pF  C-0805"  [C-0805"]
C1217  100nF  C-0805"  [C-0805"]
C1218  2µ2  C-0805"  [C-0805"]
C1219  100nF  C-0805"  [C-0805"]
C1220  100nF  C-0805"  [C-0805"]
C1221  2µ2  C-0805"  [C-0805"]
C1222  100nF  C-0805"  [C-0805"]
C1223  NB  C-0805"  [C-0805"]
D1201  TS41480805  DIODE-0805"  [D-0805"]
D1202  TS41480805  DIODE-0805"  [D-0805"]
D1203  TS41480805  DIODE-0805"  [D-0805"]
D1204  TS41480805  DIODE-0805"  [D-0805"]
IC1201  AD2S1205  [TQFP44]
IC1202  TL084D  [SO14]
IC1203  REF3330  MAX6520  [SOT23]
IC1204  LMH6645MF  LMH6645  [SOT23-5]
L1201  10µH  L-1206  [L-1206]
L1202  10µH  L-1206  [L-1206]
L1203  10µH  L-1206  [L-1206]
Q1201  QUARZ10MHZ  [CRYSTAL3.2X5]
R1201  0  R-0805"  [R-0805"]
R1202  10k  R-0805"  [R-0805"]
R1203  10k  R-0805"  [R-0805"]
R1204  0  R-0805"  [R-0805"]
R1205  10k  R-0805"  [R-0805"]
R1206  10k  R-0805"  [R-0805"]
R1207  10k  R-0805"  [R-0805"]
R1208  10k  R-0805"  [R-0805"]
R1209  18k  R-0805"  [R-0805"]
R1210  18k  R-0805"  [R-0805"]
R1211  3R3  R-0805"  [R-0805"]
R1212  3R3  R-0805"  [R-0805"]
R1213  3R3  R-0805"  [R-0805"]
R1214  3R3  R-0805"  [R-0805"]
R1215  3k  R-0805"  [R-0805"]
R1216  12k  R-0805"  [R-0805"]
R1217  2k2  R-0805"  [R-0805"]
R1218  2k2  R-0805"  [R-0805"]
R1219  2k2  R-0805"  [R-0805"]
R1220  2k2  R-0805"  [R-0805"]
R1221  4R7  R-0805"  [R-0805"]
R1222  4R7  R-0805"  [R-0805"]
R1223  4R7  R-0805"  [R-0805"]
R1224  4R7  R-0805"  [R-0805"]
R1225  NB  R-0805"  [R-0805"]
T1201  BC846  [SOT23]
T1202  BC856  BC856BLT1-PNP-SOT23-BEC  [SOT23-BEC]
T1203  BC846  [SOT23]
T1204  BC856  BC856BLT1-PNP-SOT23-BEC  [SOT23-BEC]
TP38  TP-TH-08  [TP-08]

### Nets
+5V [VDD]: L1201.1 L1202.1 ; also sheet 1,2,3,4,5,6,7,10,13
+12V [VDD]: L1203.1 ; also sheet 2,4,10
AD_DIR2: IC1201.28(DIR)
CLK_RLS2_5V: IC1201.8(DB10/SCLK) ; also sheet 3
CS_RLS2_5V: IC1201.2(RD) IC1201.3(CS) ; also sheet 3
DOS_RLS2: IC1201.29(DOS)
ERR_RESET_5V: R1201.1 ; also sheet 3,10
ERR_RESET_RLS2: C1201.1 IC1201.33(RESET) R1201.2
GND: C1201.2 C1202.2 C1205.2 C1207.- C1211.1 C1212.1 IC1201.16(DGND) IC1201.23(DGND2) Q1201.2(GND2) Q1201.4(GND) R1203.1 R1204.1 ; also sheet 1,2,3,4,5,6,7,8,9,10,11,13,14
INC_A2: IC1201.25(A) ; also sheet 1
INC_B2: IC1201.26(B) ; also sheet 1
INC_I2: IC1201.27(NM) ; also sheet 1
LOT_RLS2: IC1201.30(LOT)
MISO_RLS2_5V: IC1201.7(DB11/SO) ; also sheet 3
N$197: C1216.1 IC1202.2(A:-IN) R1207.2 R1210.1
N$199: C1216.2 IC1202.1(A:OUT) IC1202.12(D:+IN) R1210.2
N$200: D1201.A R1211.1
N$204: D1201.C D1202.A IC1202.14(D:OUT)
N$205: D1202.C R1212.2
N$206: R1221.2 T1201.2(E)
N$207: R1222.1 T1202.E
N$208: C1215.1 IC1202.6(B:-IN) R1208.2 R1209.1
N$209: C1215.2 IC1202.7(B:OUT) IC1202.10(C:+IN) R1209.2
N$210: IC1201.34(EXC1) R1207.1
N$211: IC1201.35(EXC2) R1208.1
N$212: C1211.2 IC1201.21(XTALOUT) Q1201.3(C2)
N$213: C1212.2 IC1201.22(CLKIN) Q1201.1(C1)
N$214: R1212.1 R1218.2 T1202.B
N$215: R1211.2 R1217.1 T1201.1(B)
N$216: D1203.A R1213.1
N$217: D1203.C D1204.A IC1202.8(C:OUT)
N$218: D1204.C R1214.2
N$219: R1223.2 T1203.2(E)
N$220: R1224.1 T1204.E
N$221: R1214.1 R1220.2 T1204.B
N$222: R1213.2 R1219.1 T1203.1(B)
N$223: C1223.2 R1225.1
N$224: C1203.1 C1204.+ IC1201.43(REFBYP)
N$225: IC1201.6(SOE) R1203.2
N$226: IC1201.5(RDVEL) R1202.2
N$227: C1218.1 C1219.1 IC1203.2(OUT) IC1204.3(+IN)
N$228: IC1204.4(-IN) R1215.1 R1216.2
RLS2_+12VA: C1209.1 C1210.1 C1217.2 IC1202.4(P:V+) L1203.2 R1217.2 R1219.2 T1201.3(C) T1203.3(C)
RLS2_AGND_RES: C1203.2 C1204.- C1206.2 C1208.- C1209.2 C1210.2 C1213.2 C1214.2 C1217.1 C1218.2 C1219.2 C1220.2 C1221.2 C1222.2 IC1201.36(AGND) IC1201.42(AGND2) IC1202.11(P:V-) IC1203.3(GND) IC1204.2(-V) R1204.2 R1216.1 R1218.1 R1220.1 T1202.C T1204.C ; supply symbol labelled AGND, GNDA ; also sheet 13
RLS2_AVDD: C1206.1 C1208.+ C1213.1 C1214.1 C1220.1 IC1201.39(AVDD) IC1203.1(IN) IC1204.5(+V) L1202.2 ; also sheet 13
RLS2_COS: IC1201.41(COS) R1206.2 ; also sheet 13
RLS2_COSLO: IC1201.40(COSLO) R1206.1 ; also sheet 13
RLS2_DVDD: C1202.1 C1205.1 C1207.+ IC1201.1(DVDD) IC1201.17(DVDD2) L1201.2 R1202.1
RLS2_EXC: IC1202.13(D:-IN) R1221.1 R1222.2 R1225.2 ; also sheet 13
RLS2_NEXC: C1223.1 IC1202.9(C:-IN) R1223.1 R1224.2 ; also sheet 13
RLS2_SIN: IC1201.37(SIN) R1205.2 ; also sheet 13
RLS2_SINLO: IC1201.38(SINLO) R1205.1 ; also sheet 13
RLS2_VREF: C1221.1 C1222.1 IC1202.3(A:+IN) IC1202.5(B:+IN) IC1204.1(OUT) R1215.2 TP38.TP
SAMPLE_RLS_5V: IC1201.4(SAMPLE) ; also sheet 3,10
Unconnected: IC1201.9(DB9) IC1201.10(DB8) IC1201.11(DB7) IC1201.12(DB6) IC1201.13(DB5) IC1201.14(DB4) IC1201.15(DB3) IC1201.18(DB2) IC1201.19(DB1) IC1201.20(DB0) IC1201.24(CPO) IC1201.31(FS1) IC1201.32(FS2) IC1201.44(REFOUT)

### Notes on the sheet
- VREF=3.75V
- +3V